# EasyEDA Pro project ProProject_Suzuran_Dev_Board_2023-10-31.epro

# Schematic Schematic1

## Sheets
1 P1: Create Date: 2023-10-07; Company: 嘉立创EDA; Page Size: A4; Version: V1.0
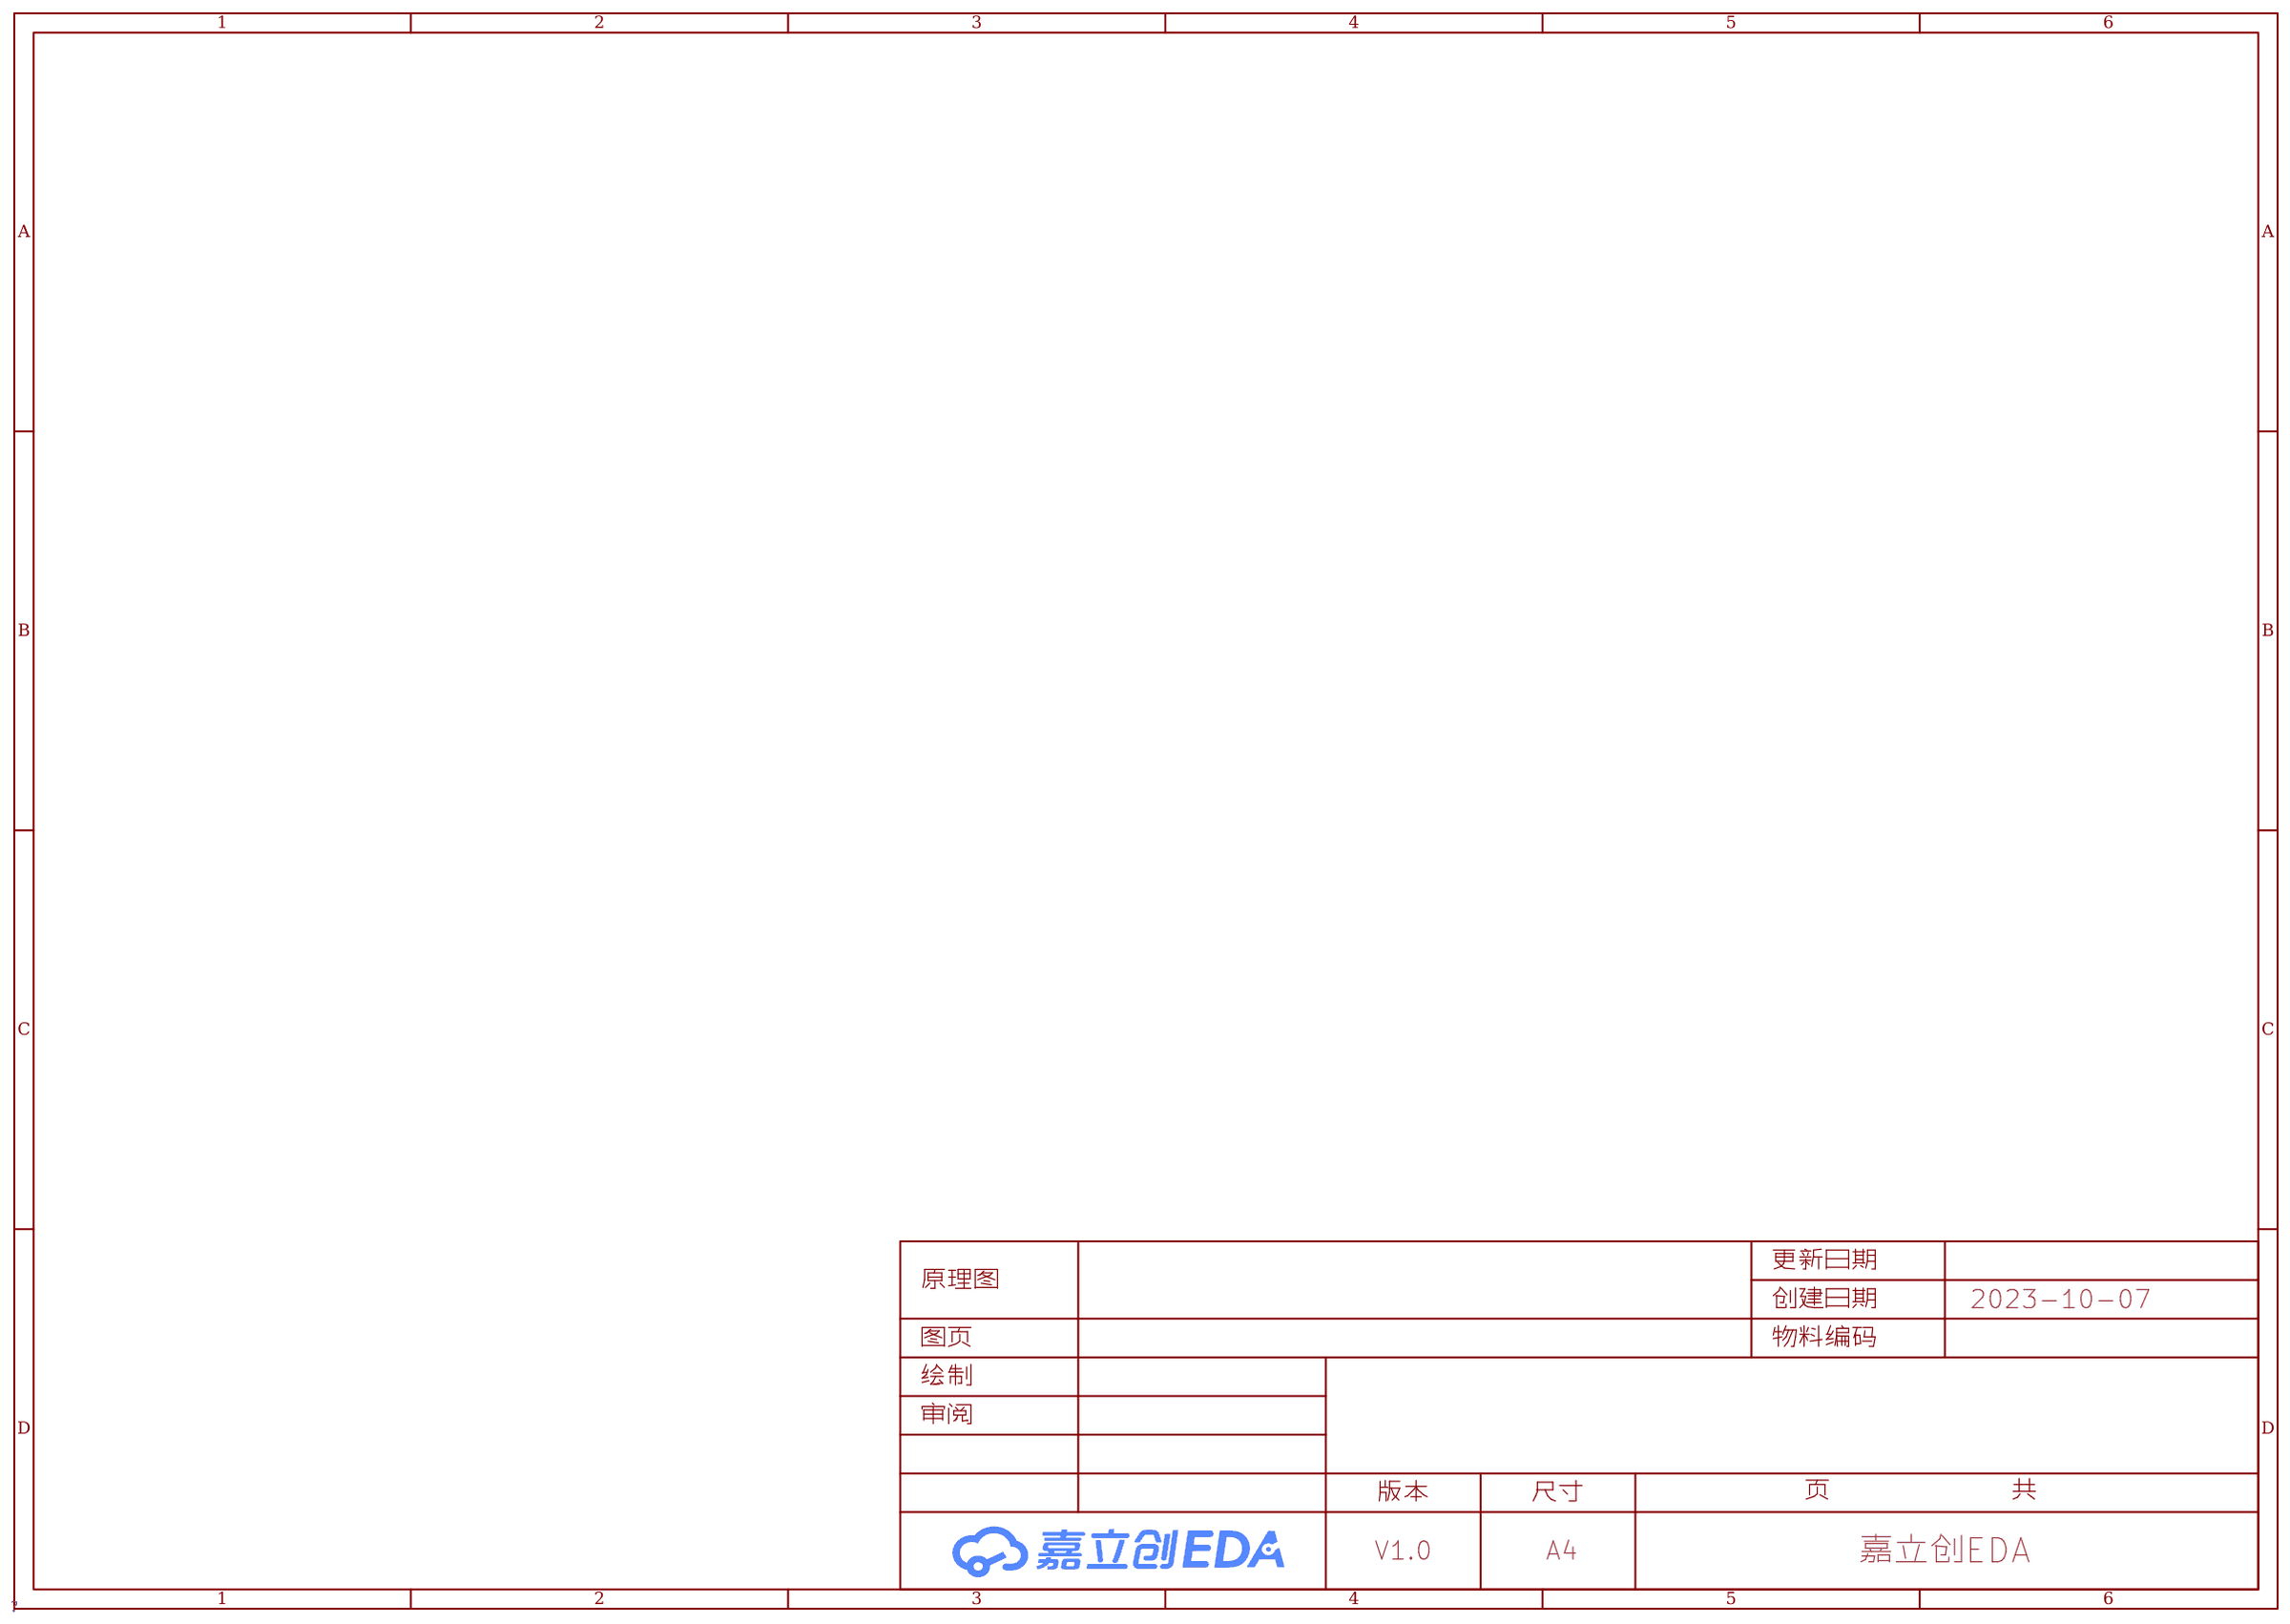
[diagram p0: P1]
2 Sheet.SchDoc
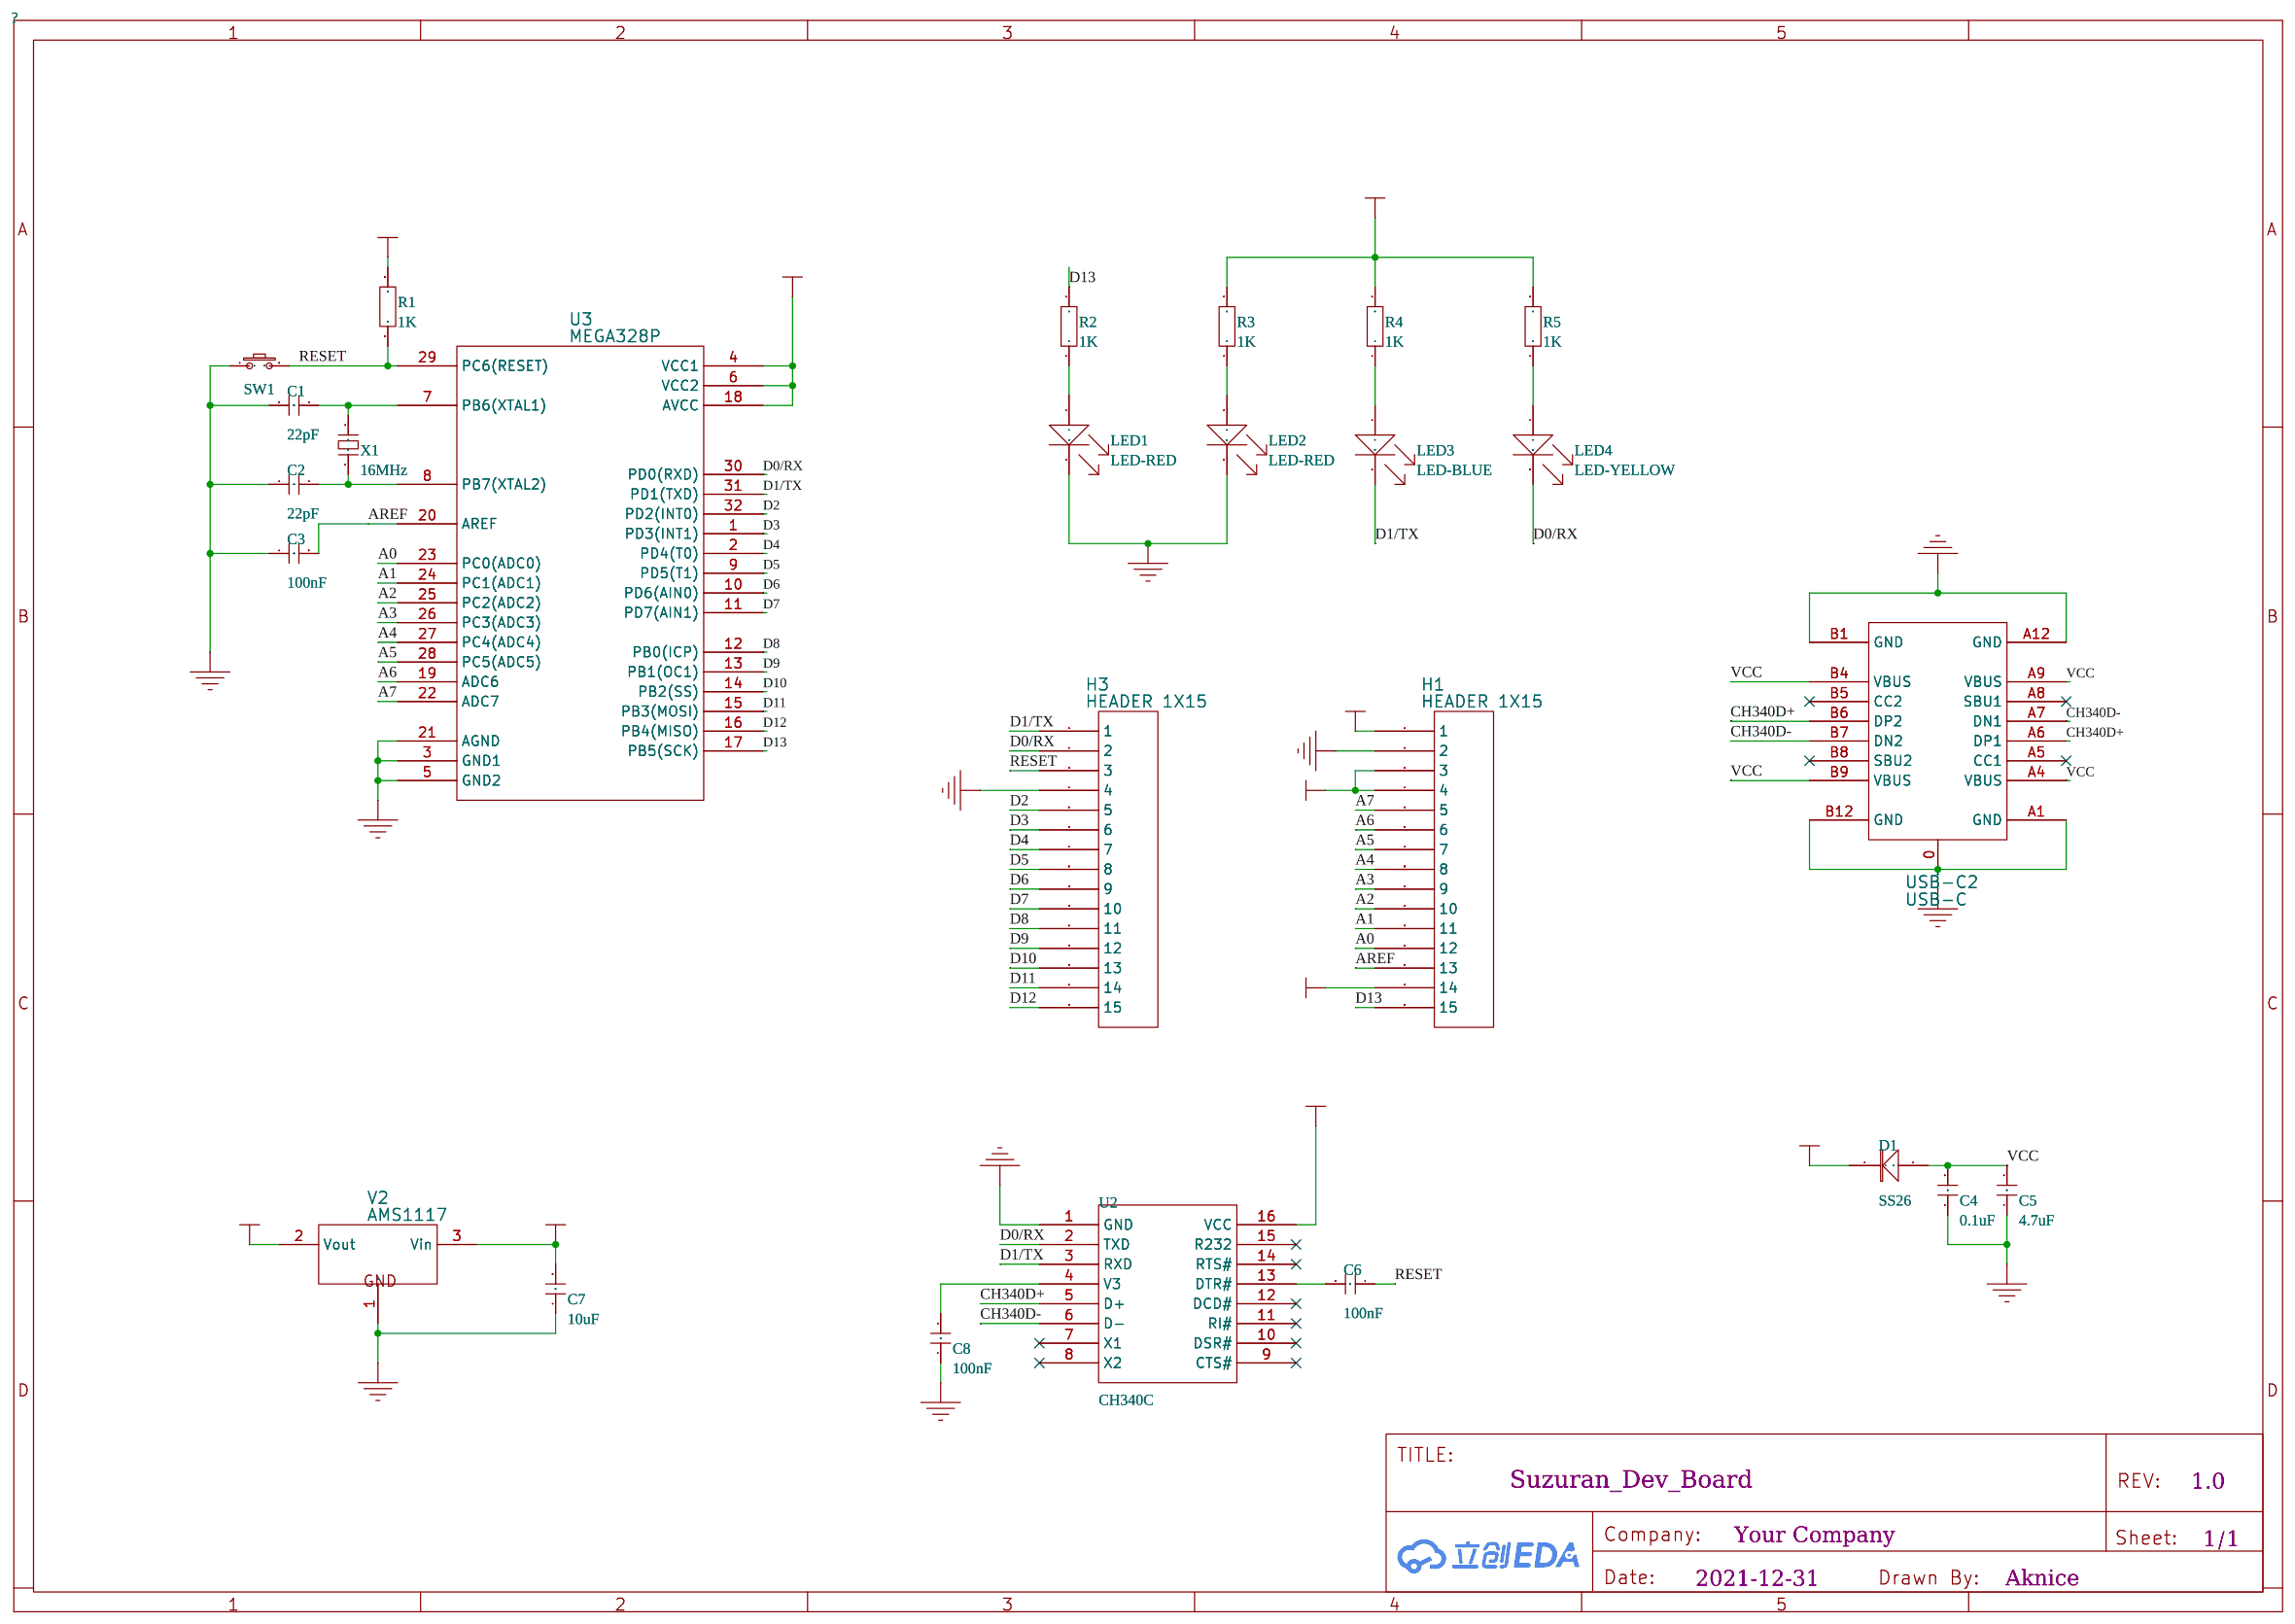
[diagram p1: Sheet.SchDoc]

## Parts
C1  22pF  [C 0603_L]
C2  22pF  [C 0603_L]
C3  100nF  [C 0603_L]
C4  0.1uF  [C 0603_L]
C5  4.7uF  [C 0603_L]
C6  100nF  [C 0603_L]
C7  10uF  [C 1206_L]
C8  100nF  [C 0603_L]
D1  SS26  [SOD-123]
H1  HEADER 1X15  [HDR2.54-LI-15P]
H3  HEADER 1X15  [HDR2.54-LI-15P]
LED1  LED-RED  [LED 0805]
LED2  LED-RED  [LED 0805]
LED3  LED-BLUE  [LED 0805B]
LED4  LED-YELLOW  [LED 0805Y]
R1  1K  [R 0603_L]
R2  1K  [R 0603_L]
R3  1K  [R 0603_L]
R4  1K  [R 0603_L]
R5  1K  [R 0603_L]
SW1  3x6x5  [TSW SMD-3*6*2.5]
U2  CH340C  [SOP16_L]
U3  MEGA328P  [TQFP32-7*7]
USB-C2  USB-C  [TYPE-C-USB-5]
V2  AMS1117  [AMS1117]
X1  16MHz  [OSC 5032-2P]

## Library data of the parts
C1 C2 = 22pF: BOM名称: 无极性贴片电容
C3 C6 C8 = 100nF: BOM名称: 无极性贴片电容
C4 = 0.1uF: BOM名称: 无极性贴片电容
C5 = 4.7uF: BOM名称: 无极性贴片电容
C7 = 10uF: BOM名称: 无极性贴片电容
D1 = SS26: BOM名称: 整流二极管
H1 H3 = HEADER 1X15
LED1 LED2 = LED-RED
LED3 = LED-BLUE
LED4 = LED-YELLOW
R1-R5 = 1K: BOM名称: 贴片电阻
SW1 = 3x6x5: BOM名称: 3x6轻触开关
U2 = CH340C
U3 = MEGA328P
USB-C2 = USB-C
V2 = AMS1117: BOM名称: 稳压芯片
X1 = 16MHz: BOM名称: 2脚无源脚晶振

## Nets
GND: C1.1 C2.1 C3.1 C4.1 C5.1 C7.1 C8.1 H1.2 H3.4 LED1.2 LED2.2 SW1.1 U2.1(GND) U3.3(GND1) U3.5(GND2) U3.21(AGND) USB-C2.A1(GND) USB-C2.A12(GND) USB-C2.B1(GND) USB-C2.B12(GND) V2.1(GND)
VCC: C4.2 C5.2 D1.1(A) USB-C2.A4(VBUS) USB-C2.A9(VBUS) USB-C2.B4(VBUS) USB-C2.B9(VBUS)
VIN: C7.2 H1.1 V2.3(Vin)
+5: D1.2(K) H1.3 H1.4 H1.14 R1.2 R3.2 R4.2 R5.2 U2.16(VCC) U3.4(VCC1) U3.6(VCC2) U3.18(AVCC) V2.2(Vout)
A0: H1.12 U3.23(PC0(ADC0))
A1: H1.11 U3.24(PC1(ADC1))
A2: H1.10 U3.25(PC2(ADC2))
A3: H1.9 U3.26(PC3(ADC3))
A4: H1.8 U3.27(PC4(ADC4))
A5: H1.7 U3.28(PC5(ADC5))
A6: H1.6 U3.19(ADC6)
A7: H1.5 U3.22(ADC7)
AREF: C3.2 H1.13 U3.20(AREF)
CH340D+: U2.5(D+) USB-C2.A6(DP1) USB-C2.B6(DP2)
CH340D-: U2.6(D-) USB-C2.A7(DN1) USB-C2.B7(DN2)
D0/RX: H3.2 LED4.2 U2.2(TXD) U3.30(PD0(RXD))
D1/TX: H3.1 LED3.2 U2.3(RXD) U3.31(PD1(TXD))
D2: H3.5 U3.32(PD2(INT0))
D3: H3.6 U3.1(PD3(INT1))
D4: H3.7 U3.2(PD4(T0))
D5: H3.8 U3.9(PD5(T1))
D6: H3.9 U3.10(PD6(AIN0))
D7: H3.10 U3.11(PD7(AIN1))
D8: H3.11 U3.12(PB0(ICP))
D9: H3.12 U3.13(PB1(OC1))
D10: H3.13 U3.14(PB2(SS))
D11: H3.14 U3.15(PB3(MOSI))
D12: H3.15 U3.16(PB4(MISO))
D13: H1.15 R2.2 U3.17(PB5(SCK))
RESET: C6.1 H3.3 R1.1 SW1.2 U3.29(PC6(RESET))
$2N83: C8.2 U2.4(V3)
$2N99: LED1.1 R2.1
$2N104: LED2.1 R3.1
$2N105: LED3.1 R4.1
$2N106: LED4.1 R5.1
$2N165: C2.2 U3.8(PB7(XTAL2)) X1.1
$2N166: C1.2 U3.7(PB6(XTAL1)) X1.2
$2N207: C6.2 U2.13(DTR#)

Not connected (* = marked no-connect by the designer): U2 7(X1)* 8(X2)* 9(CTS#)* 10(DSR#)* 11(RI#)* 12(DCD#)* 14(RTS#)* 15(R232)*; USB-C2 0 A5(CC1)* A8(SBU1)* B5(CC2)* B8(SBU2)*

# Schematic Schematic1_1

## Sheets
1 P1: Create Date: 2023-10-07; Company: 嘉立创EDA; Page Size: A4; Version: V1.0
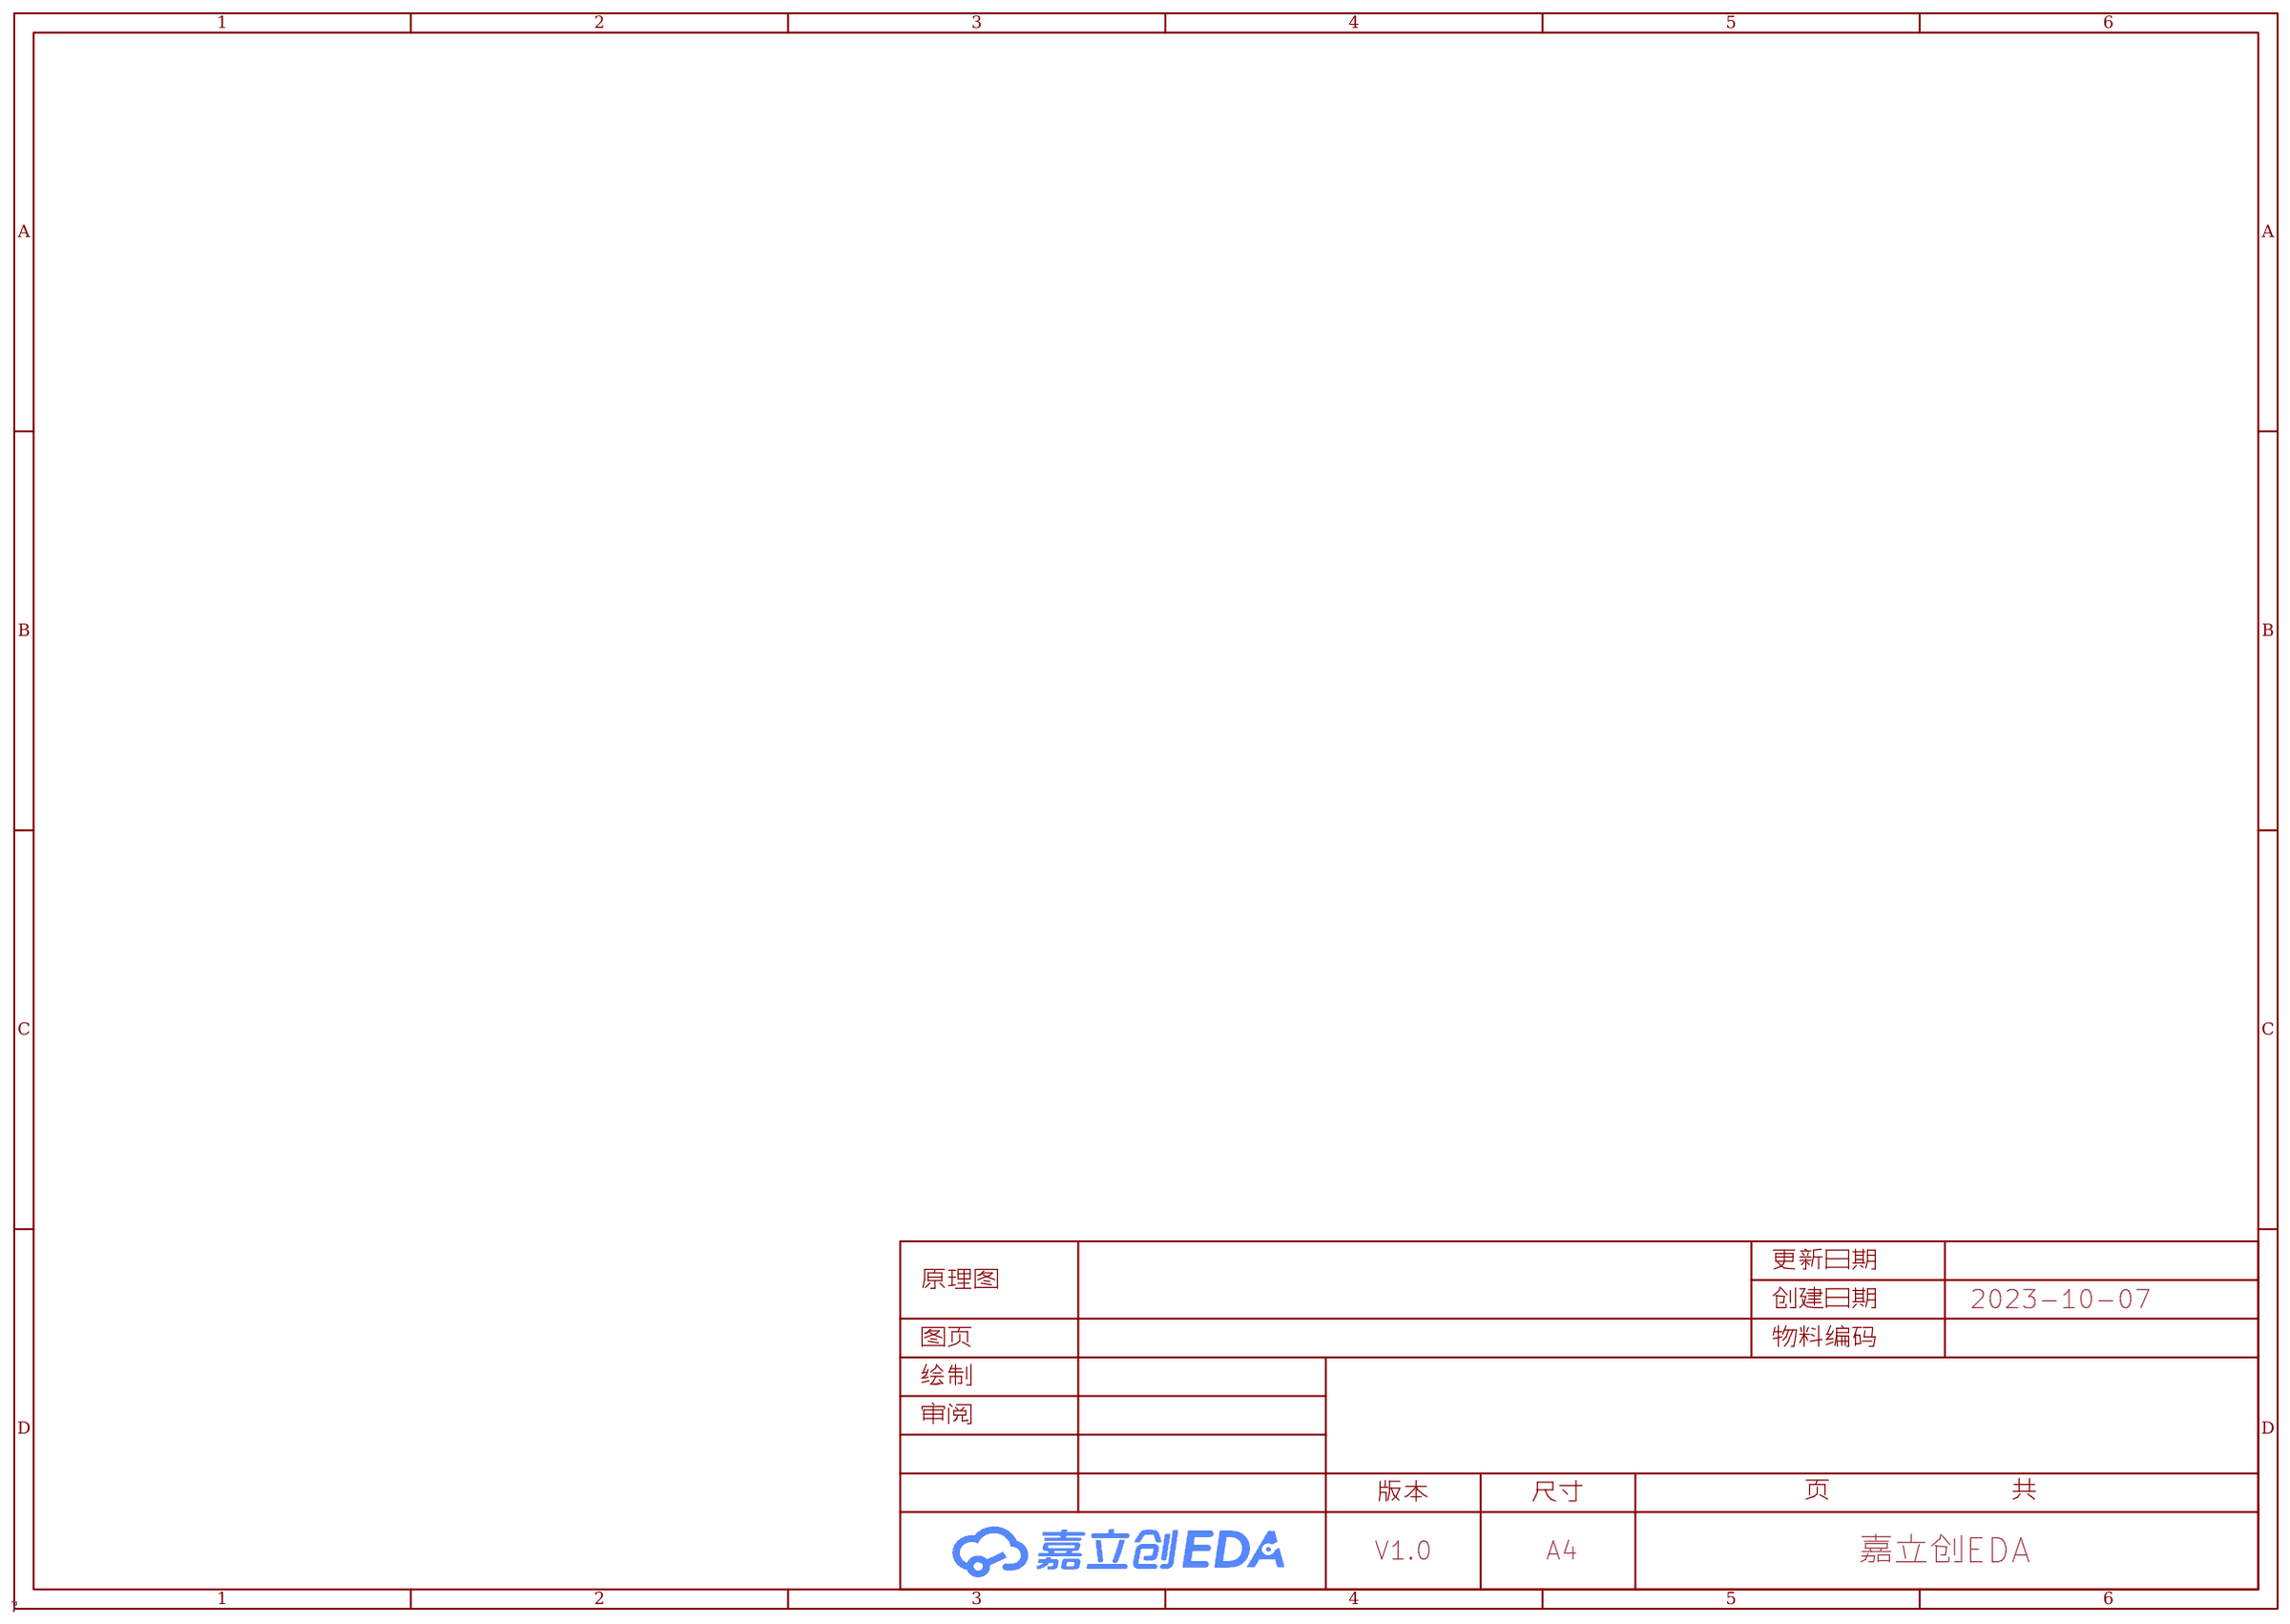
[diagram p2: P1]
2 Sheet.SchDoc
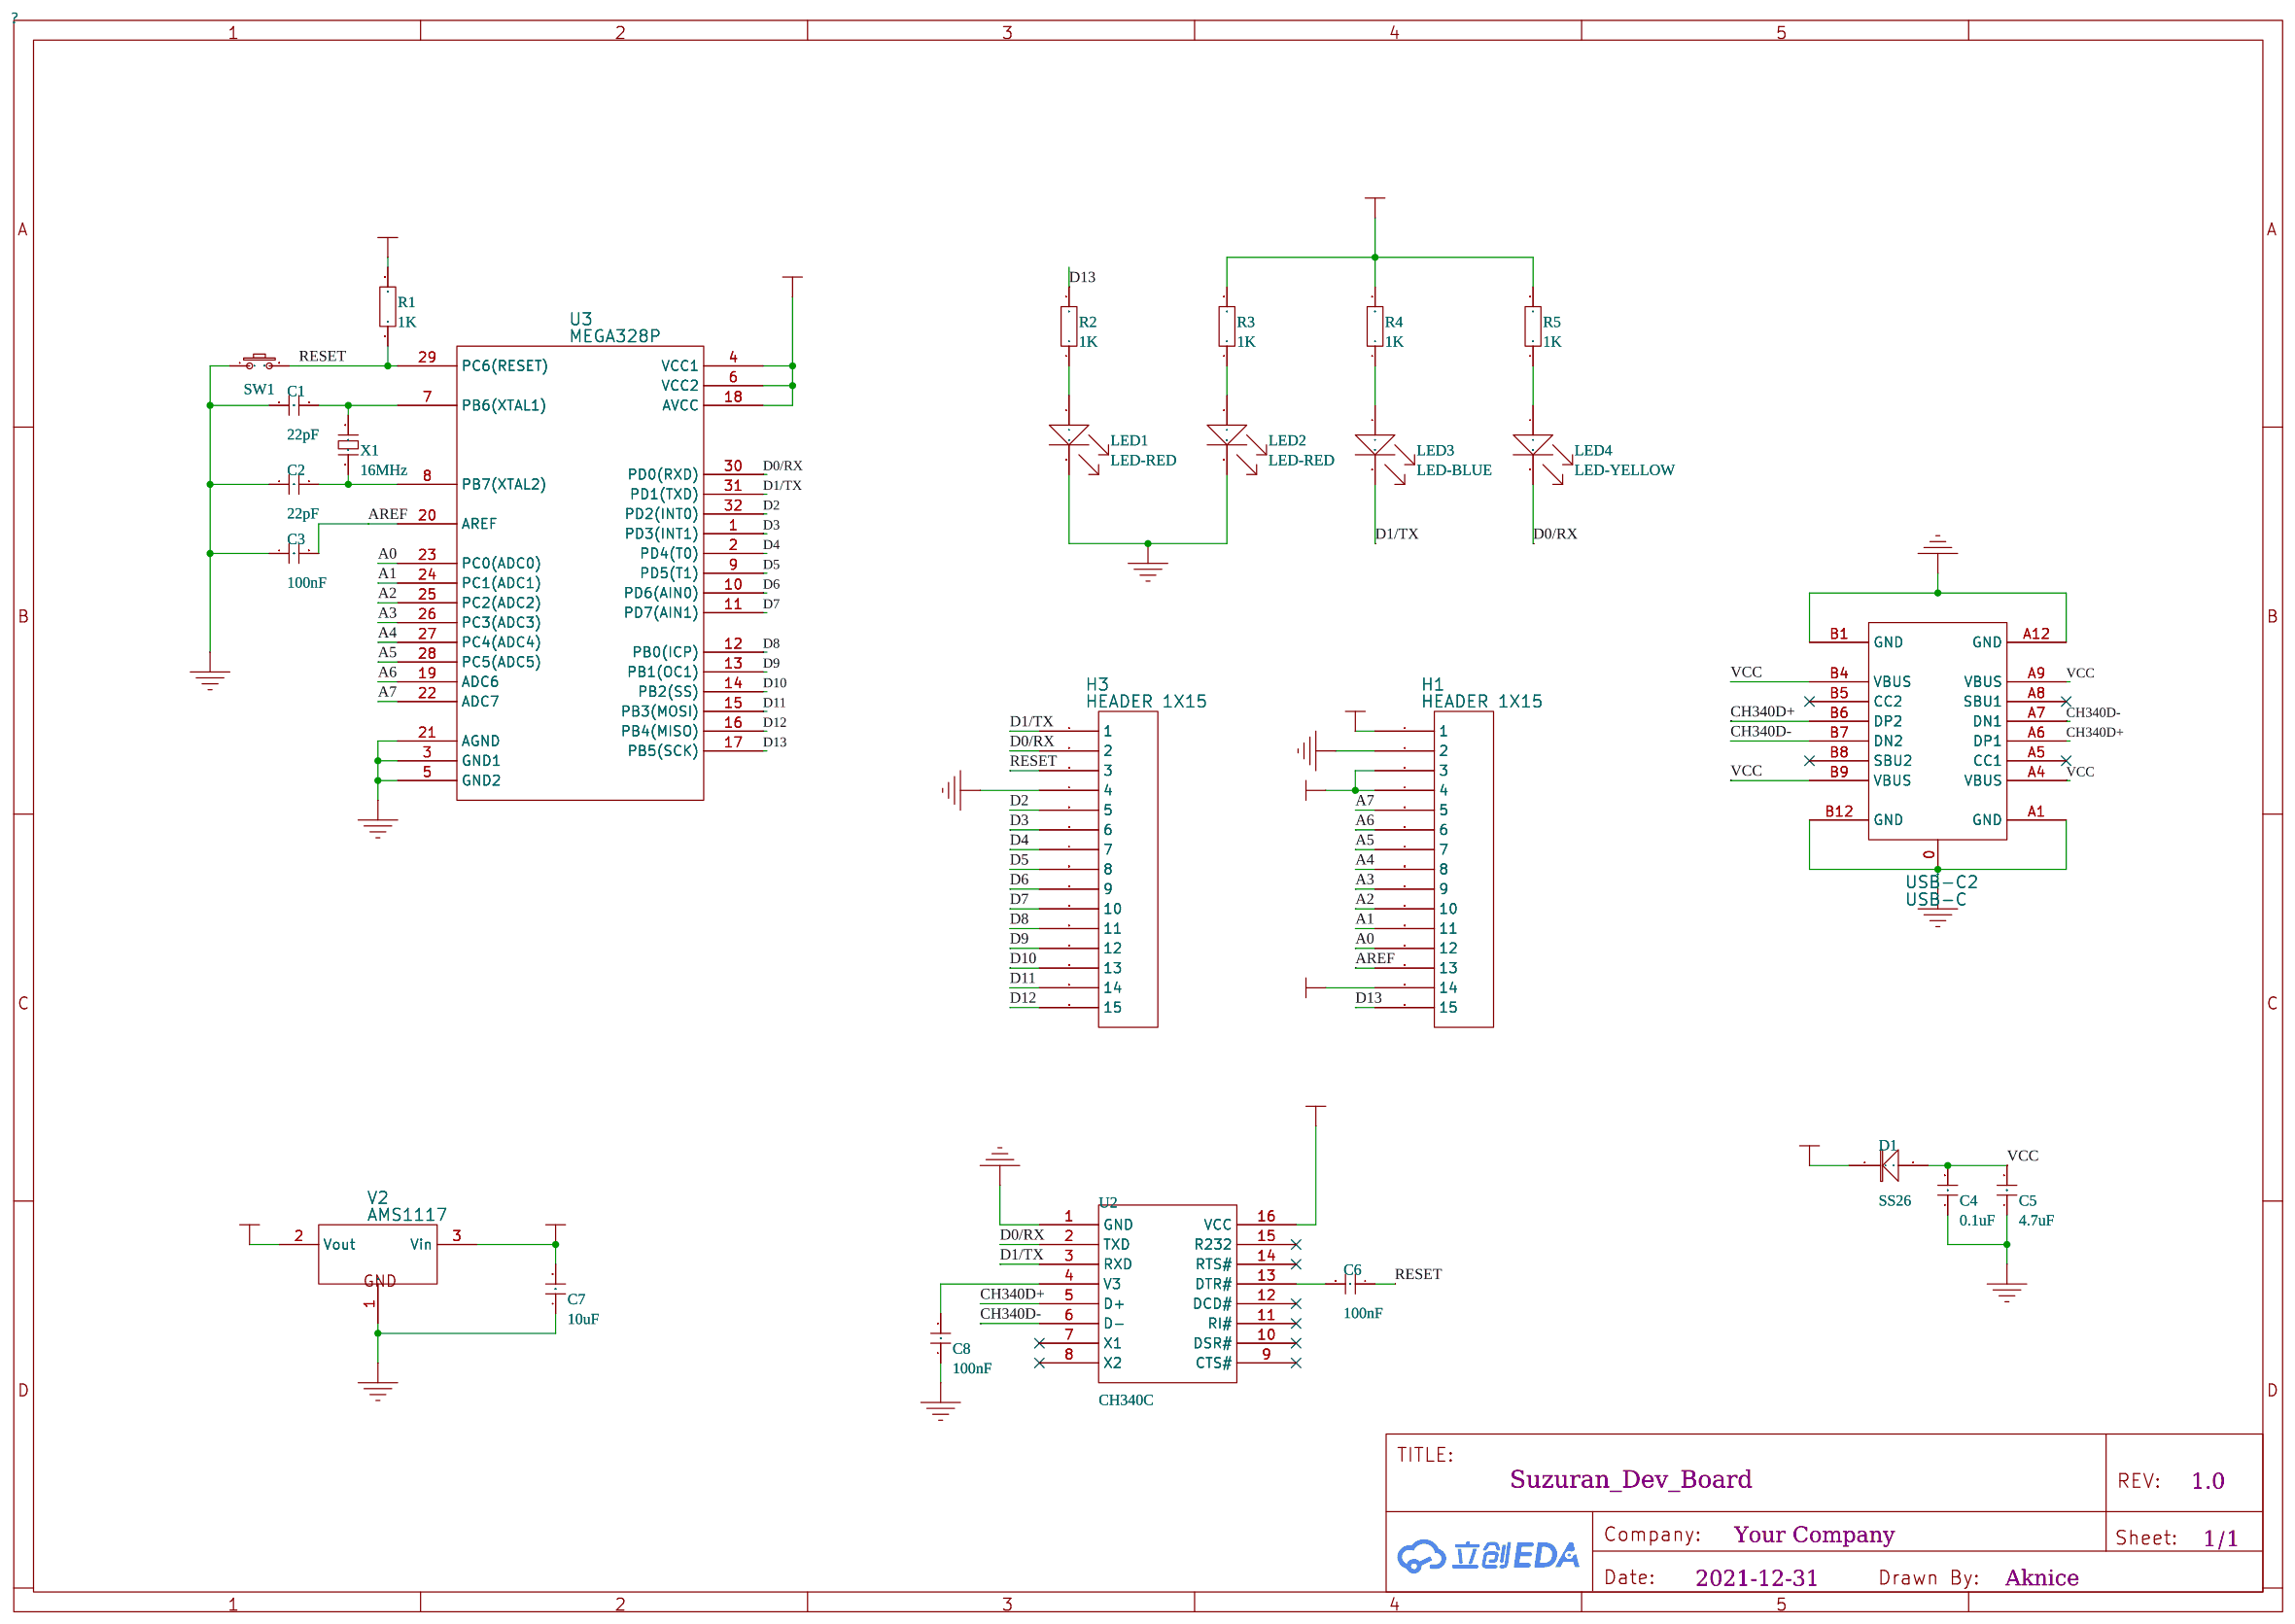
[diagram p3: Sheet.SchDoc]

## Parts
C1  22pF  [C 0603_L]
C2  22pF  [C 0603_L]
C3  100nF  [C 0603_L]
C4  0.1uF  [C 0603_L]
C5  4.7uF  [C 0603_L]
C6  100nF  [C 0603_L]
C7  10uF  [C 1206_L]
C8  100nF  [C 0603_L]
D1  SS26  [SOD-123]
H1  HEADER 1X15  [HDR2.54-LI-15P]
H3  HEADER 1X15  [HDR2.54-LI-15P]
LED1  LED-RED  [LED 0805]
LED2  LED-RED  [LED 0805]
LED3  LED-BLUE  [LED 0805B]
LED4  LED-YELLOW  [LED 0805Y]
R1  1K  [R 0603_L]
R2  1K  [R 0603_L]
R3  1K  [R 0603_L]
R4  1K  [R 0603_L]
R5  1K  [R 0603_L]
SW1  3x6x5  [TSW SMD-3*6*2.5]
U2  CH340C  [SOP16_L]
U3  MEGA328P  [TQFP32-7*7]
USB-C2  USB-C  [TYPE-C-USB-5]
V2  AMS1117  [AMS1117]
X1  16MHz  [OSC 5032-2P]

## Library data of the parts
C1 C2 = 22pF: BOM名称: 无极性贴片电容
C3 C6 C8 = 100nF: BOM名称: 无极性贴片电容
C4 = 0.1uF: BOM名称: 无极性贴片电容
C5 = 4.7uF: BOM名称: 无极性贴片电容
C7 = 10uF: BOM名称: 无极性贴片电容
D1 = SS26: BOM名称: 整流二极管
H1 H3 = HEADER 1X15
LED1 LED2 = LED-RED
LED3 = LED-BLUE
LED4 = LED-YELLOW
R1-R5 = 1K: BOM名称: 贴片电阻
SW1 = 3x6x5: BOM名称: 3x6轻触开关
U2 = CH340C
U3 = MEGA328P
USB-C2 = USB-C
V2 = AMS1117: BOM名称: 稳压芯片
X1 = 16MHz: BOM名称: 2脚无源脚晶振

## Nets
GND: C1.1 C2.1 C3.1 C4.1 C5.1 C7.1 C8.1 H1.2 H3.4 LED1.2 LED2.2 SW1.1 U2.1(GND) U3.3(GND1) U3.5(GND2) U3.21(AGND) USB-C2.A1(GND) USB-C2.A12(GND) USB-C2.B1(GND) USB-C2.B12(GND) V2.1(GND)
VCC: C4.2 C5.2 D1.1(A) USB-C2.A4(VBUS) USB-C2.A9(VBUS) USB-C2.B4(VBUS) USB-C2.B9(VBUS)
VIN: C7.2 H1.1 V2.3(Vin)
+5: D1.2(K) H1.3 H1.4 H1.14 R1.2 R3.2 R4.2 R5.2 U2.16(VCC) U3.4(VCC1) U3.6(VCC2) U3.18(AVCC) V2.2(Vout)
A0: H1.12 U3.23(PC0(ADC0))
A1: H1.11 U3.24(PC1(ADC1))
A2: H1.10 U3.25(PC2(ADC2))
A3: H1.9 U3.26(PC3(ADC3))
A4: H1.8 U3.27(PC4(ADC4))
A5: H1.7 U3.28(PC5(ADC5))
A6: H1.6 U3.19(ADC6)
A7: H1.5 U3.22(ADC7)
AREF: C3.2 H1.13 U3.20(AREF)
CH340D+: U2.5(D+) USB-C2.A6(DP1) USB-C2.B6(DP2)
CH340D-: U2.6(D-) USB-C2.A7(DN1) USB-C2.B7(DN2)
D0/RX: H3.2 LED4.2 U2.2(TXD) U3.30(PD0(RXD))
D1/TX: H3.1 LED3.2 U2.3(RXD) U3.31(PD1(TXD))
D2: H3.5 U3.32(PD2(INT0))
D3: H3.6 U3.1(PD3(INT1))
D4: H3.7 U3.2(PD4(T0))
D5: H3.8 U3.9(PD5(T1))
D6: H3.9 U3.10(PD6(AIN0))
D7: H3.10 U3.11(PD7(AIN1))
D8: H3.11 U3.12(PB0(ICP))
D9: H3.12 U3.13(PB1(OC1))
D10: H3.13 U3.14(PB2(SS))
D11: H3.14 U3.15(PB3(MOSI))
D12: H3.15 U3.16(PB4(MISO))
D13: H1.15 R2.2 U3.17(PB5(SCK))
RESET: C6.1 H3.3 R1.1 SW1.2 U3.29(PC6(RESET))
$2N83: C8.2 U2.4(V3)
$2N99: LED1.1 R2.1
$2N104: LED2.1 R3.1
$2N105: LED3.1 R4.1
$2N106: LED4.1 R5.1
$2N165: C2.2 U3.8(PB7(XTAL2)) X1.1
$2N166: C1.2 U3.7(PB6(XTAL1)) X1.2
$2N207: C6.2 U2.13(DTR#)

Not connected (* = marked no-connect by the designer): U2 7(X1)* 8(X2)* 9(CTS#)* 10(DSR#)* 11(RI#)* 12(DCD#)* 14(RTS#)* 15(R232)*; USB-C2 0 A5(CC1)* A8(SBU1)* B5(CC2)* B8(SBU2)*

# Schematic Schematic1_2

## Sheets
1 P1: Create Date: 2023-10-07; Company: 嘉立创EDA; Page Size: A4; Version: V1.0
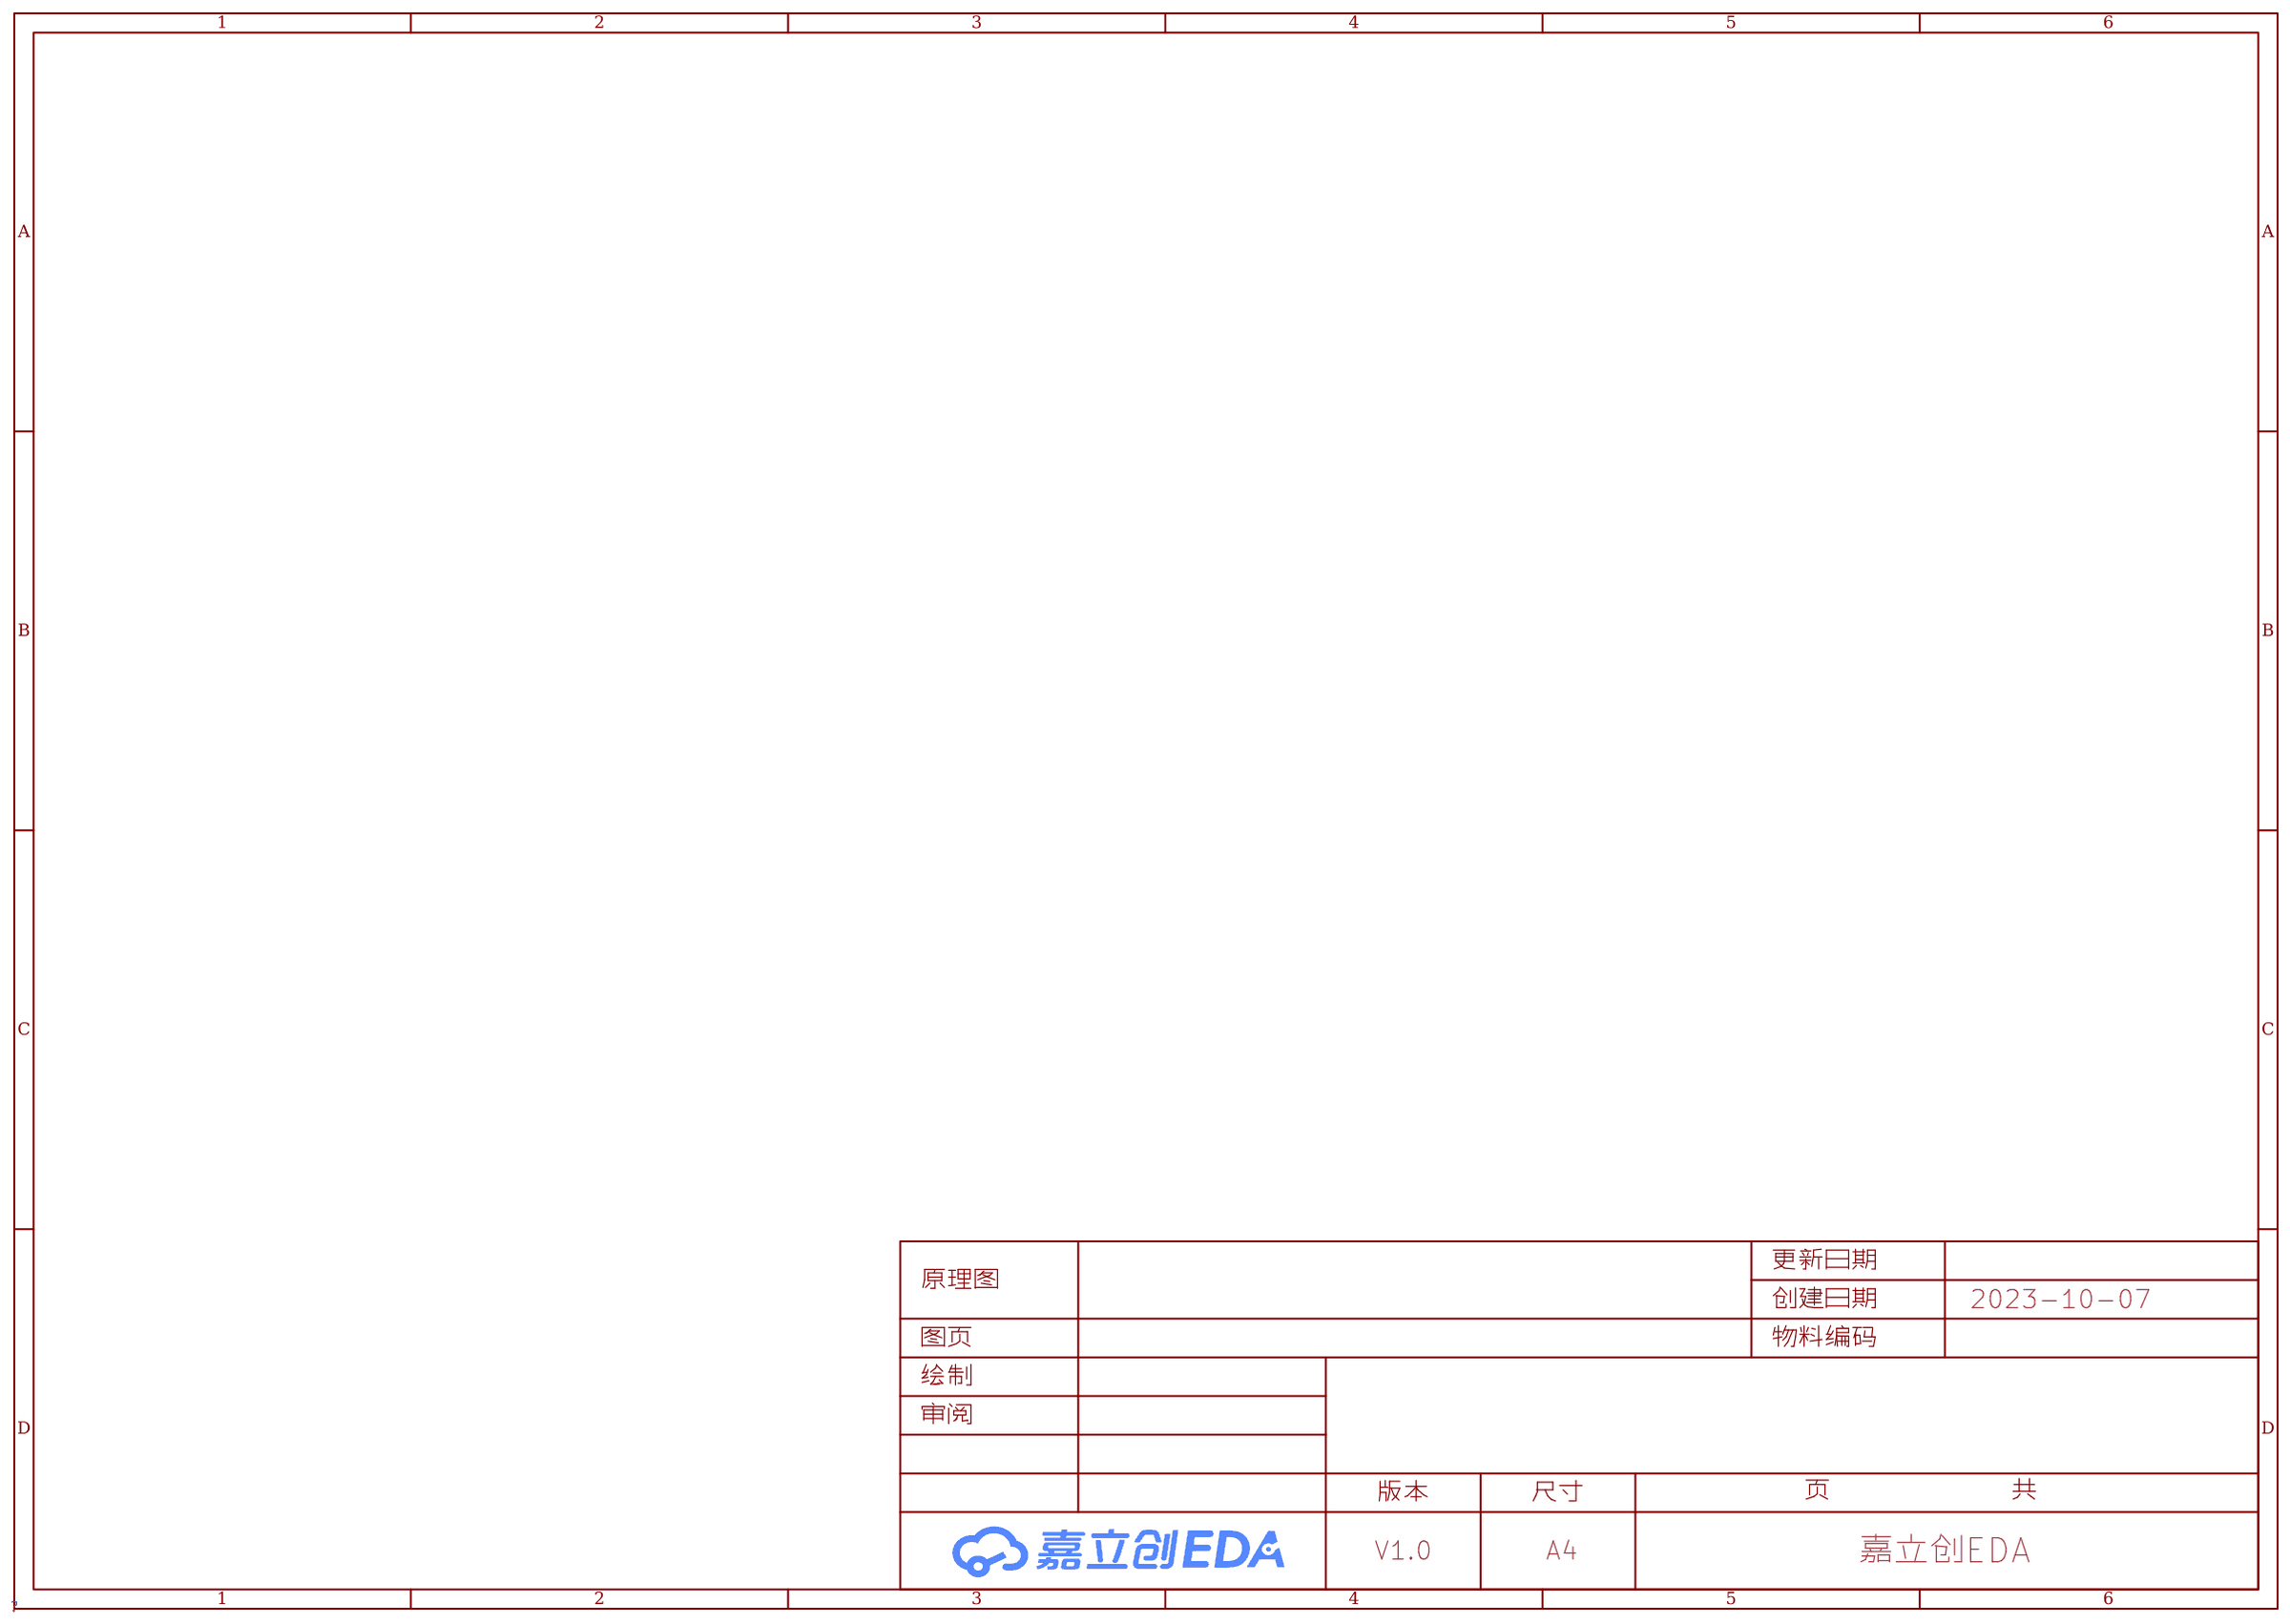
[diagram p4: P1]
2 Sheet.SchDoc
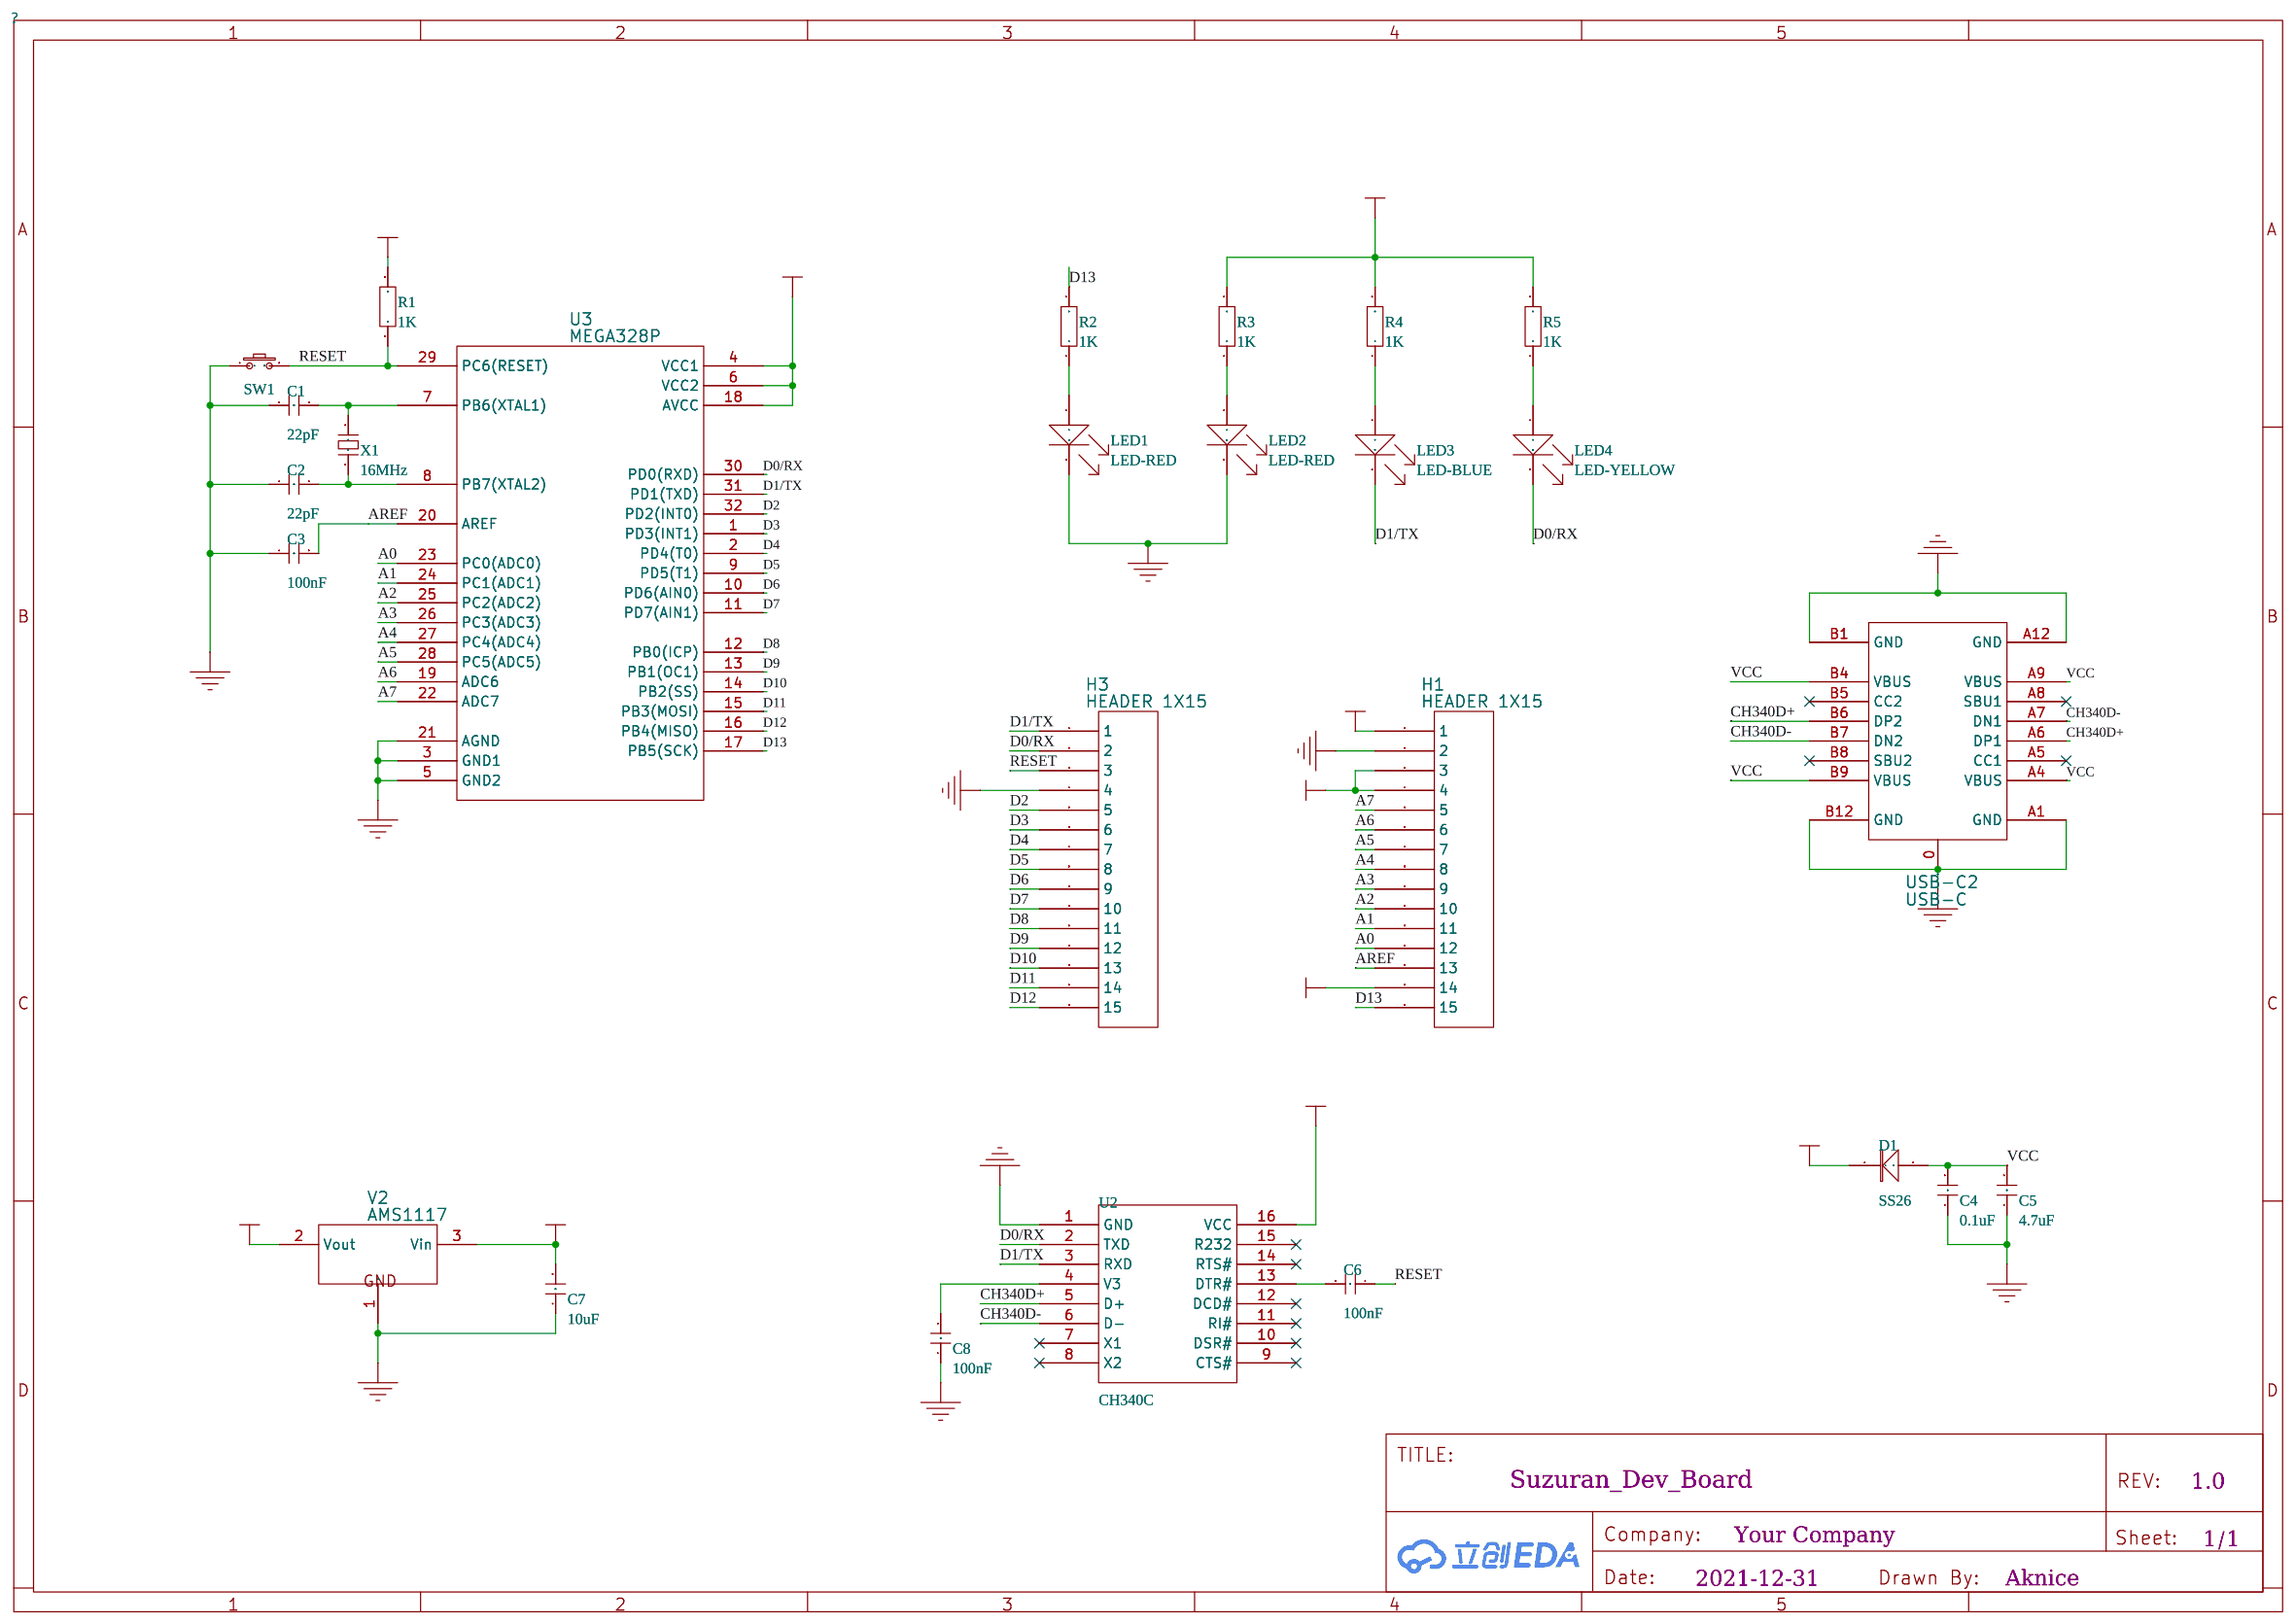
[diagram p5: Sheet.SchDoc]

## Parts
C1  22pF  [C 0603_L]
C2  22pF  [C 0603_L]
C3  100nF  [C 0603_L]
C4  0.1uF  [C 0603_L]
C5  4.7uF  [C 0603_L]
C6  100nF  [C 0603_L]
C7  10uF  [C 1206_L]
C8  100nF  [C 0603_L]
D1  SS26  [SOD-123]
H1  HEADER 1X15  [HDR2.54-LI-15P]
H3  HEADER 1X15  [HDR2.54-LI-15P]
LED1  LED-RED  [LED 0805]
LED2  LED-RED  [LED 0805]
LED3  LED-BLUE  [LED 0805B]
LED4  LED-YELLOW  [LED 0805Y]
R1  1K  [R 0603_L]
R2  1K  [R 0603_L]
R3  1K  [R 0603_L]
R4  1K  [R 0603_L]
R5  1K  [R 0603_L]
SW1  3x6x5  [TSW SMD-3*6*2.5]
U2  CH340C  [SOP16_L]
U3  MEGA328P  [TQFP32-7*7]
USB-C2  USB-C  [TYPE-C-USB-5]
V2  AMS1117  [AMS1117]
X1  16MHz  [OSC 5032-2P]

## Library data of the parts
C1 C2 = 22pF: BOM名称: 无极性贴片电容
C3 C6 C8 = 100nF: BOM名称: 无极性贴片电容
C4 = 0.1uF: BOM名称: 无极性贴片电容
C5 = 4.7uF: BOM名称: 无极性贴片电容
C7 = 10uF: BOM名称: 无极性贴片电容
D1 = SS26: BOM名称: 整流二极管
H1 H3 = HEADER 1X15
LED1 LED2 = LED-RED
LED3 = LED-BLUE
LED4 = LED-YELLOW
R1-R5 = 1K: BOM名称: 贴片电阻
SW1 = 3x6x5: BOM名称: 3x6轻触开关
U2 = CH340C
U3 = MEGA328P
USB-C2 = USB-C
V2 = AMS1117: BOM名称: 稳压芯片
X1 = 16MHz: BOM名称: 2脚无源脚晶振

## Nets
GND: C1.1 C2.1 C3.1 C4.1 C5.1 C7.1 C8.1 H1.2 H3.4 LED1.2 LED2.2 SW1.1 U2.1(GND) U3.3(GND1) U3.5(GND2) U3.21(AGND) USB-C2.A1(GND) USB-C2.A12(GND) USB-C2.B1(GND) USB-C2.B12(GND) V2.1(GND)
VCC: C4.2 C5.2 D1.1(A) USB-C2.A4(VBUS) USB-C2.A9(VBUS) USB-C2.B4(VBUS) USB-C2.B9(VBUS)
VIN: C7.2 H1.1 V2.3(Vin)
+5: D1.2(K) H1.3 H1.4 H1.14 R1.2 R3.2 R4.2 R5.2 U2.16(VCC) U3.4(VCC1) U3.6(VCC2) U3.18(AVCC) V2.2(Vout)
A0: H1.12 U3.23(PC0(ADC0))
A1: H1.11 U3.24(PC1(ADC1))
A2: H1.10 U3.25(PC2(ADC2))
A3: H1.9 U3.26(PC3(ADC3))
A4: H1.8 U3.27(PC4(ADC4))
A5: H1.7 U3.28(PC5(ADC5))
A6: H1.6 U3.19(ADC6)
A7: H1.5 U3.22(ADC7)
AREF: C3.2 H1.13 U3.20(AREF)
CH340D+: U2.5(D+) USB-C2.A6(DP1) USB-C2.B6(DP2)
CH340D-: U2.6(D-) USB-C2.A7(DN1) USB-C2.B7(DN2)
D0/RX: H3.2 LED4.2 U2.2(TXD) U3.30(PD0(RXD))
D1/TX: H3.1 LED3.2 U2.3(RXD) U3.31(PD1(TXD))
D2: H3.5 U3.32(PD2(INT0))
D3: H3.6 U3.1(PD3(INT1))
D4: H3.7 U3.2(PD4(T0))
D5: H3.8 U3.9(PD5(T1))
D6: H3.9 U3.10(PD6(AIN0))
D7: H3.10 U3.11(PD7(AIN1))
D8: H3.11 U3.12(PB0(ICP))
D9: H3.12 U3.13(PB1(OC1))
D10: H3.13 U3.14(PB2(SS))
D11: H3.14 U3.15(PB3(MOSI))
D12: H3.15 U3.16(PB4(MISO))
D13: H1.15 R2.2 U3.17(PB5(SCK))
RESET: C6.1 H3.3 R1.1 SW1.2 U3.29(PC6(RESET))
$2N83: C8.2 U2.4(V3)
$2N99: LED1.1 R2.1
$2N104: LED2.1 R3.1
$2N105: LED3.1 R4.1
$2N106: LED4.1 R5.1
$2N165: C2.2 U3.8(PB7(XTAL2)) X1.1
$2N166: C1.2 U3.7(PB6(XTAL1)) X1.2
$2N207: C6.2 U2.13(DTR#)

Not connected (* = marked no-connect by the designer): U2 7(X1)* 8(X2)* 9(CTS#)* 10(DSR#)* 11(RI#)* 12(DCD#)* 14(RTS#)* 15(R232)*; USB-C2 0 A5(CC1)* A8(SBU1)* B5(CC2)* B8(SBU2)*

# Board PCB4
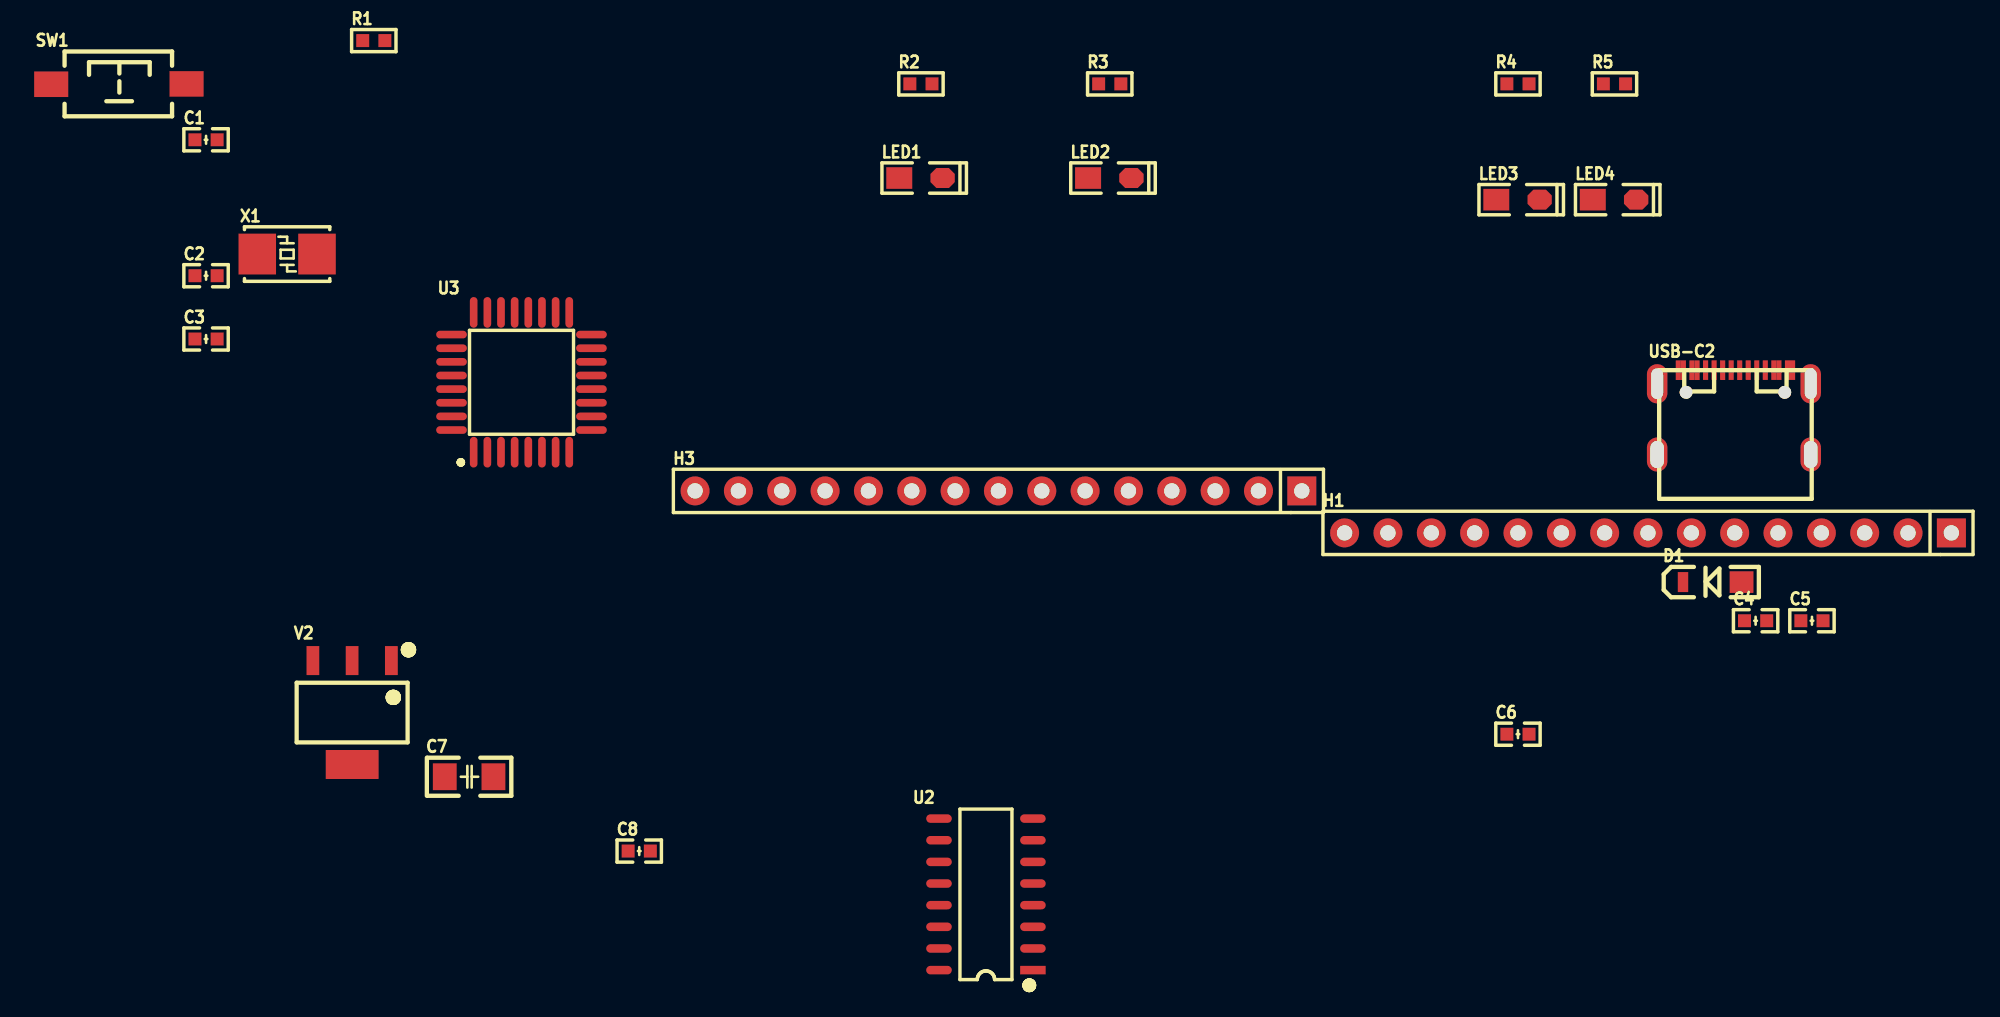
[diagram p6: board, top side]
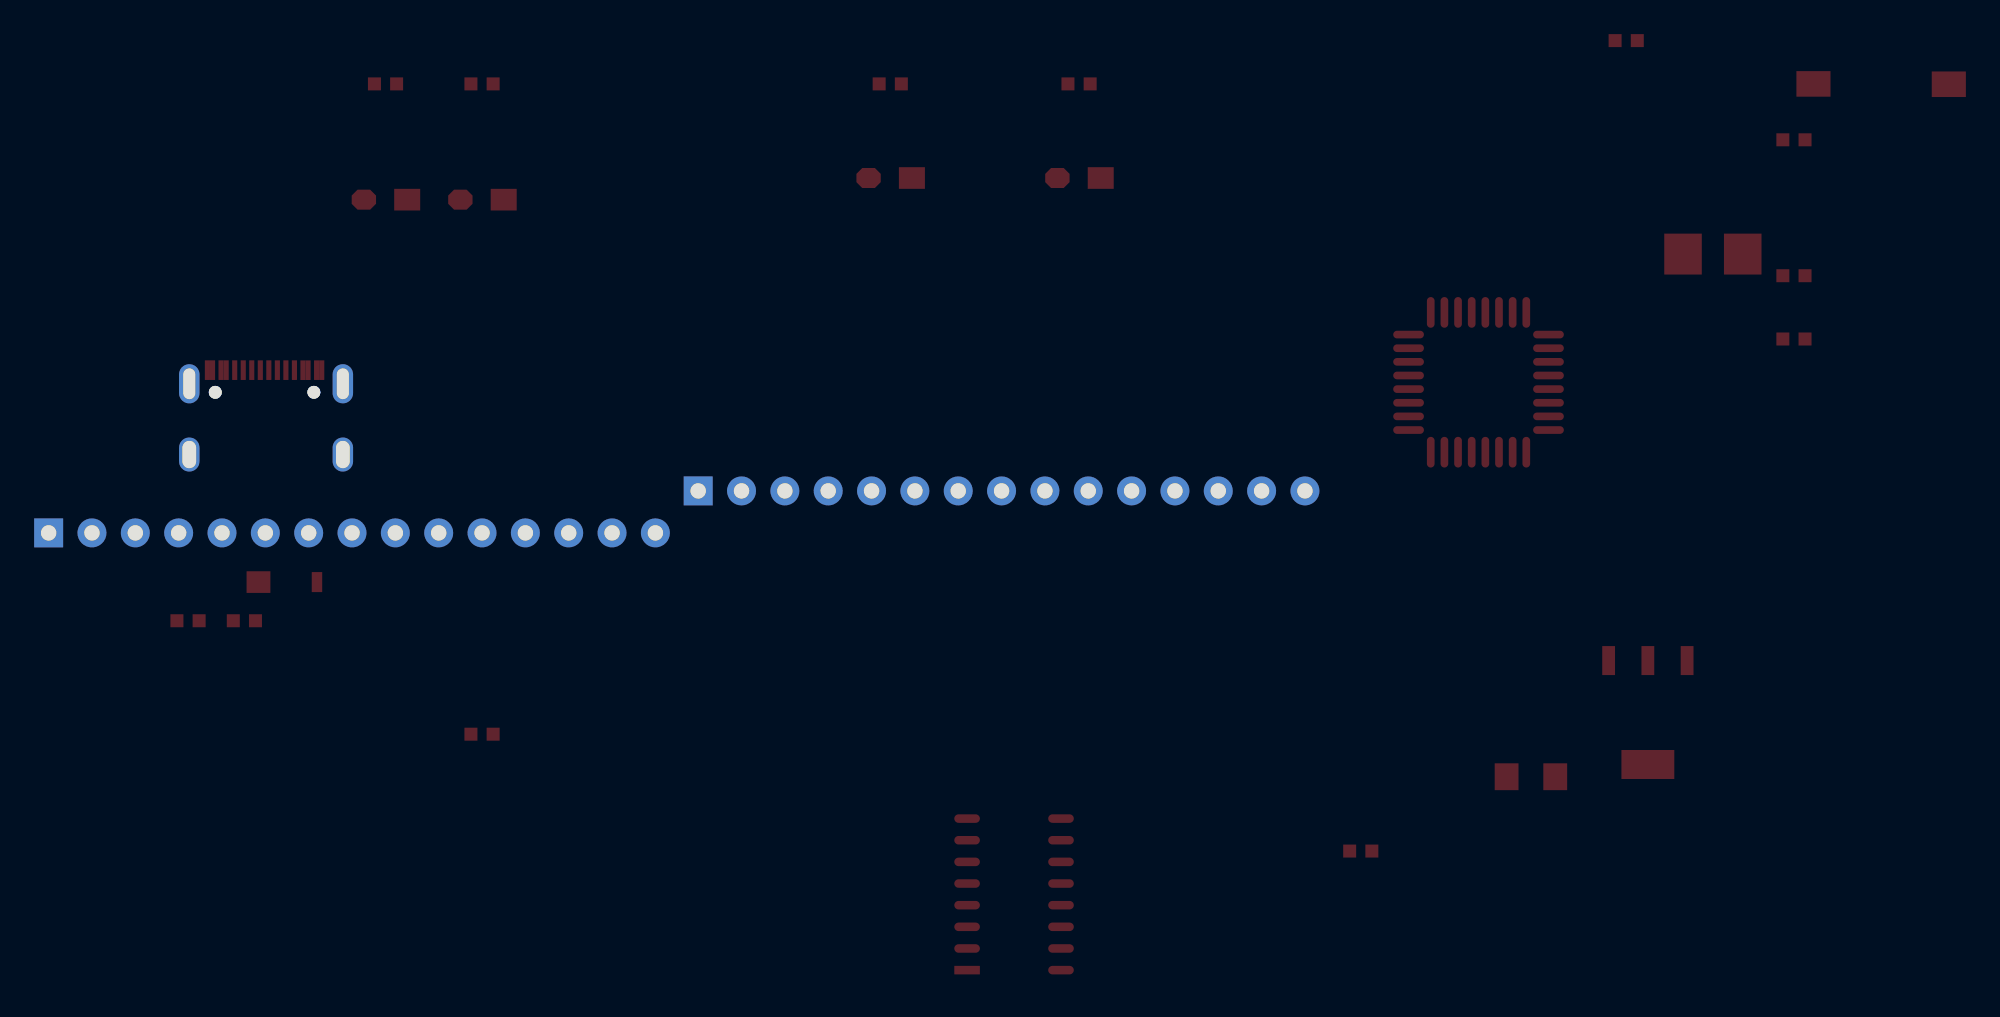
[diagram p7: board, bottom side, seen from below]

No outline. copper layers: Top Layer, Bottom Layer. Coordinates in mm from the lowest, leftmost part position.
Stack: Top Layer 0.035mm / Dielectric1 1.51mm FR4 er 4.5 / Bottom Layer 0.035mm

## Design rules (mm)
template: JLCPCB Capability(Two Layers Board)
spacing copperThickness1oz (default): track to track 0.102, other pairs 0.152 to 0.3
spacing copperThickness2oz: track to track 0.203, other pairs 0.152 to 0.3
track width copperThickness1oz (default): min 0.127, default 0.254, max 2.54
track width copperThickness2oz: min 0.203, default 0.254, max 2.54
differential pair differentialPair (default): width min 0.127, default 0.254, max 2.54; gap min 0.152, default 0.152
via viaSize (default): diameter min 0.5, default 0.61, max 10; hole min 0.3, default 0.305, max 6.3

## Placement (name value [footprint] x y rotation side)
C1  22pF  [C 0603_L]  5.08 44.26 0 top
C2  22pF  [C 0603_L]  5.08 36.29 0 top
C3  100nF  [C 0603_L]  5.08 32.58 0 top
C4  0.1uF  [C 0603_L]  95.89 16.05 0 top
C5  4.7uF  [C 0603_L]  99.2 16.05 0 top
C6  100nF  [C 0603_L]  81.97 9.4 0 top
C7  10uF  [C 1206_L]  20.52 6.9 0 top
C8  100nF  [C 0603_L]  30.47 2.54 0 top
D1  SS26  [SOD-123]  93.35 18.32 0 top
H1  HEADER 1X15  [HDR2.54-LI-15P]  89.59 21.2 0 top
H3  HEADER 1X15  [HDR2.54-LI-15P]  51.52 23.67 0 top
LED1  LED-RED  [LED 0805]  46.98 42.02 0 top
LED2  LED-RED  [LED 0805]  58.04 42.02 0 top
LED3  LED-BLUE  [LED 0805B]  81.97 40.75 0 top
LED4  LED-YELLOW  [LED 0805Y]  87.62 40.75 0 top
R1  1K  [R 0603_L#2]  14.91 50.08 0 top
R2  1K  [R 0603_L]  46.98 47.54 0 top
R3  1K  [R 0603_L]  58.04 47.54 0 top
R4  1K  [R 0603_L]  81.97 47.54 0 top
R5  1K  [R 0603_L]  87.62 47.54 0 top
SW1  3x6x5  [TSW SMD-3*6*2.5]  0 47.54 0 top
U2  CH340C  [SOP16_L]  50.79 0 0 top
U3  MEGA328P  [TQFP32-7*7]  23.57 30.04 0 top
USB-C2  USB-C  [TYPE-C-USB-5]  94.62 28.28 0 top
V2  -  [AMS1117]  13.64 10.67 0 top
X1  16MHz  [OSC 5032-2P]  9.83 37.56 0 top

## Footprints (pads in the part's own frame, mm; a bottom-side part is the same pattern mirrored in y, then rotated)
AMS1117
  rect 0.75x1.7 smd: 1(2.3,3.048) 2(0,3.048) 3(-2.3,3.048)
  rect 3.1x1.7 smd: 4(0,-3.048)
C 0603_L
  rect 0.762x0.762 smd: 1(0.65,0) 2(-0.65,0)
C 1206_L
  rect 1.397x1.575 smd: 1(1.4,0) 2(-1.45,0)
HDR2.54-LI-15P
  rect 1.7x1.7 hole 0.9: 1(17.78,0)
  round 1.7 hole 0.9: 2(15.24,0) 3(12.7,0) 4(10.16,0) 5(7.62,0) 6(5.08,0) 7(2.54,0) 8(0,0) 9(-2.54,0) 10(-5.08,0) 11(-7.62,0) 12(-10.16,0) 13(-12.7,0) 14(-15.24,0) 15(-17.78,0)
LED 0805
  rect 1.524x1.27 smd: 1(-1.27,0)
  custom 1.427x1.173 smd: 2(1.27,0)
LED 0805B
  rect 1.524x1.27 smd: 1(-1.27,0)
  custom 1.427x1.173 smd: 2(1.27,0)
LED 0805Y
  rect 1.524x1.27 smd: 1(-1.27,0)
  custom 1.427x1.173 smd: 2(1.27,0)
OSC 5032-2P
  rect 2.2x2.4 smd: 1(1.75,0) 2(-1.75,0)
R 0603_L
  rect 0.762x0.762 smd: 1(-0.65,0) 2(0.65,0)
R 0603_L#2
  rect 0.762x0.762 smd: 1(0.65,0) 2(-0.65,0)
SOD-123
  rect 1.397x1.27 smd: 1(1.714,0)
  custom 0.613x1.173 smd: 2(-1.714,0)
SOP16_L
  rect 1.5x0.5 smd: 1(2.752,-4.445)
  oval 1.5x0.5 smd: 2(2.752,-3.175) 3(2.752,-1.905) 4(2.752,-0.635) 5(2.752,0.635) 6(2.752,1.905) 7(2.752,3.175) 8(2.752,4.445) 9(-2.752,4.445) 10(-2.752,3.175) 11(-2.752,1.905) 12(-2.752,0.635) 13(-2.752,-0.635) 14(-2.752,-1.905) 15(-2.752,-3.175) 16(-2.752,-4.445)
TQFP32-7*7
  oval 0.45x1.8 smd: 1(-2.803,-4.1) 2(-2.002,-4.1) 3(-1.202,-4.1) 4(-0.403,-4.1) 5(0.398,-4.1) 6(1.198,-4.1) 7(1.998,-4.1) 8(2.797,-4.1) 17(2.797,4.1) 18(1.998,4.1) 19(1.198,4.1) 20(0.398,4.1) 21(-0.403,4.1) 22(-1.202,4.1) 23(-2.002,4.1) 24(-2.803,4.1)
  oval 1.8x0.45 smd: 9(4.098,-2.8) 10(4.098,-2) 11(4.098,-1.2) 12(4.098,-0.4) 13(4.098,0.4) 14(4.098,1.2) 15(4.098,2) 16(4.098,2.8) 25(-4.103,2.8) 26(-4.103,2) 27(-4.103,1.2) 28(-4.103,0.4) 29(-4.103,-0.4) 30(-4.103,-1.2) 31(-4.103,-2) 32(-4.103,-2.8)
TSW SMD-3*6*2.5
  rect 2x1.5 smd: 1(-3.996,-0.02) 2(3.937,0)
TYPE-C-USB-5
  oval 1.2x2 hole 0.8x1.6: 0(-4.5,-2.475) 2(4.5,-2.475)
  round 0.75 hole 0.75: 1(2.978,1.175) 5(-2.803,1.175)
  oval 1.2x2.3 hole 0.7x1.8: 3(4.5,1.675) 4(-4.5,1.675)
  rect 0.3x1.15 smd: A1(-3.263,2.474) A4(-2.462,2.471) A5(-1.163,2.475) A6(-0.163,2.475) A7(0.338,2.474) A8(1.337,2.475) A9(2.638,2.475) A12(3.438,2.475) B1(3.138,2.475) B4(2.337,2.475) B5(1.837,2.475) B6(0.838,2.475) B7(-0.662,2.474) B8(-1.663,2.475) B9(-2.163,2.471) B12(-2.962,2.474)

## Nets
As in the schematic.

Pads without a net: U2 7 8 9 10 11 12 14 15; USB-C2 0 1 2 3 4 5 A5 A8 B5 B8; V2 4

# Board Dev_V1
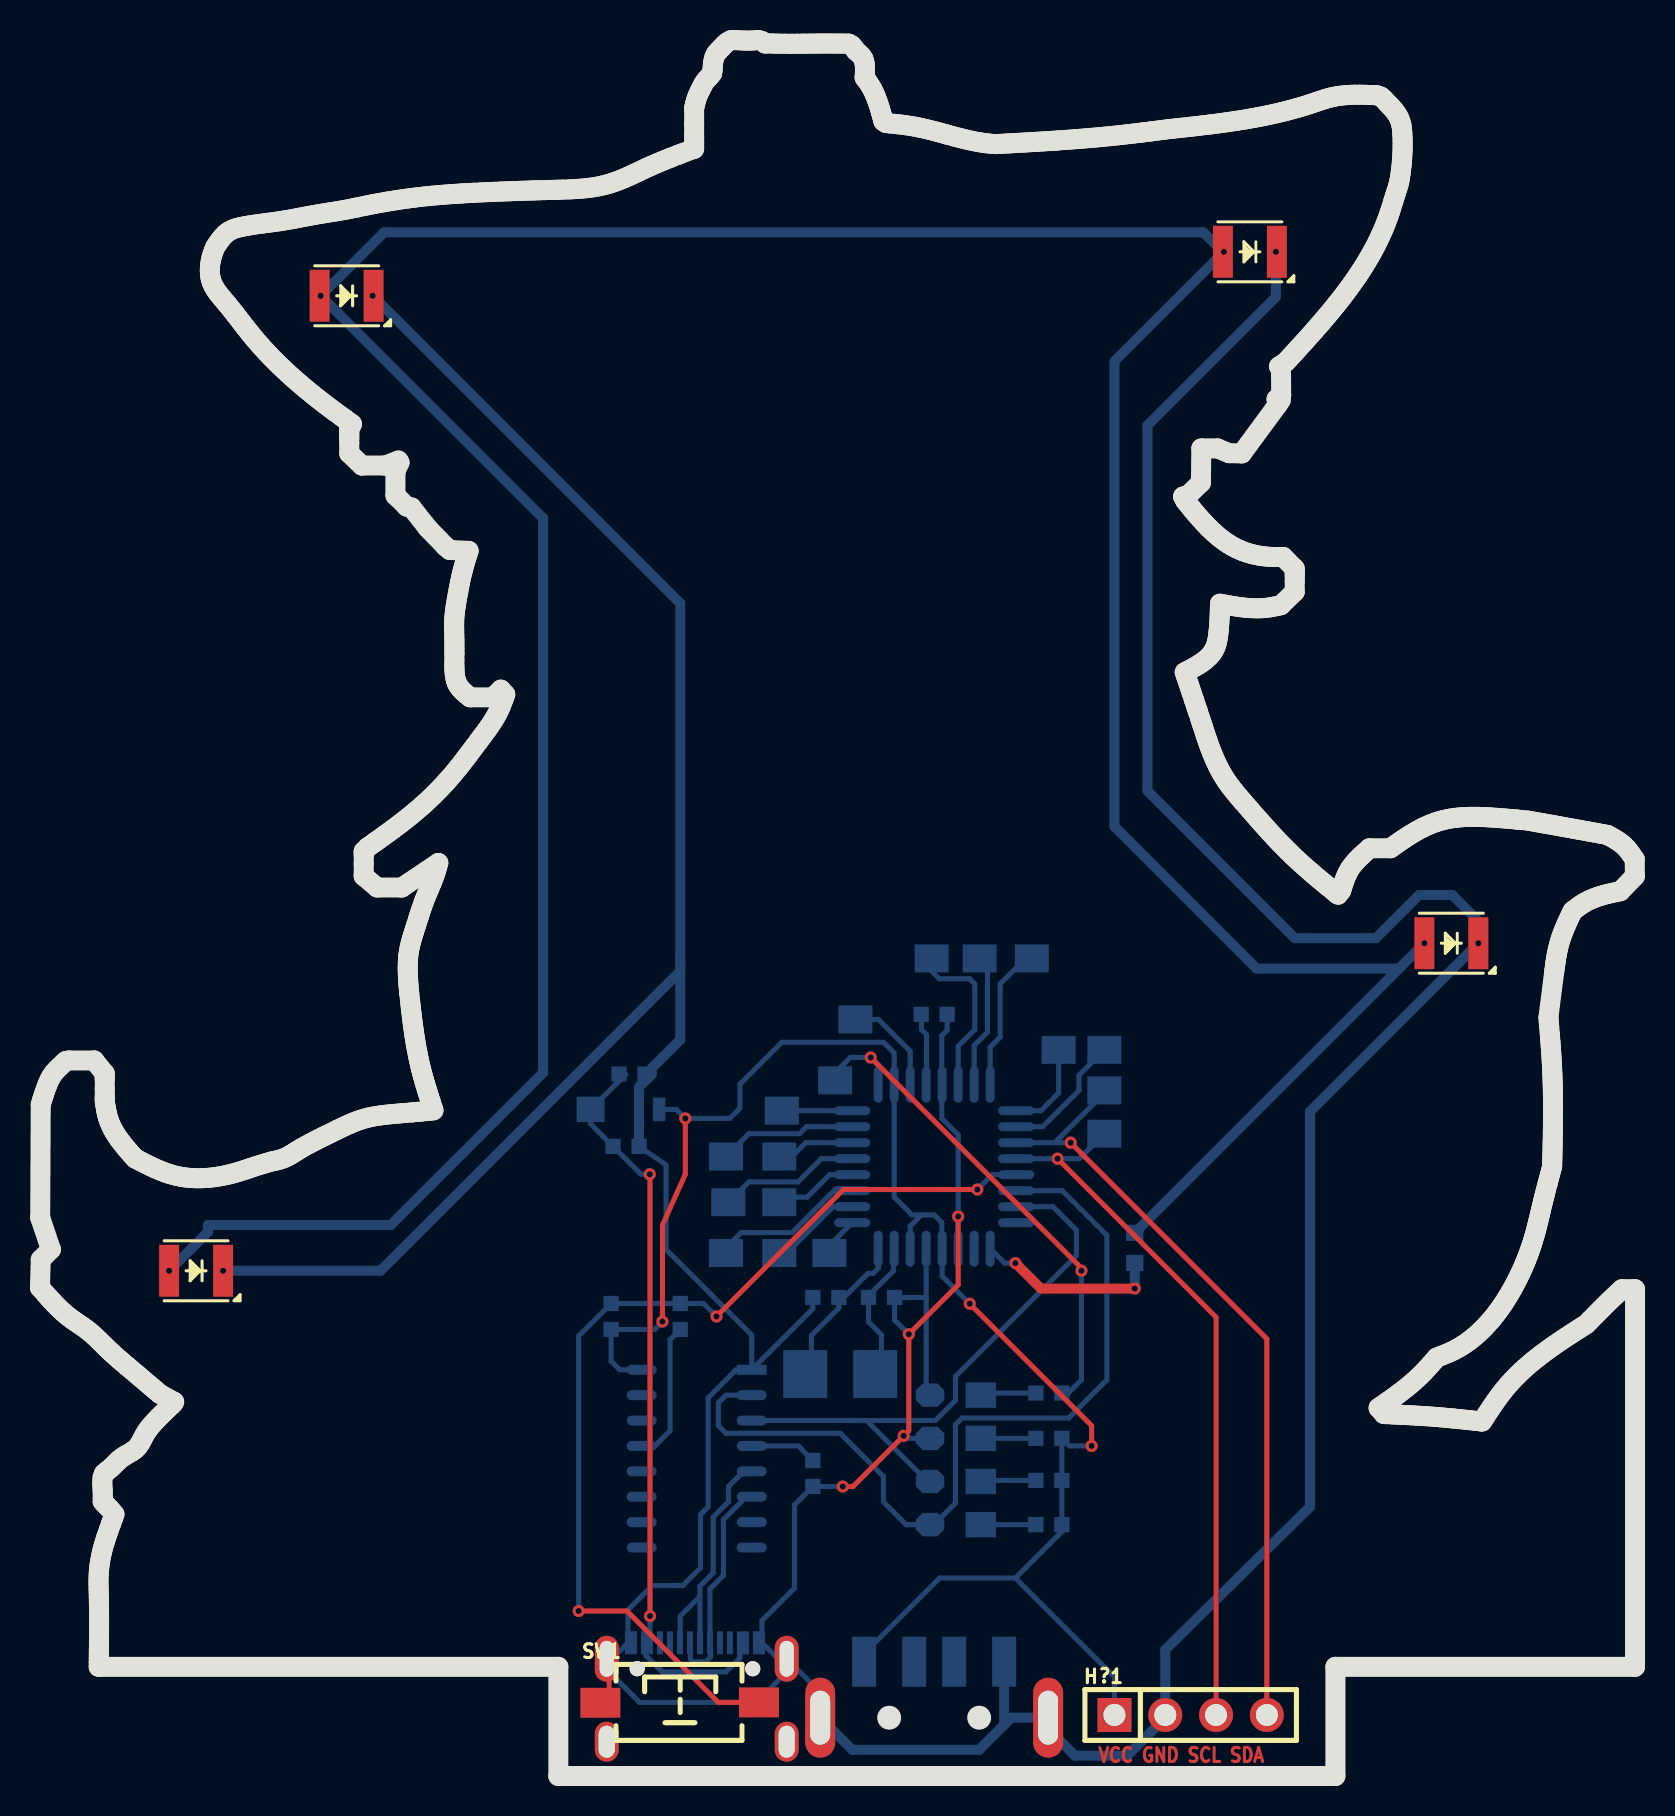
[diagram p8: board, top side]
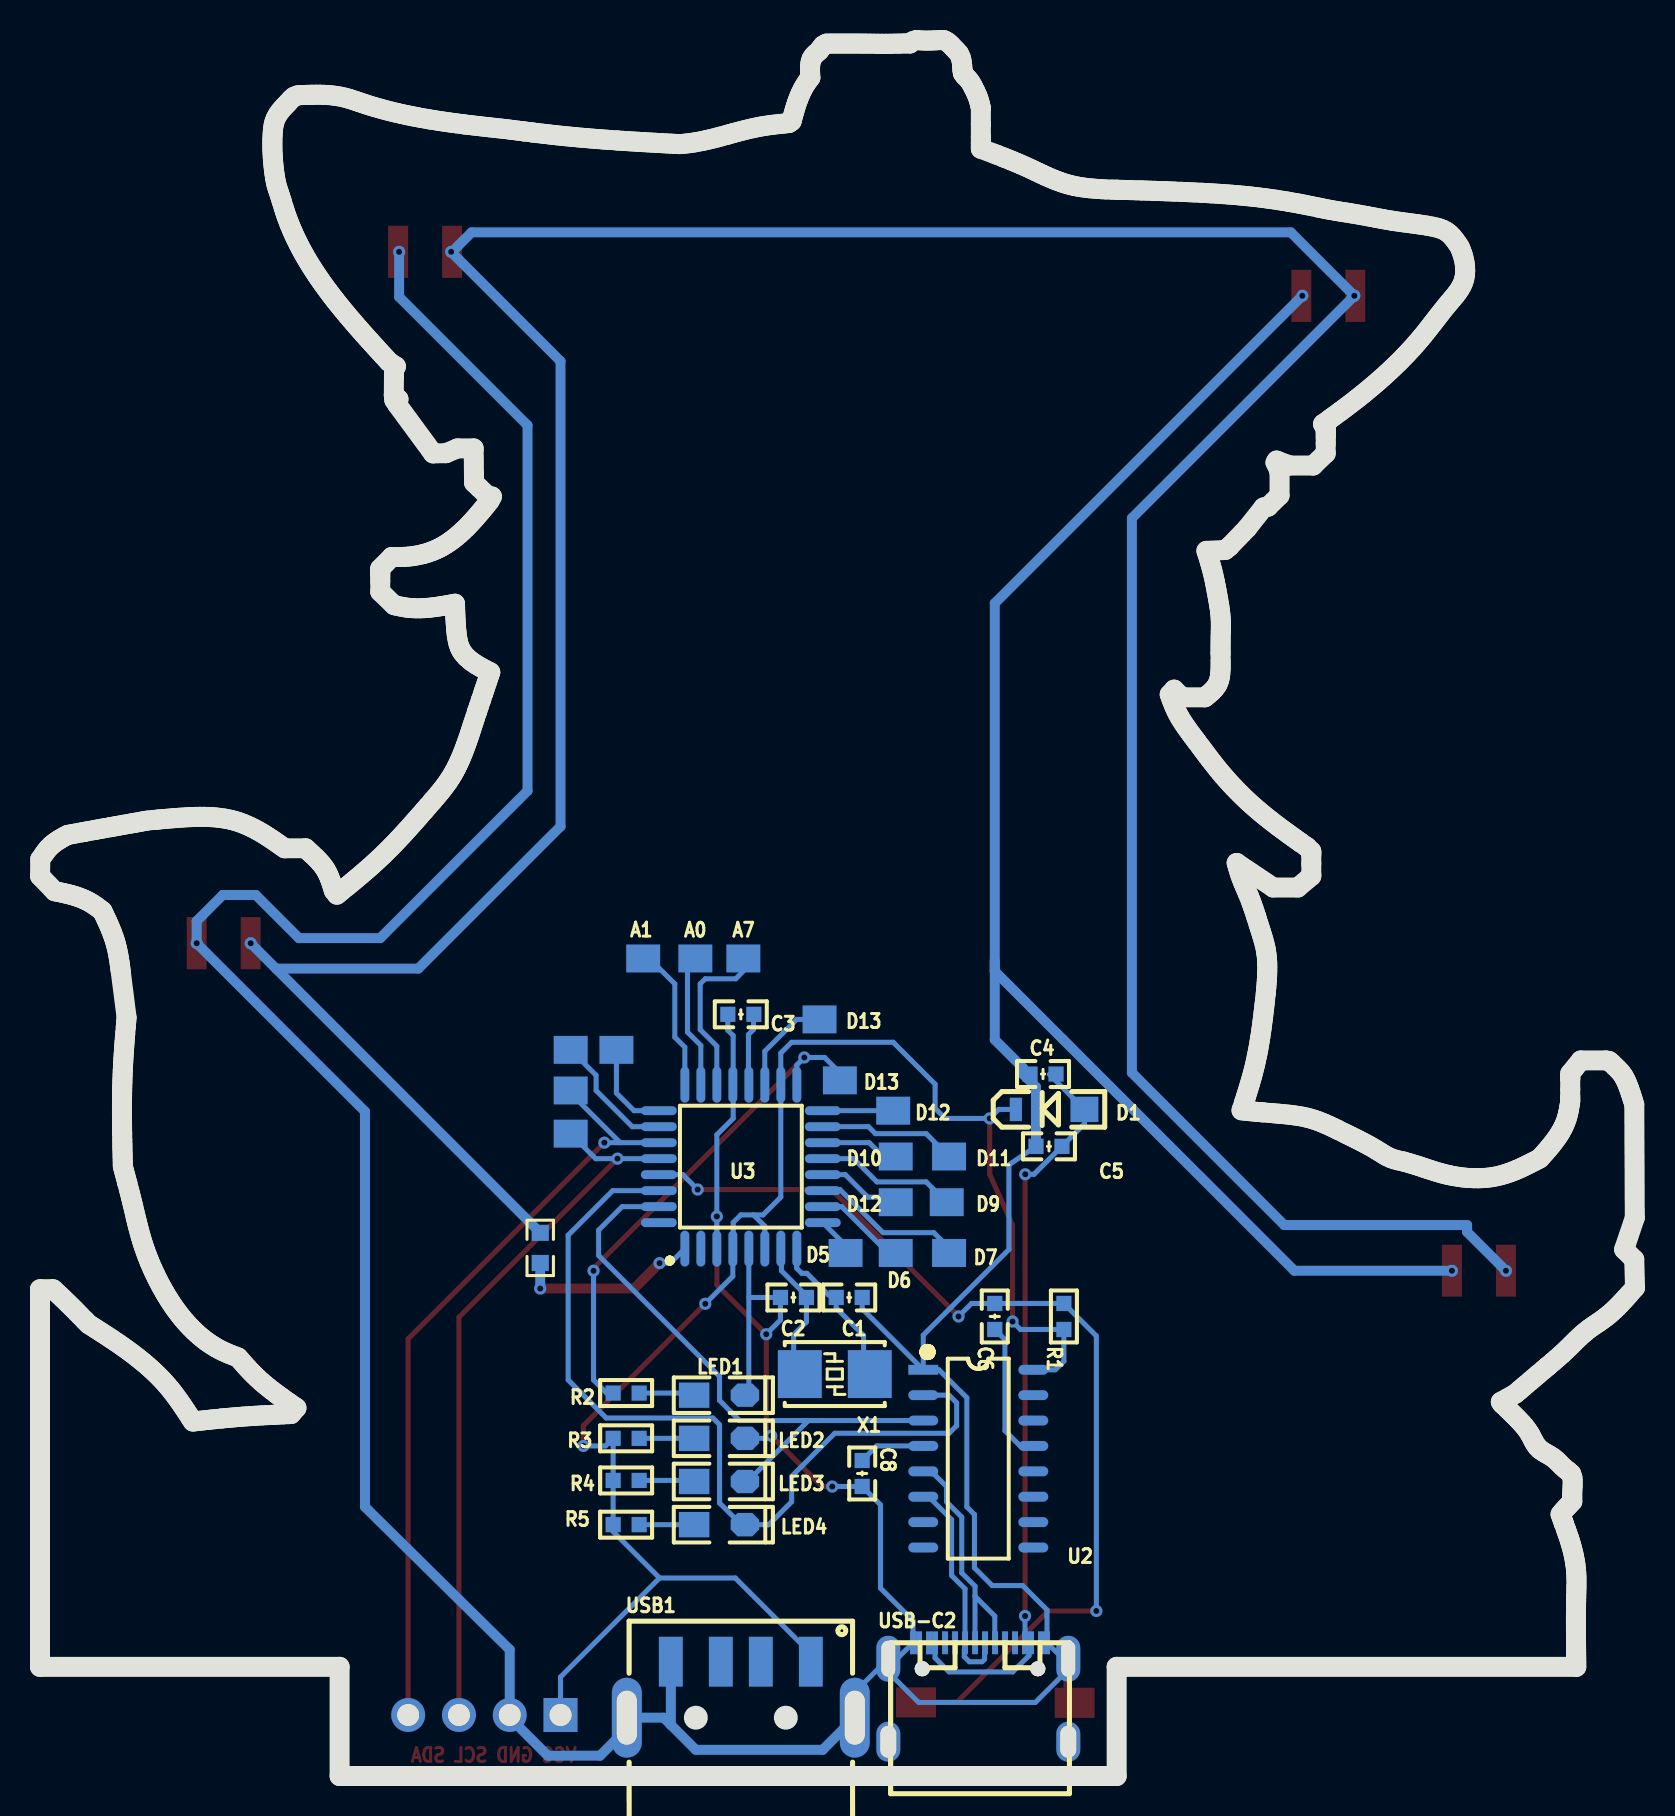
[diagram p9: board, bottom side, seen from below]

Outline 79.77 x 86.84 mm; copper layers: Top Layer, Bottom Layer. Coordinates in mm from the lower left corner of the outline.
Stack: Top Layer 0.012mm / Dielectric1 0.025mm FR4 er 4.5 / Bottom Layer 0.012mm

## Design rules (mm)
spacing Default (default): track to track 0.152, other pairs 0 to 0.152
track width Default (default): min 0.254, default 0.254, max 25.4
differential pair differentialPair (default): width min 0.127, default 0.254, max 2.54; gap min 0.152, default 0.152
via Default (default): diameter min 0.61, default 0.61, max 100.025; hole min 0.305, default 0.305, max 59.995

## Placement (name value [footprint] x y rotation side)
C1  22pF  [C 0603_L]  39.3 23.94 180 bottom
C2  22pF  [C 0603_L]  42.09 23.94 0 bottom
C3  100nF  [C 0603_L]  44.72 38.1 0 bottom
C4  0.1uF  [C 0603_L]  29.61 35.11 0 bottom
C5  4.7uF  [C 0603_L]  29.31 31.5 0 bottom
C6  100nF  [C 0603_L]  32.02 22.99 90 bottom
C8  100nF  [C 0603_L]  38.65 15.13 270 bottom
D1  SS26  [SOD-123]  29.25 33.35 180 bottom
H？1  -  [HDR-TH_4P-P2.54-V-F]  57.55 3.05 0 top
LED1  LED-RED  [LED 0805]  45.78 19.05 180 bottom
LED2  LED-RED  [LED 0805]  45.78 16.89 180 bottom
LED3  LED-BLUE  [LED 0805B]  45.78 14.73 180 bottom
LED4  LED-YELLOW  [LED 0805Y]  45.78 12.57 180 bottom
NOREF  -  [Pad_e124]  36.97 30.99 0 top
NOREF#2  -  [Pad_e188]  53.23 36.32 0 top
NOREF#3  -  [Pad_e65]  39.77 34.8 0 top
NOREF#4  -  [Pad_e84]  39.48 26.16 0 top
NOREF#5  -  [Pad_e137]  37.1 33.28 0 top
NOREF#6  -  [Pad_e110]  44.59 40.89 0 top
NOREF#7  -  [Pad_e179]  50.94 36.32 0 top
NOREF#8  -  [Pad_e96]  36.97 26.16 0 top
NOREF#9  -  [Pad_e200]  53.23 32.13 0 top
NOREF#10  -  [Pad_e115]  46.99 40.89 0 top
NOREF#11  -  [Pad_e93]  40.78 37.85 0 top
NOREF#12  -  [Pad_e133]  34.31 30.99 0 top
NOREF#13  -  [Pad_e117]  34.42 28.7 0 top
NOREF#14  -  [Pad_e100]  34.31 26.16 0 top
NOREF#15  -  [Pad_e108]  36.97 28.7 0 top
NOREF#16  -  [Pad_e120]  49.6 40.89 0 top
NOREF#17  -  [Pad_e198]  53.23 34.29 0 top
R1  1K  [R 0603_L#2]  28.56 22.99 90 bottom
R2  1K  [R 0603_L]  50.45 19.16 0 bottom
R3  1K  [R 0603_L]  50.45 16.89 0 bottom
R4  1K  [R 0603_L]  50.45 14.79 0 bottom
R5  1K  [R 0603_L]  50.45 12.57 0 bottom
R6  0R  [R0603]  54.75 26.42 270 bottom
SW1  3x6x5  [TSW SMD-3*6*2.5]  32.02 3.68 0 top
U2  CH340C  [SOP16_L]  32.84 15.88 0 bottom
U3  -  [LED-SMD_L3.5-W2.8-LS3.6-RD]  15.34 74.04 180 top
U3#2  -  [LED-SMD_L3.5-W2.8-LS3.6-RD]  70.58 41.66 180 top
U3#3  -  [LED-SMD_L3.5-W2.8-LS3.6-RD]  60.51 76.24 180 top
U3#4  -  [LED-SMD_L3.5-W2.8-LS3.6-RD]  7.81 25.27 180 top
U3#5  -  [TQFP32-7*7]  44.72 30.48 180 bottom
USB1  U217-041N-4BV81  [USB-A-SMD_U217-041N-4BV81]  44.72 4.32 180 bottom
USB-C2  USB-C  [TYPE-C-USB-5]  32.84 4.19 180 bottom
X1  16MHz  [OSC 5032-2P]  40.02 20.11 180 bottom

## Footprints (pads in the part's own frame, mm; a bottom-side part is the same pattern mirrored in y, then rotated)
C 0603_L
  rect 0.762x0.762 smd: 1(0.65,0) 2(-0.65,0)
HDR-TH_4P-P2.54-V-F
  rect 1.7x1.7 hole 1.1: 1(-3.81,0)
  round 1.7 hole 1.1: 2(-1.27,0) 3(1.27,0) 4(3.81,0)
LED 0805
  rect 1.524x1.27 smd: 1(-1.27,0)
  custom 1.427x1.173 smd: 2(1.27,0)
LED 0805B
  rect 1.524x1.27 smd: 1(-1.27,0)
  custom 1.427x1.173 smd: 2(1.27,0)
LED 0805Y
  rect 1.524x1.27 smd: 1(-1.27,0)
  custom 1.427x1.173 smd: 2(1.27,0)
LED-SMD_L3.5-W2.8-LS3.6-RD
  rect 1x2.6 smd: 1(-1.35,0) 2(1.35,0)
OSC 5032-2P
  rect 2.2x2.4 smd: 1(1.75,0) 2(-1.75,0)
Pad_e65
  rect 1.7x1.4 smd far side: 39(0,0)
Pad_e84
  rect 1.7x1.4 smd far side: 1(0,0)
Pad_e93
  rect 1.7x1.4 smd far side: 1(0,0)
Pad_e96
  rect 1.7x1.4 smd far side: 2(0,0)
Pad_e100
  rect 1.7x1.4 smd far side: 33(0,0)
Pad_e108
  rect 1.7x1.4 smd far side: 34(0,0)
Pad_e110
  rect 1.7x1.4 smd far side: 2(0,0)
Pad_e115
  rect 1.7x1.4 smd far side: 40(0,0)
Pad_e117
  rect 1.7x1.4 smd far side: 35(0,0)
Pad_e120
  rect 1.7x1.4 smd far side: 41(0,0)
Pad_e124
  rect 1.7x1.4 smd far side: 36(0,0)
Pad_e133
  rect 1.7x1.4 smd far side: 37(0,0)
Pad_e137
  rect 1.7x1.4 smd far side: 38(0,0)
Pad_e179
  rect 1.7x1.4 smd far side: 42(0,0)
Pad_e188
  rect 1.7x1.4 smd far side: 43(0,0)
Pad_e198
  rect 1.7x1.4 smd far side: 44(0,0)
Pad_e200
  rect 1.7x1.4 smd far side: 45(0,0)
R0603
  rect 0.806x0.864 smd: 1(-0.753,0) 2(0.753,0)
R 0603_L
  rect 0.762x0.762 smd: 1(-0.65,0) 2(0.65,0)
R 0603_L#2
  rect 0.762x0.762 smd: 1(0.65,0) 2(-0.65,0)
SOD-123
  rect 1.397x1.27 smd: 1(1.714,0)
  custom 0.613x1.173 smd: 2(-1.714,0)
SOP16_L
  rect 1.5x0.5 smd: 1(2.752,-4.445)
  oval 1.5x0.5 smd: 2(2.752,-3.175) 3(2.752,-1.905) 4(2.752,-0.635) 5(2.752,0.635) 6(2.752,1.905) 7(2.752,3.175) 8(2.752,4.445) 9(-2.752,4.445) 10(-2.752,3.175) 11(-2.752,1.905) 12(-2.752,0.635) 13(-2.752,-0.635) 14(-2.752,-1.905) 15(-2.752,-3.175) 16(-2.752,-4.445)
TQFP32-7*7
  oval 0.45x1.8 smd: 1(-2.803,-4.1) 2(-2.002,-4.1) 3(-1.202,-4.1) 4(-0.403,-4.1) 5(0.398,-4.1) 6(1.198,-4.1) 7(1.998,-4.1) 8(2.797,-4.1) 17(2.797,4.1) 18(1.998,4.1) 19(1.198,4.1) 20(0.398,4.1) 21(-0.403,4.1) 22(-1.202,4.1) 23(-2.002,4.1) 24(-2.803,4.1)
  oval 1.8x0.45 smd: 9(4.098,-2.8) 10(4.098,-2) 11(4.098,-1.2) 12(4.098,-0.4) 13(4.098,0.4) 14(4.098,1.2) 15(4.098,2) 16(4.098,2.8) 25(-4.103,2.8) 26(-4.103,2) 27(-4.103,1.2) 28(-4.103,0.4) 29(-4.103,-0.4) 30(-4.103,-1.2) 31(-4.103,-2) 32(-4.103,-2.8)
TSW SMD-3*6*2.5
  rect 2x1.5 smd: 1(-3.996,-0.02) 2(3.937,0)
TYPE-C-USB-5
  oval 1.2x2 hole 0.8x1.6: 0(-4.5,-2.475) 2(4.5,-2.475)
  round 0.75 hole 0.75: 1(2.978,1.175) 5(-2.803,1.175)
  oval 1.2x2.3 hole 0.7x1.8: 3(4.5,1.675) 4(-4.5,1.675)
  rect 0.3x1.15 smd: A1(-3.263,2.474) A4(-2.462,2.471) A5(-1.163,2.475) A6(-0.163,2.475) A7(0.338,2.474) A8(1.337,2.475) A9(2.638,2.475) A12(3.438,2.475) B1(3.138,2.475) B4(2.337,2.475) B5(1.837,2.475) B6(0.838,2.475) B7(-0.662,2.474) B8(-1.663,2.475) B9(-2.163,2.471) B12(-2.962,2.474)
USB-A-SMD_U217-041N-4BV81
  rect 1.2x2.5 smd: 1(3.5,1.4) 2(1,1.4) 3(-1,1.4) 4(-3.5,1.4)
  oval 1.5x4 hole 1x2.7: 5(-5.7,-1.4) 6(5.7,-1.4)

## Nets
GND: C1.1 C2.1 C3.1 C4.1 C5.1 C8.1 H？1.2 LED1.2 LED2.2 SW1.1 U2.1 U3.1 U3#2.1 U3#3.1 U3#4.1 U3#5.3 U3#5.5 U3#5.21 USB1.4 USB1.5 USB1.6 USB-C2.3 USB-C2.4 USB-C2.A1 USB-C2.A12 USB-C2.B1 USB-C2.B12
VCC: C4.2 C5.2 D1.1 USB-C2.A4 USB-C2.A9 USB-C2.B4 USB-C2.B9
+5: D1.2 H？1.1 R1.2 R3.2 R4.2 R5.2 U2.16 U3#5.4 U3#5.6 U3#5.18 USB1.1
A0: NOREF#10.40 U3#5.23
A1: NOREF#16.41 U3#5.24
A2: NOREF#7.42 U3#5.25
A3: NOREF#2.43 U3#5.26
A4: H？1.4 NOREF#17.44 U3#5.27
A5: H？1.3 NOREF#9.45 U3#5.28
A6: NOREF#11.1 U3#5.19
A7: NOREF#6.2 U3#5.22
AREF: C3.2 U3#5.20
CH340D+: U2.5 USB-C2.A6 USB-C2.B6
CH340D-: U2.6 USB-C2.A7 USB-C2.B7
D0/RX: LED4.2 U2.2 U3#5.30
D1/TX: LED3.2 U2.3 U3#5.31
D2: U3#5.32
D3: R6.1 R6.2 U3.2 U3#2.2 U3#3.2 U3#4.2 U3#5.1
D4: U3#5.2
D5: NOREF#4.1 U3#5.9
D6: NOREF#8.2 U3#5.10
D7: NOREF#14.33 U3#5.11
D8: NOREF#15.34 U3#5.12
D9: NOREF#13.35 U3#5.13
D10: NOREF.36 U3#5.14
D11: NOREF#12.37 U3#5.15
D12: NOREF#5.38 U3#5.16
D13: NOREF#3.39 R2.2 U3#5.17
RESET: C6.1 R1.1 SW1.2 U3#5.29
$2N83: C8.2 U2.4
$2N99: LED1.1 R2.1
$2N104: LED2.1 R3.1
$2N105: LED3.1 R4.1
$2N106: LED4.1 R5.1
$2N165: C1.2 U3#5.8 X1.1
$2N166: C2.2 U3#5.7 X1.2
$2N207: C6.2 U2.13

Pads without a net: U2 7 8 9 10 11 12 14 15; USB1 2 3; USB-C2 0 1 2 5 A5 A8 B5 B8

## Via types
v1: diameter 0.61, hole 0.305, Top Layer to Bottom Layer, 27 vias

## Routing (per net, layer and track width the routed paths; a pad name or vN(x,y) marks a point on that pad's centre or on a via; arc(x,y) is an arc through that point)
GND:
  vias: v1(9.16,25.27) v1(16.64,74.04) v1(40.15,14.48) v1(43.2,17.02) v1(43.45,22.1) v1(45.92,27.99) v1(61.81,76.24) v1(71.93,41.66)
VCC: length 37.2
  Top Layer w0.254: v1(30.51,8) 30.51,30.09
  Bottom Layer w0.254: 29.29,35.1 27.54,33.35 D1.1 27.54,32.62 30.06,30.1 v1(30.5,30.1) ; 30.31,6.54 30.31,6.03 31.12,5.21 34.31,5.21 35.01,5.91 USB-C2.B9 ; USB-C2.B4 v1(30.51,8)
+5:
  vias: v1(31.13,22.73) v1(32.27,32.89) v1(46.5,23.62) v1(52.59,16.51)
A4:
  vias: v1(51.54,31.68)
A5:
  vias: v1(50.89,30.88)
D3:
  vias: v1(6.46,25.27) v1(14.04,74.04) v1(48.78,25.65) v1(54.75,24.38) v1(59.21,76.24) v1(69.23,41.66)
D13:
  vias: v1(41.54,35.94) v1(52.09,25.27)
RESET: length 50.4
  Top Layer w0.254: v1(26.94,8.26) 29.35,8.26 33.92,3.68 SW1.2 ; v1(33.83,22.99) 40.18,29.34 v1(46.88,29.34)
  Bottom Layer w0.254: v1(26.94,8.26) 26.94,22.01 R1.1 C6.1 33.18,23.64 v1(33.83,22.99) ; v1(46.88,29.34) 47.62,30.08 48.82,30.08
A7: length 8.1
  Bottom Layer w0.254: 44.47,40.51 44.47,40.39 44.97,39.88 46.5,39.88 46.75,39.62 46.75,37.34 45.92,36.51 45.92,34.58
AREF: length 3.4
  Bottom Layer w0.254: C3.2 44.08,38.09 44.08,37.34 44.34,37.08 44.34,34.8
CH340D+: length 12.2
  Bottom Layer w0.254: USB-C2.B6 32.02,6.68 32.02,8 33.01,8.99 33.01,9.04 ; USB-C2.A6 33.01,9.5 33.67,10.16 33.67,12.95 34.43,13.72 34.43,14.48 35.07,15.11 35.19,15.11
CH340D-: length 10
  Bottom Layer w0.254: 32.53,6.22 32.53,5.84 32.65,5.72 33.29,5.72 33.54,5.97 33.54,6.35 ; USB-C2.B7 33.51,9.36 34.18,10.03 34.18,12.83 35.32,13.97
D0/RX: length 43.1
  Bottom Layer w0.254: 35.34,19.05 34.31,19.05 33.92,18.67 33.92,17.53 34.31,17.15 40.02,17.15 42.18,14.99 42.18,13.72 43.32,12.57 ; 43.32,12.57 43.5,12.57 ; 43.32,12.57 LED4.2 44.7,12.57 45.78,13.66 45.78,17.57 46.12,17.91 51.45,17.91 53.36,19.81 53.36,27.05 51.13,29.28 48.82,29.28
D1/TX: length 29.6
  Bottom Layer w0.254: 35.6,17.78 41.34,17.78 44.07,15.05 ; 40.7,17.78 44.78,17.78 45.78,18.79 45.78,19.99 51.83,26.04 51.83,27.31 50.66,28.48 48.82,28.48
$2N83: length 3.4
  Bottom Layer w0.254: U2.4 37.92,16.51 C8.2
$2N99: length 2.8
  Bottom Layer w0.254: 47.05,19.05 47.16,19.16 R2.1
$2N104: length 2.8
  Bottom Layer w0.254: R3.1 47.05,16.89
$2N105: length 3.2
  Bottom Layer w0.254: 46.62,14.73 46.68,14.79 49.81,14.79
$2N106: length 2.8
  Bottom Layer w0.254: R5.1 47.05,12.57
$2N165: length 7.8
  Bottom Layer w0.254: 38.58,20 38.58,22.04 39.95,23.41 C1.2 ; 39.95,24.06 40.34,24.06 41.42,25.15 41.67,25.15 41.93,25.4 41.93,26.16
$2N166: length 6.8
  Bottom Layer w0.254: C2.2 41.44,22.71 42.08,22.07 42.08,20 ; 41.59,23.94 41.59,24.17 42.69,25.27 42.69,26.04
$2N207: length 6.8
  Bottom Layer w0.254: 30.28,16.51 30.75,16.51 31.51,17.27 31.51,21.83 C6.2

## Text on the board
Bottom Silkscreen Layer: D11 | D9 | D7 | D12 | D6 | D13 | D10 | A7 | A0 | A1 | D5
Top Layer: VCC GND SCL SDA
Top Solder Mask Layer: VCC GND SCL SDA

# Board pcb_1
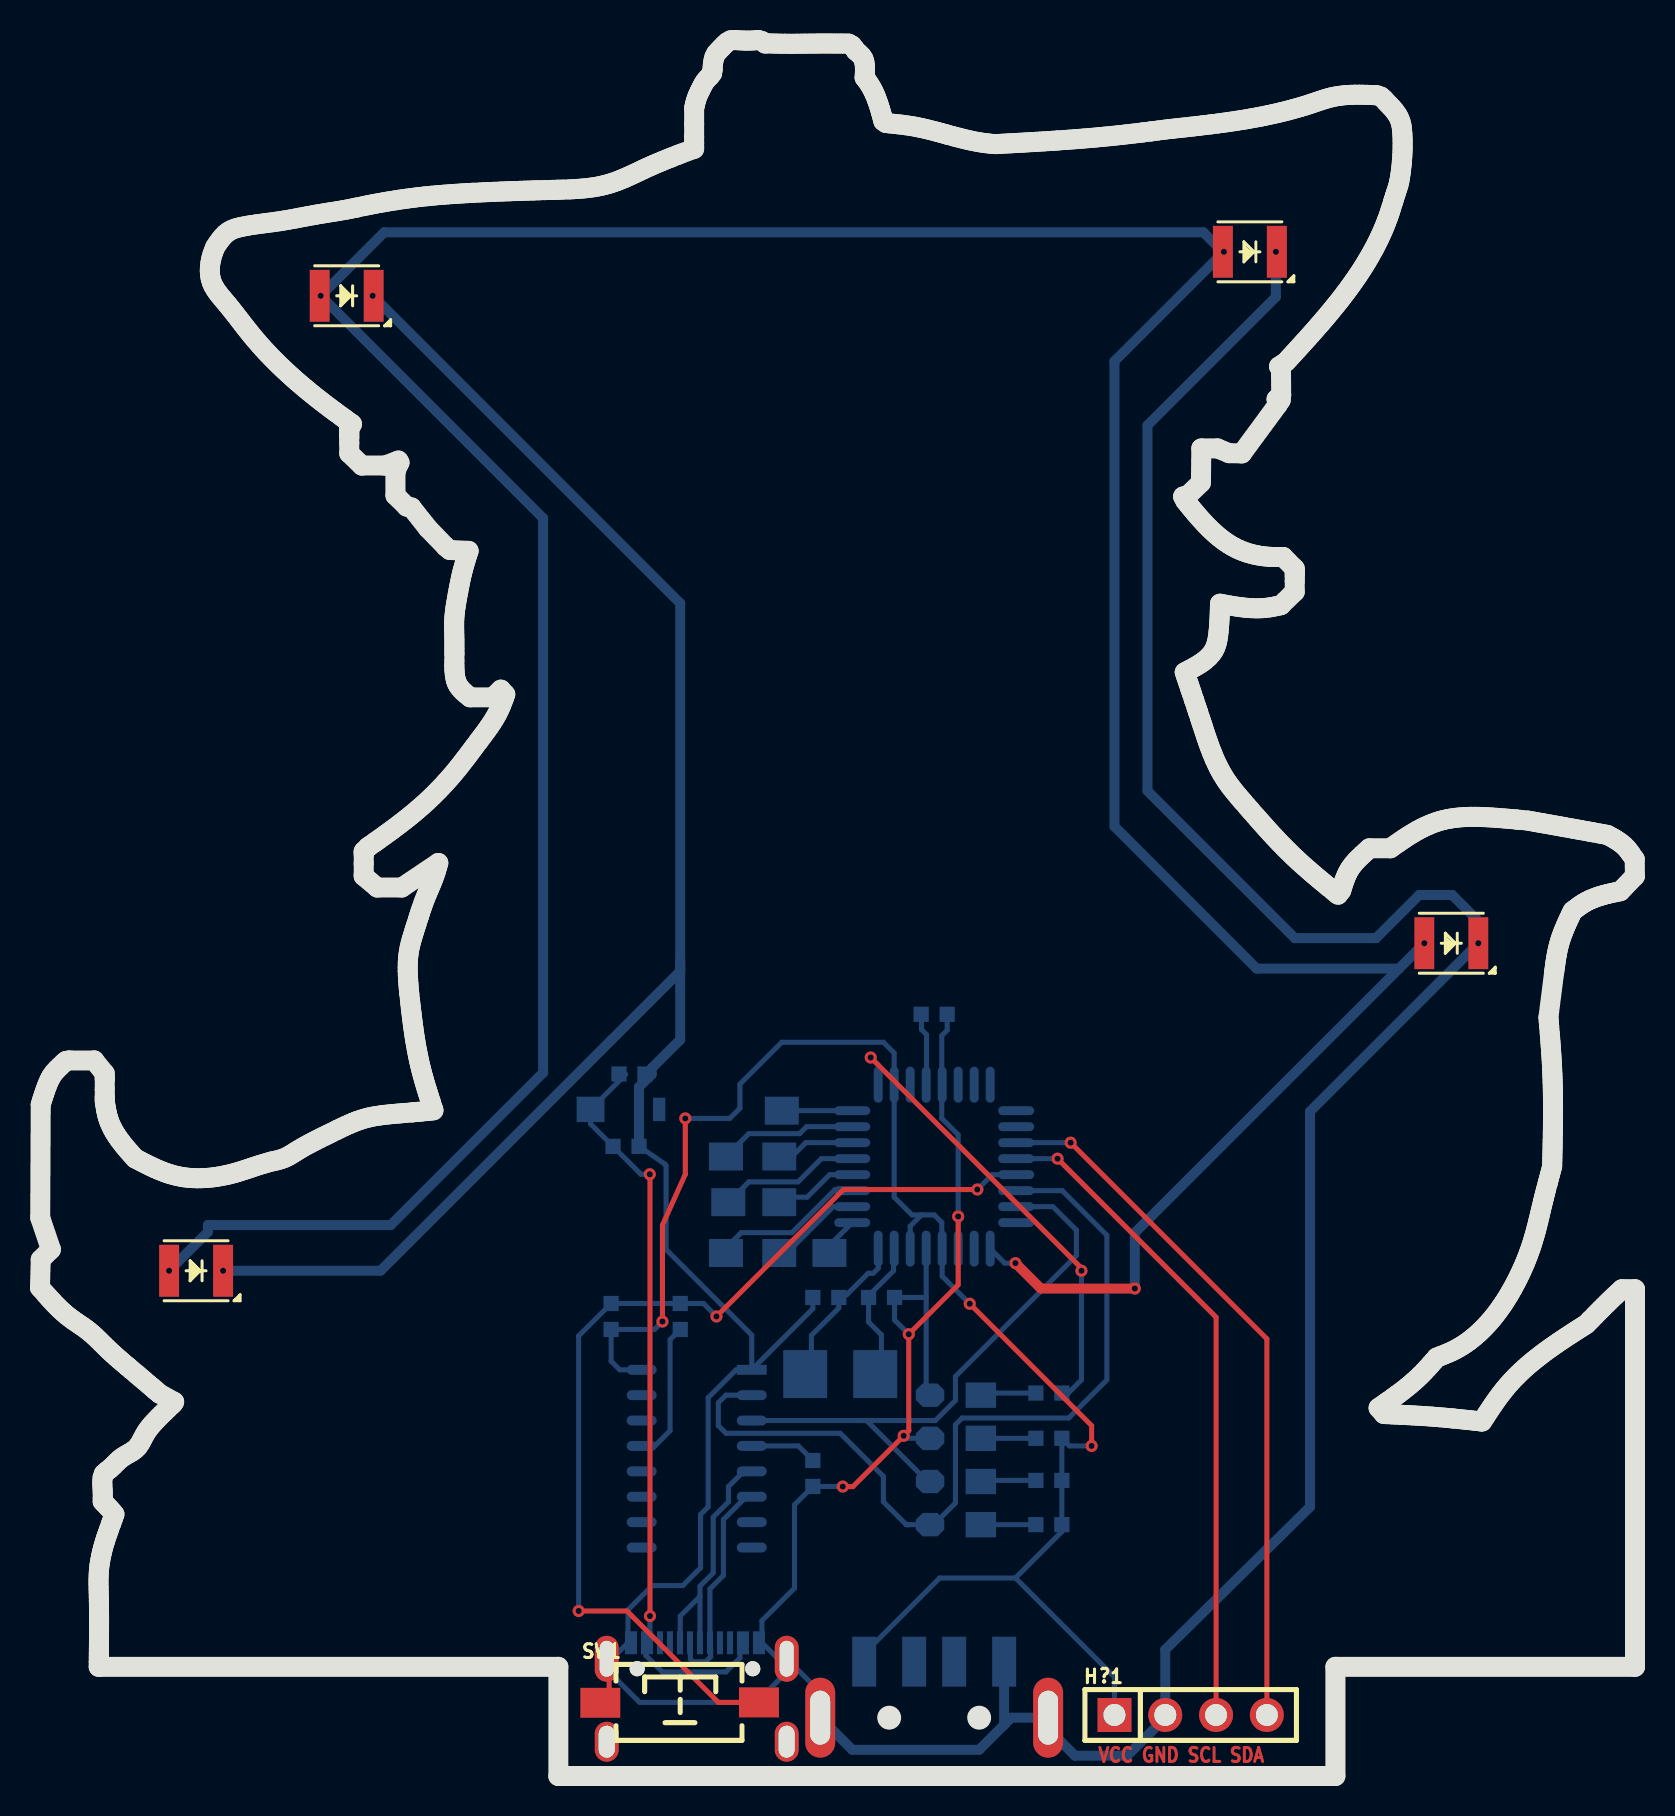
[diagram p10: board, top side]
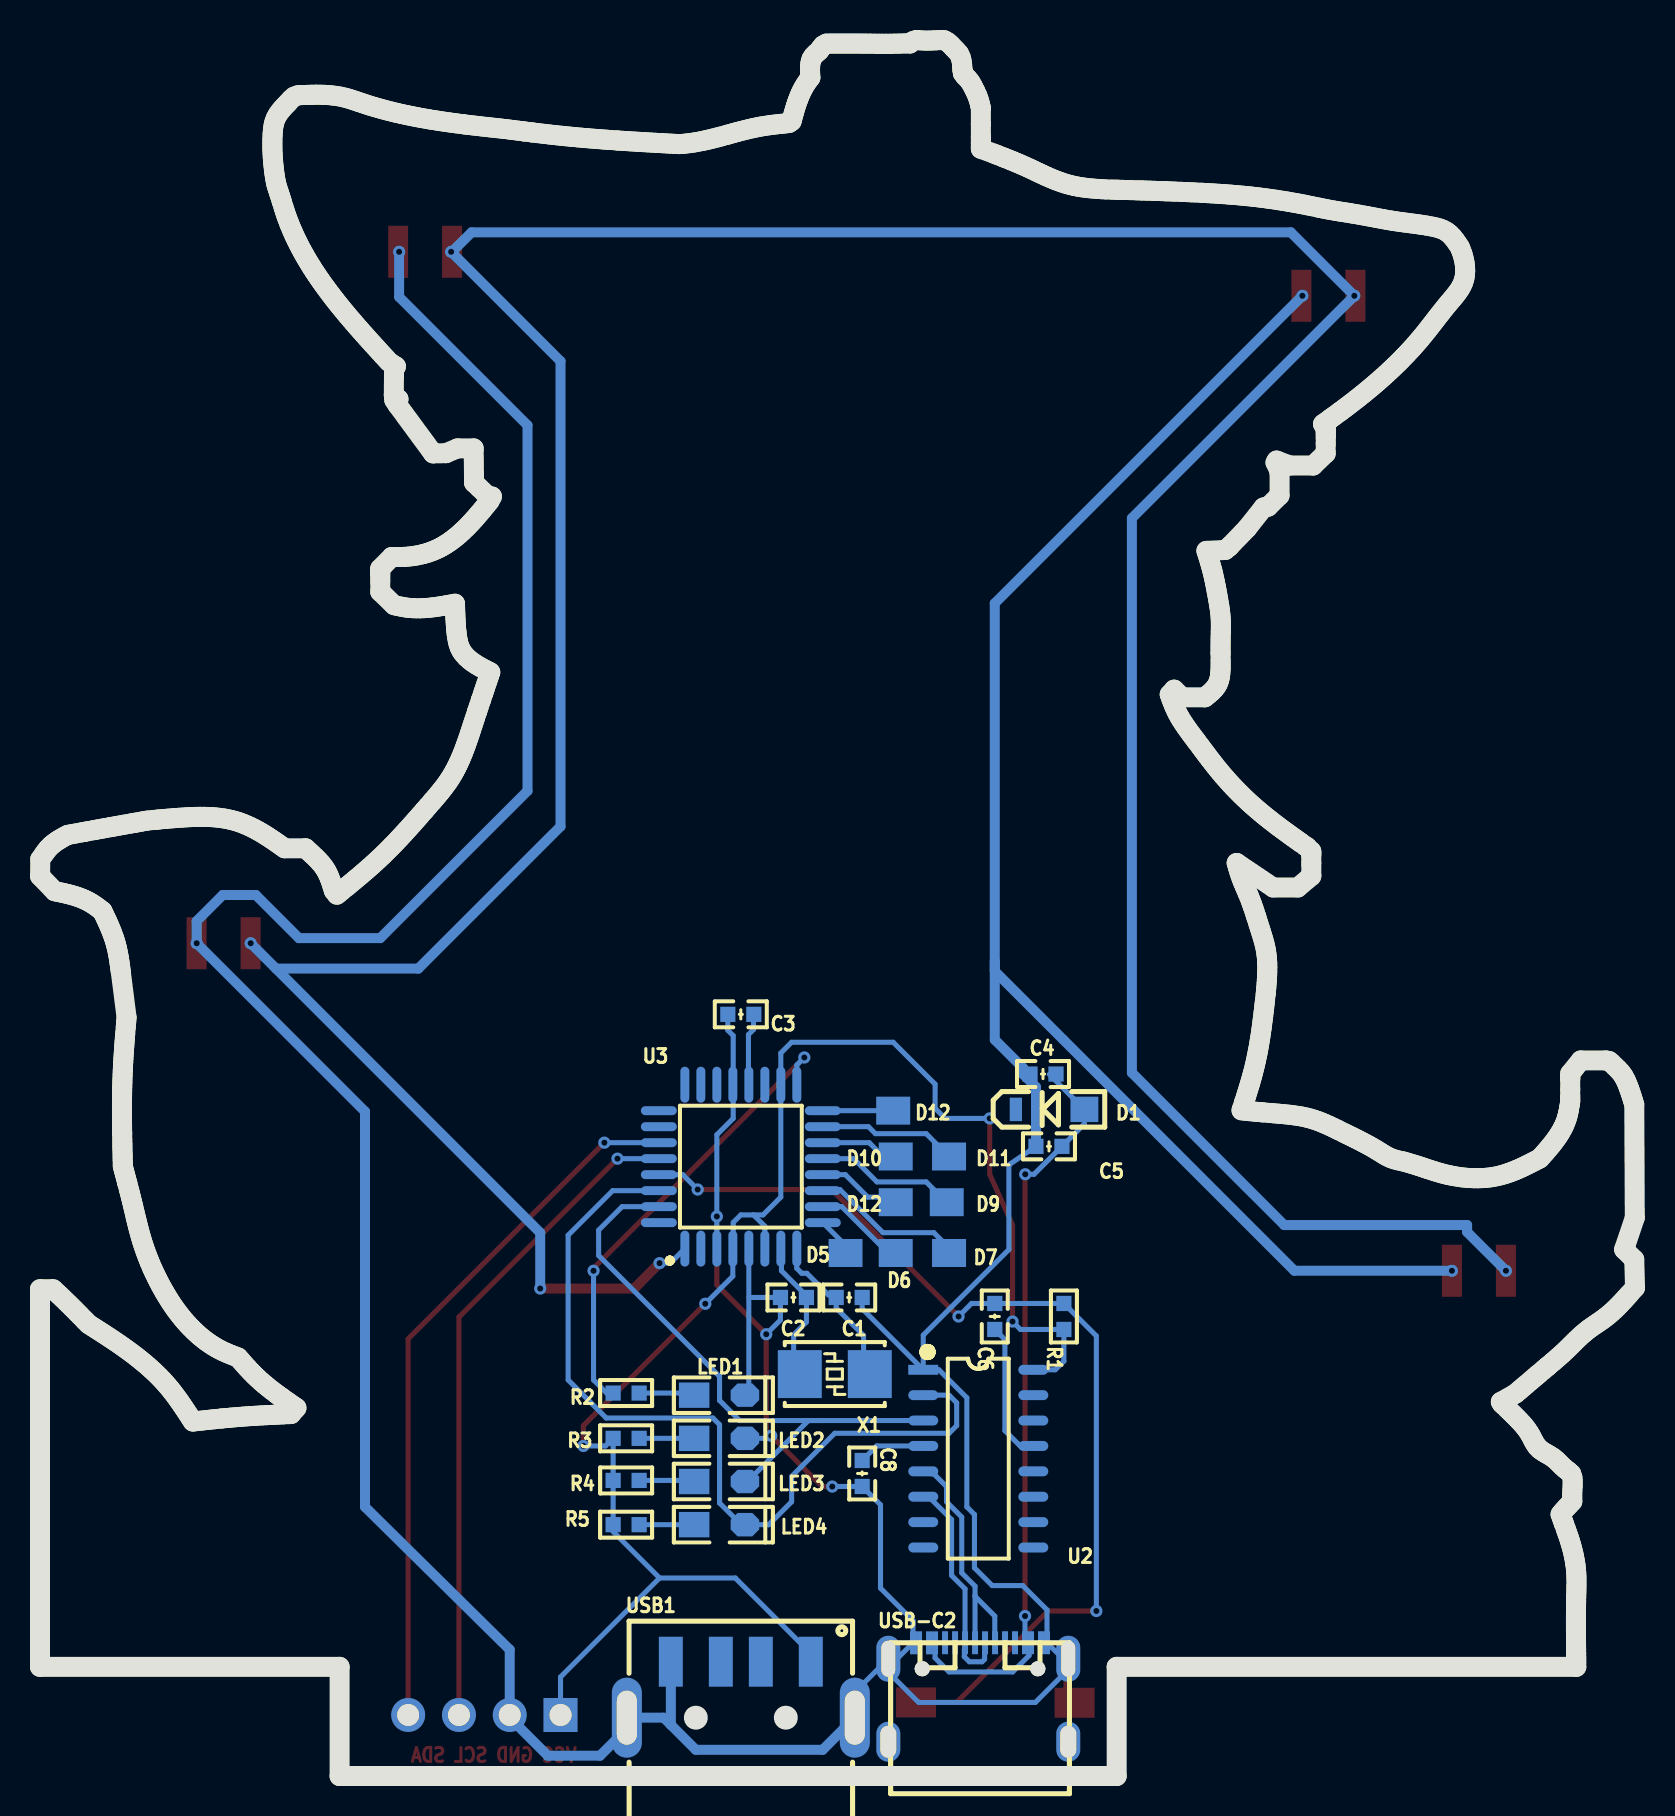
[diagram p11: board, bottom side, seen from below]

Outline 79.77 x 86.84 mm; copper layers: Top Layer, Bottom Layer. Coordinates in mm from the lower left corner of the outline.
Stack: Top Layer 0.012mm / Dielectric1 0.025mm FR4 er 4.5 / Bottom Layer 0.012mm

## Design rules (mm)
spacing Default (default): track to track 0.152, other pairs 0 to 0.152
track width Default (default): min 0.254, default 0.254, max 25.4
differential pair differentialPair (default): width min 0.127, default 0.254, max 2.54; gap min 0.152, default 0.152
via Default (default): diameter min 0.61, default 0.61, max 100.025; hole min 0.305, default 0.305, max 59.995

## Placement (name value [footprint] x y rotation side)
C1  22pF  [C 0603_L]  39.3 23.94 180 bottom
C2  22pF  [C 0603_L]  42.09 23.94 0 bottom
C3  100nF  [C 0603_L]  44.72 38.1 0 bottom
C4  0.1uF  [C 0603_L]  29.61 35.11 0 bottom
C5  4.7uF  [C 0603_L]  29.31 31.5 0 bottom
C6  100nF  [C 0603_L]  32.02 22.99 90 bottom
C8  100nF  [C 0603_L]  38.65 15.13 270 bottom
D1  SS26  [SOD-123]  29.25 33.35 180 bottom
H？1  -  [HDR-TH_4P-P2.54-V-F]  57.55 3.05 0 top
LED1  LED-RED  [LED 0805]  45.78 19.05 180 bottom
LED2  LED-RED  [LED 0805]  45.78 16.89 180 bottom
LED3  LED-BLUE  [LED 0805B]  45.78 14.73 180 bottom
LED4  LED-YELLOW  [LED 0805Y]  45.78 12.57 180 bottom
NOREF  -  [Pad_e84]  39.48 26.16 0 top
NOREF#2  -  [Pad_e96]  36.97 26.16 0 top
NOREF#3  -  [Pad_e124]  36.97 30.99 0 top
NOREF#4  -  [Pad_e137]  37.1 33.28 0 top
NOREF#5  -  [Pad_e100]  34.31 26.16 0 top
NOREF#6  -  [Pad_e117]  34.42 28.7 0 top
NOREF#7  -  [Pad_e108]  36.97 28.7 0 top
NOREF#8  -  [Pad_e133]  34.31 30.99 0 top
R1  1K  [R 0603_L#2]  28.56 22.99 90 bottom
R2  1K  [R 0603_L]  50.45 19.16 0 bottom
R3  1K  [R 0603_L]  50.45 16.89 0 bottom
R4  1K  [R 0603_L]  50.45 14.79 0 bottom
R5  1K  [R 0603_L]  50.45 12.57 0 bottom
SW1  3x6x5  [TSW SMD-3*6*2.5]  32.02 3.68 0 top
U2  CH340C  [SOP16_L]  32.84 15.88 0 bottom
U3  -  [LED-SMD_L3.5-W2.8-LS3.6-RD]  15.34 74.04 180 top
U3#2  -  [LED-SMD_L3.5-W2.8-LS3.6-RD]  70.58 41.66 180 top
U3#3  -  [LED-SMD_L3.5-W2.8-LS3.6-RD]  60.51 76.24 180 top
U3#4  -  [LED-SMD_L3.5-W2.8-LS3.6-RD]  7.81 25.27 180 top
U3#5  -  [TQFP32-7*7]  44.72 30.48 180 bottom
USB1  U217-041N-4BV81  [USB-A-SMD_U217-041N-4BV81]  44.72 4.32 180 bottom
USB-C2  USB-C  [TYPE-C-USB-5]  32.84 4.19 180 bottom
X1  16MHz  [OSC 5032-2P]  40.02 20.11 180 bottom

## Footprints (pads in the part's own frame, mm; a bottom-side part is the same pattern mirrored in y, then rotated)
C 0603_L
  rect 0.762x0.762 smd: 1(0.65,0) 2(-0.65,0)
HDR-TH_4P-P2.54-V-F
  rect 1.7x1.7 hole 1.1: 1(-3.81,0)
  round 1.7 hole 1.1: 2(-1.27,0) 3(1.27,0) 4(3.81,0)
LED 0805
  rect 1.524x1.27 smd: 1(-1.27,0)
  custom 1.427x1.173 smd: 2(1.27,0)
LED 0805B
  rect 1.524x1.27 smd: 1(-1.27,0)
  custom 1.427x1.173 smd: 2(1.27,0)
LED 0805Y
  rect 1.524x1.27 smd: 1(-1.27,0)
  custom 1.427x1.173 smd: 2(1.27,0)
LED-SMD_L3.5-W2.8-LS3.6-RD
  rect 1x2.6 smd: 1(-1.35,0) 2(1.35,0)
OSC 5032-2P
  rect 2.2x2.4 smd: 1(1.75,0) 2(-1.75,0)
Pad_e84
  rect 1.7x1.4 smd far side: 1(0,0)
Pad_e96
  rect 1.7x1.4 smd far side: 2(0,0)
Pad_e100
  rect 1.7x1.4 smd far side: 33(0,0)
Pad_e108
  rect 1.7x1.4 smd far side: 34(0,0)
Pad_e117
  rect 1.7x1.4 smd far side: 35(0,0)
Pad_e124
  rect 1.7x1.4 smd far side: 36(0,0)
Pad_e133
  rect 1.7x1.4 smd far side: 37(0,0)
Pad_e137
  rect 1.7x1.4 smd far side: 38(0,0)
R 0603_L
  rect 0.762x0.762 smd: 1(-0.65,0) 2(0.65,0)
R 0603_L#2
  rect 0.762x0.762 smd: 1(0.65,0) 2(-0.65,0)
SOD-123
  rect 1.397x1.27 smd: 1(1.714,0)
  custom 0.613x1.173 smd: 2(-1.714,0)
SOP16_L
  rect 1.5x0.5 smd: 1(2.752,-4.445)
  oval 1.5x0.5 smd: 2(2.752,-3.175) 3(2.752,-1.905) 4(2.752,-0.635) 5(2.752,0.635) 6(2.752,1.905) 7(2.752,3.175) 8(2.752,4.445) 9(-2.752,4.445) 10(-2.752,3.175) 11(-2.752,1.905) 12(-2.752,0.635) 13(-2.752,-0.635) 14(-2.752,-1.905) 15(-2.752,-3.175) 16(-2.752,-4.445)
TQFP32-7*7
  oval 0.45x1.8 smd: 1(-2.803,-4.1) 2(-2.002,-4.1) 3(-1.202,-4.1) 4(-0.403,-4.1) 5(0.398,-4.1) 6(1.198,-4.1) 7(1.998,-4.1) 8(2.797,-4.1) 17(2.797,4.1) 18(1.998,4.1) 19(1.198,4.1) 20(0.398,4.1) 21(-0.403,4.1) 22(-1.202,4.1) 23(-2.002,4.1) 24(-2.803,4.1)
  oval 1.8x0.45 smd: 9(4.098,-2.8) 10(4.098,-2) 11(4.098,-1.2) 12(4.098,-0.4) 13(4.098,0.4) 14(4.098,1.2) 15(4.098,2) 16(4.098,2.8) 25(-4.103,2.8) 26(-4.103,2) 27(-4.103,1.2) 28(-4.103,0.4) 29(-4.103,-0.4) 30(-4.103,-1.2) 31(-4.103,-2) 32(-4.103,-2.8)
TSW SMD-3*6*2.5
  rect 2x1.5 smd: 1(-3.996,-0.02) 2(3.937,0)
TYPE-C-USB-5
  oval 1.2x2 hole 0.8x1.6: 0(-4.5,-2.475) 2(4.5,-2.475)
  round 0.75 hole 0.75: 1(2.978,1.175) 5(-2.803,1.175)
  oval 1.2x2.3 hole 0.7x1.8: 3(4.5,1.675) 4(-4.5,1.675)
  rect 0.3x1.15 smd: A1(-3.263,2.474) A4(-2.462,2.471) A5(-1.163,2.475) A6(-0.163,2.475) A7(0.338,2.474) A8(1.337,2.475) A9(2.638,2.475) A12(3.438,2.475) B1(3.138,2.475) B4(2.337,2.475) B5(1.837,2.475) B6(0.838,2.475) B7(-0.662,2.474) B8(-1.663,2.475) B9(-2.163,2.471) B12(-2.962,2.474)
USB-A-SMD_U217-041N-4BV81
  rect 1.2x2.5 smd: 1(3.5,1.4) 2(1,1.4) 3(-1,1.4) 4(-3.5,1.4)
  oval 1.5x4 hole 1x2.7: 5(-5.7,-1.4) 6(5.7,-1.4)

## Nets
GND: C1.1 C2.1 C3.1 C4.1 C5.1 C8.1 H？1.2 LED1.2 LED2.2 SW1.1 U2.1 U3.1 U3#2.1 U3#3.1 U3#4.1 U3#5.3 U3#5.5 U3#5.21 USB1.4 USB1.5 USB1.6 USB-C2.3 USB-C2.4 USB-C2.A1 USB-C2.A12 USB-C2.B1 USB-C2.B12
VCC: C4.2 C5.2 D1.1 USB-C2.A4 USB-C2.A9 USB-C2.B4 USB-C2.B9
+5: D1.2 H？1.1 R1.2 R3.2 R4.2 R5.2 U2.16 U3#5.4 U3#5.6 U3#5.18 USB1.1
A0: U3#5.23
A1: U3#5.24
A2: U3#5.25
A3: U3#5.26
A4: H？1.4 U3#5.27
A5: H？1.3 U3#5.28
A6: U3#5.19
A7: U3#5.22
AREF: C3.2 U3#5.20
CH340D+: U2.5 USB-C2.A6 USB-C2.B6
CH340D-: U2.6 USB-C2.A7 USB-C2.B7
D0/RX: LED4.2 U2.2 U3#5.30
D1/TX: LED3.2 U2.3 U3#5.31
D2: U3#5.32
D3: U3.2 U3#2.2 U3#3.2 U3#4.2 U3#5.1
D4: U3#5.2
D5: NOREF.1 U3#5.9
D6: NOREF#2.2 U3#5.10
D7: NOREF#5.33 U3#5.11
D8: NOREF#7.34 U3#5.12
D9: NOREF#6.35 U3#5.13
D10: NOREF#3.36 U3#5.14
D11: NOREF#8.37 U3#5.15
D12: NOREF#4.38 U3#5.16
D13: R2.2 U3#5.17
RESET: C6.1 R1.1 SW1.2 U3#5.29
$2N83: C8.2 U2.4
$2N99: LED1.1 R2.1
$2N104: LED2.1 R3.1
$2N105: LED3.1 R4.1
$2N106: LED4.1 R5.1
$2N165: C1.2 U3#5.8 X1.1
$2N166: C2.2 U3#5.7 X1.2
$2N207: C6.2 U2.13

Pads without a net: U2 7 8 9 10 11 12 14 15; USB1 2 3; USB-C2 0 1 2 5 A5 A8 B5 B8

## Via types
v1: diameter 0.61, hole 0.305, Top Layer to Bottom Layer, 27 vias

## Routing (per net, layer and track width the routed paths; a pad name or vN(x,y) marks a point on that pad's centre or on a via; arc(x,y) is an arc through that point)
GND:
  vias: v1(9.16,25.27) v1(16.64,74.04) v1(40.15,14.48) v1(43.2,17.02) v1(43.45,22.1) v1(45.92,27.99) v1(61.81,76.24) v1(71.93,41.66)
VCC: length 37.2
  Top Layer w0.254: v1(30.51,8) 30.51,30.09
  Bottom Layer w0.254: 29.29,35.1 27.54,33.35 D1.1 27.54,32.62 30.06,30.1 v1(30.5,30.1) ; 30.31,6.54 30.31,6.03 31.12,5.21 34.31,5.21 35.01,5.91 USB-C2.B9 ; USB-C2.B4 v1(30.51,8)
+5:
  vias: v1(31.13,22.73) v1(32.27,32.89) v1(46.5,23.62) v1(52.59,16.51)
A4: length 35.4
  Top Layer w0.254: v1(51.54,31.68) 61.36,21.87 H？1.4
  Bottom Layer w0.254: 48.82,31.68 v1(51.54,31.68)
A5: length 33.2
  Top Layer w0.254: v1(50.89,30.88) 58.82,22.95 H？1.3
  Bottom Layer w0.254: 48.82,30.88 v1(50.89,30.88)
D3:
  vias: v1(6.46,25.27) v1(14.04,74.04) v1(48.78,25.65) v1(54.75,24.38) v1(59.21,76.24) v1(69.23,41.66)
D13: length 23.1
  Top Layer w0.254: v1(41.54,35.94) 52.09,25.4
  Bottom Layer w0.254: v1(41.54,35.94) 41.92,35.57 41.92,34.58 ; R2.2 51.43,19.16 52.09,19.81 v1(52.09,25.27)
RESET: length 50.4
  Top Layer w0.254: v1(26.94,8.26) 29.35,8.26 33.92,3.68 SW1.2 ; v1(33.83,22.99) 40.18,29.34 v1(46.88,29.34)
  Bottom Layer w0.254: v1(26.94,8.26) 26.94,22.01 R1.1 C6.1 33.18,23.64 v1(33.83,22.99) ; v1(46.88,29.34) 47.62,30.08 48.82,30.08
AREF: length 3.4
  Bottom Layer w0.254: C3.2 44.08,38.09 44.08,37.34 44.34,37.08 44.34,34.8
CH340D+: length 12.2
  Bottom Layer w0.254: USB-C2.B6 32.02,6.68 32.02,8 33.01,8.99 33.01,9.04 ; USB-C2.A6 33.01,9.5 33.67,10.16 33.67,12.95 34.43,13.72 34.43,14.48 35.07,15.11 35.19,15.11
CH340D-: length 10
  Bottom Layer w0.254: 32.53,6.22 32.53,5.84 32.65,5.72 33.29,5.72 33.54,5.97 33.54,6.35 ; USB-C2.B7 33.51,9.36 34.18,10.03 34.18,12.83 35.32,13.97
D0/RX: length 43.1
  Bottom Layer w0.254: 35.34,19.05 34.31,19.05 33.92,18.67 33.92,17.53 34.31,17.15 40.02,17.15 42.18,14.99 42.18,13.72 43.32,12.57 ; 43.32,12.57 43.5,12.57 ; 43.32,12.57 LED4.2 44.7,12.57 45.78,13.66 45.78,17.57 46.12,17.91 51.45,17.91 53.36,19.81 53.36,27.05 51.13,29.28 48.82,29.28
D1/TX: length 29.6
  Bottom Layer w0.254: 35.6,17.78 41.34,17.78 44.07,15.05 ; 40.7,17.78 44.78,17.78 45.78,18.79 45.78,19.99 51.83,26.04 51.83,27.31 50.66,28.48 48.82,28.48
$2N83: length 3.4
  Bottom Layer w0.254: U2.4 37.92,16.51 C8.2
$2N99: length 2.8
  Bottom Layer w0.254: 47.05,19.05 47.16,19.16 R2.1
$2N104: length 2.8
  Bottom Layer w0.254: R3.1 47.05,16.89
$2N105: length 3.2
  Bottom Layer w0.254: 46.62,14.73 46.68,14.79 49.81,14.79
$2N106: length 2.8
  Bottom Layer w0.254: R5.1 47.05,12.57
$2N165: length 7.8
  Bottom Layer w0.254: 38.58,20 38.58,22.04 39.95,23.41 C1.2 ; 39.95,24.06 40.34,24.06 41.42,25.15 41.67,25.15 41.93,25.4 41.93,26.16
$2N166: length 6.8
  Bottom Layer w0.254: C2.2 41.44,22.71 42.08,22.07 42.08,20 ; 41.59,23.94 41.59,24.17 42.69,25.27 42.69,26.04
$2N207: length 6.8
  Bottom Layer w0.254: 30.28,16.51 30.75,16.51 31.51,17.27 31.51,21.83 C6.2

## Text on the board
Bottom Silkscreen Layer: D11 | D9 | D7 | D12 | D6 | D10 | D5
Top Layer: VCC GND SCL SDA
Top Solder Mask Layer: VCC GND SCL SDA

# Board pcb
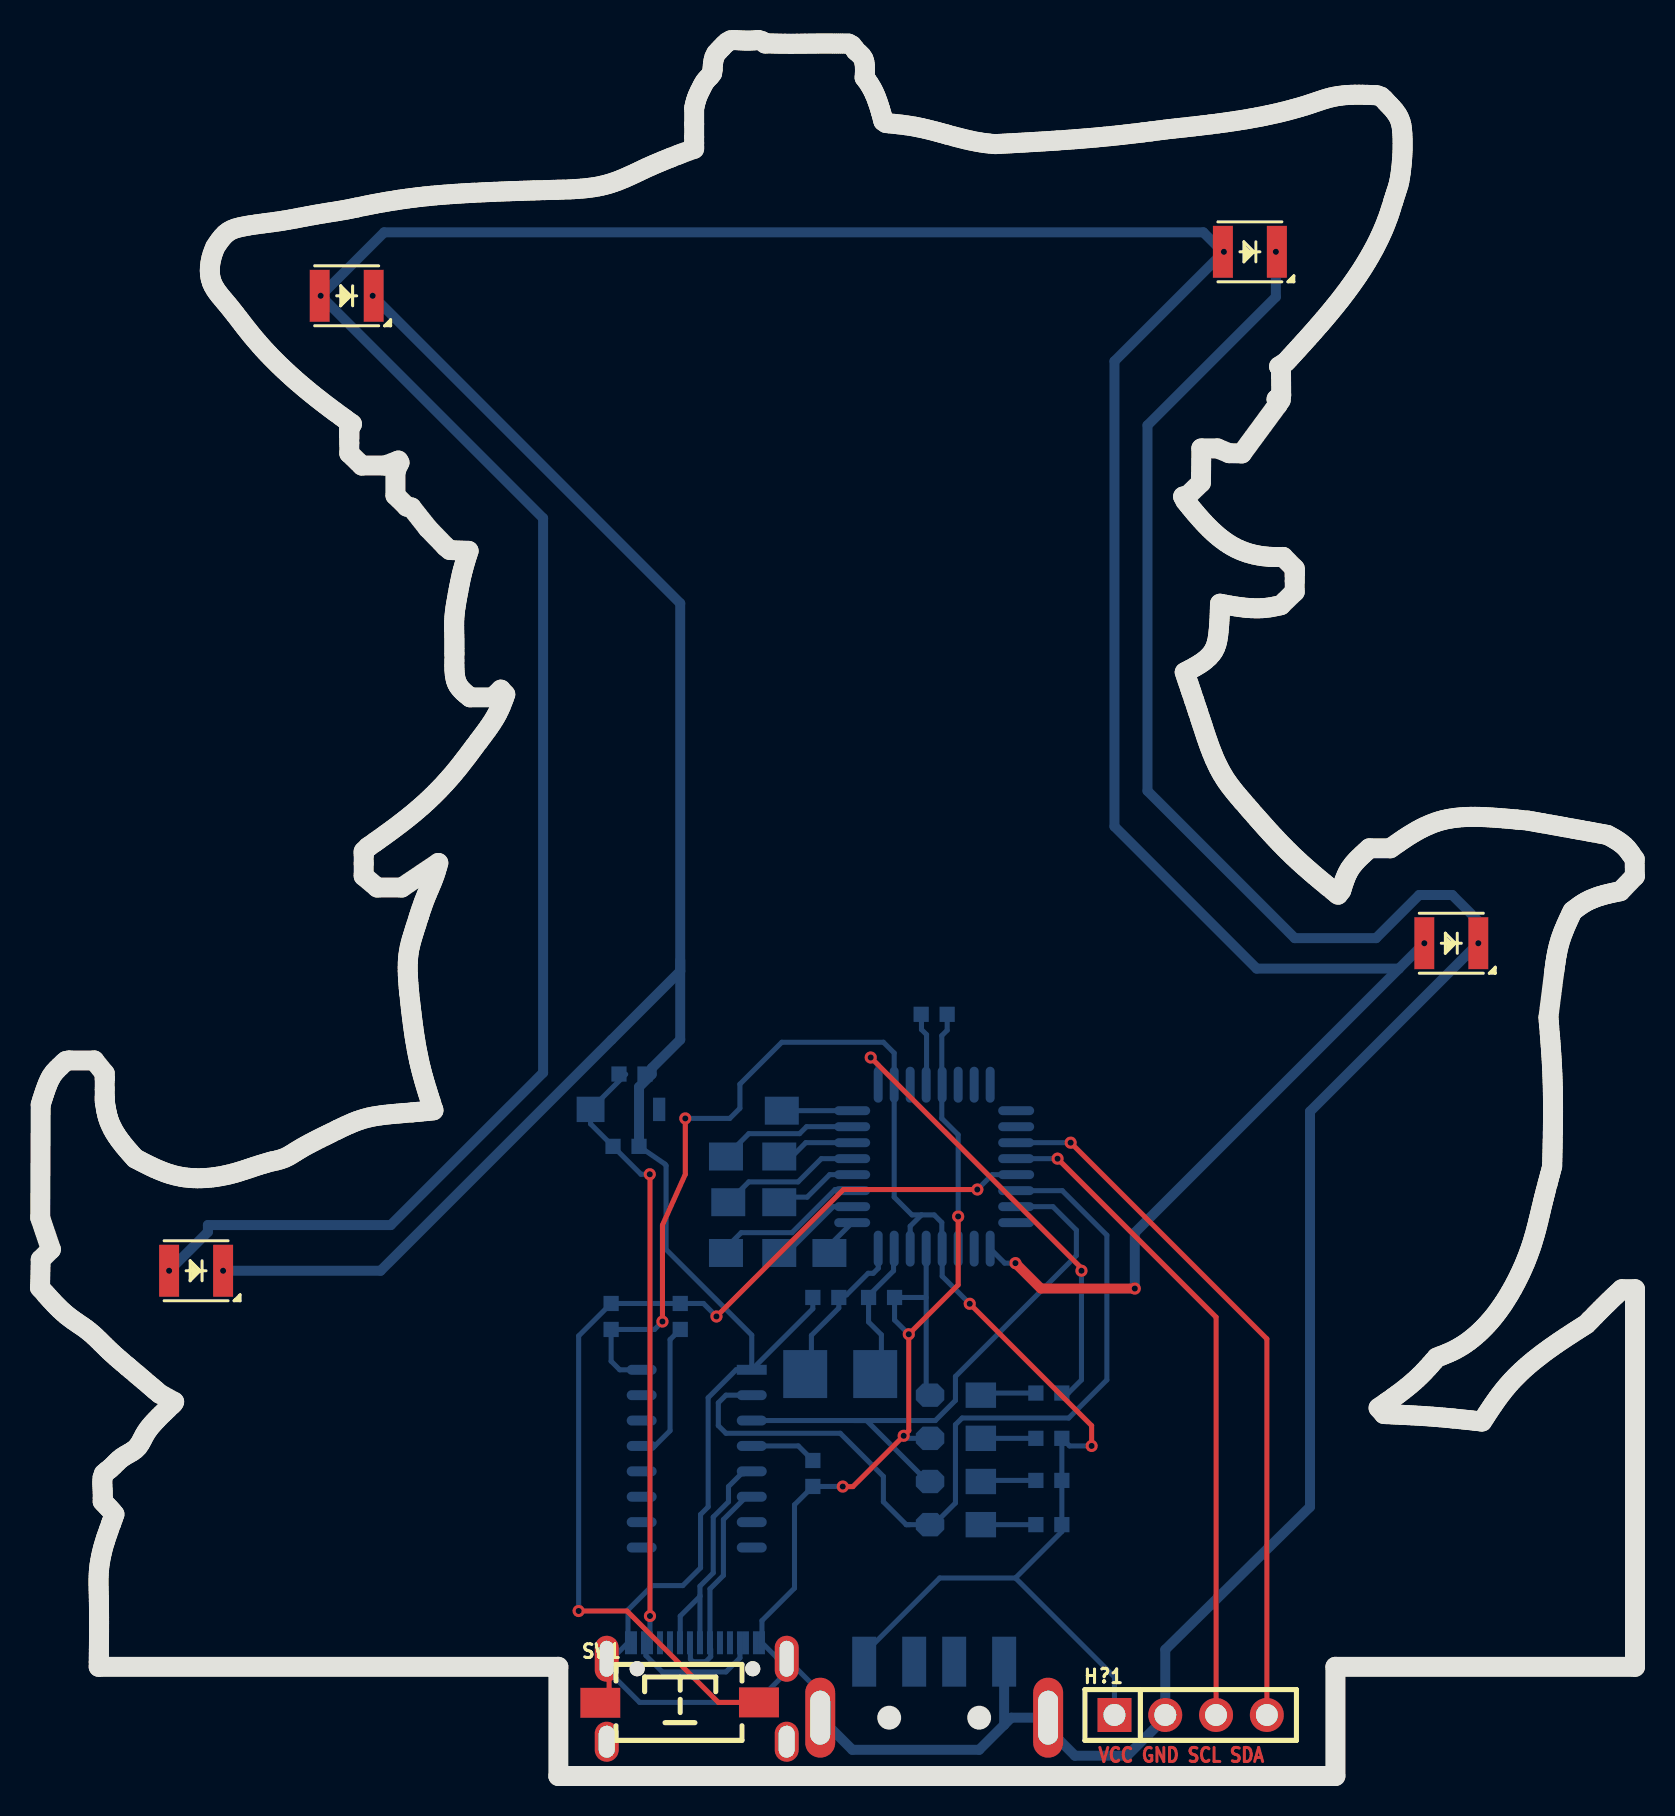
[diagram p12: board, top side]
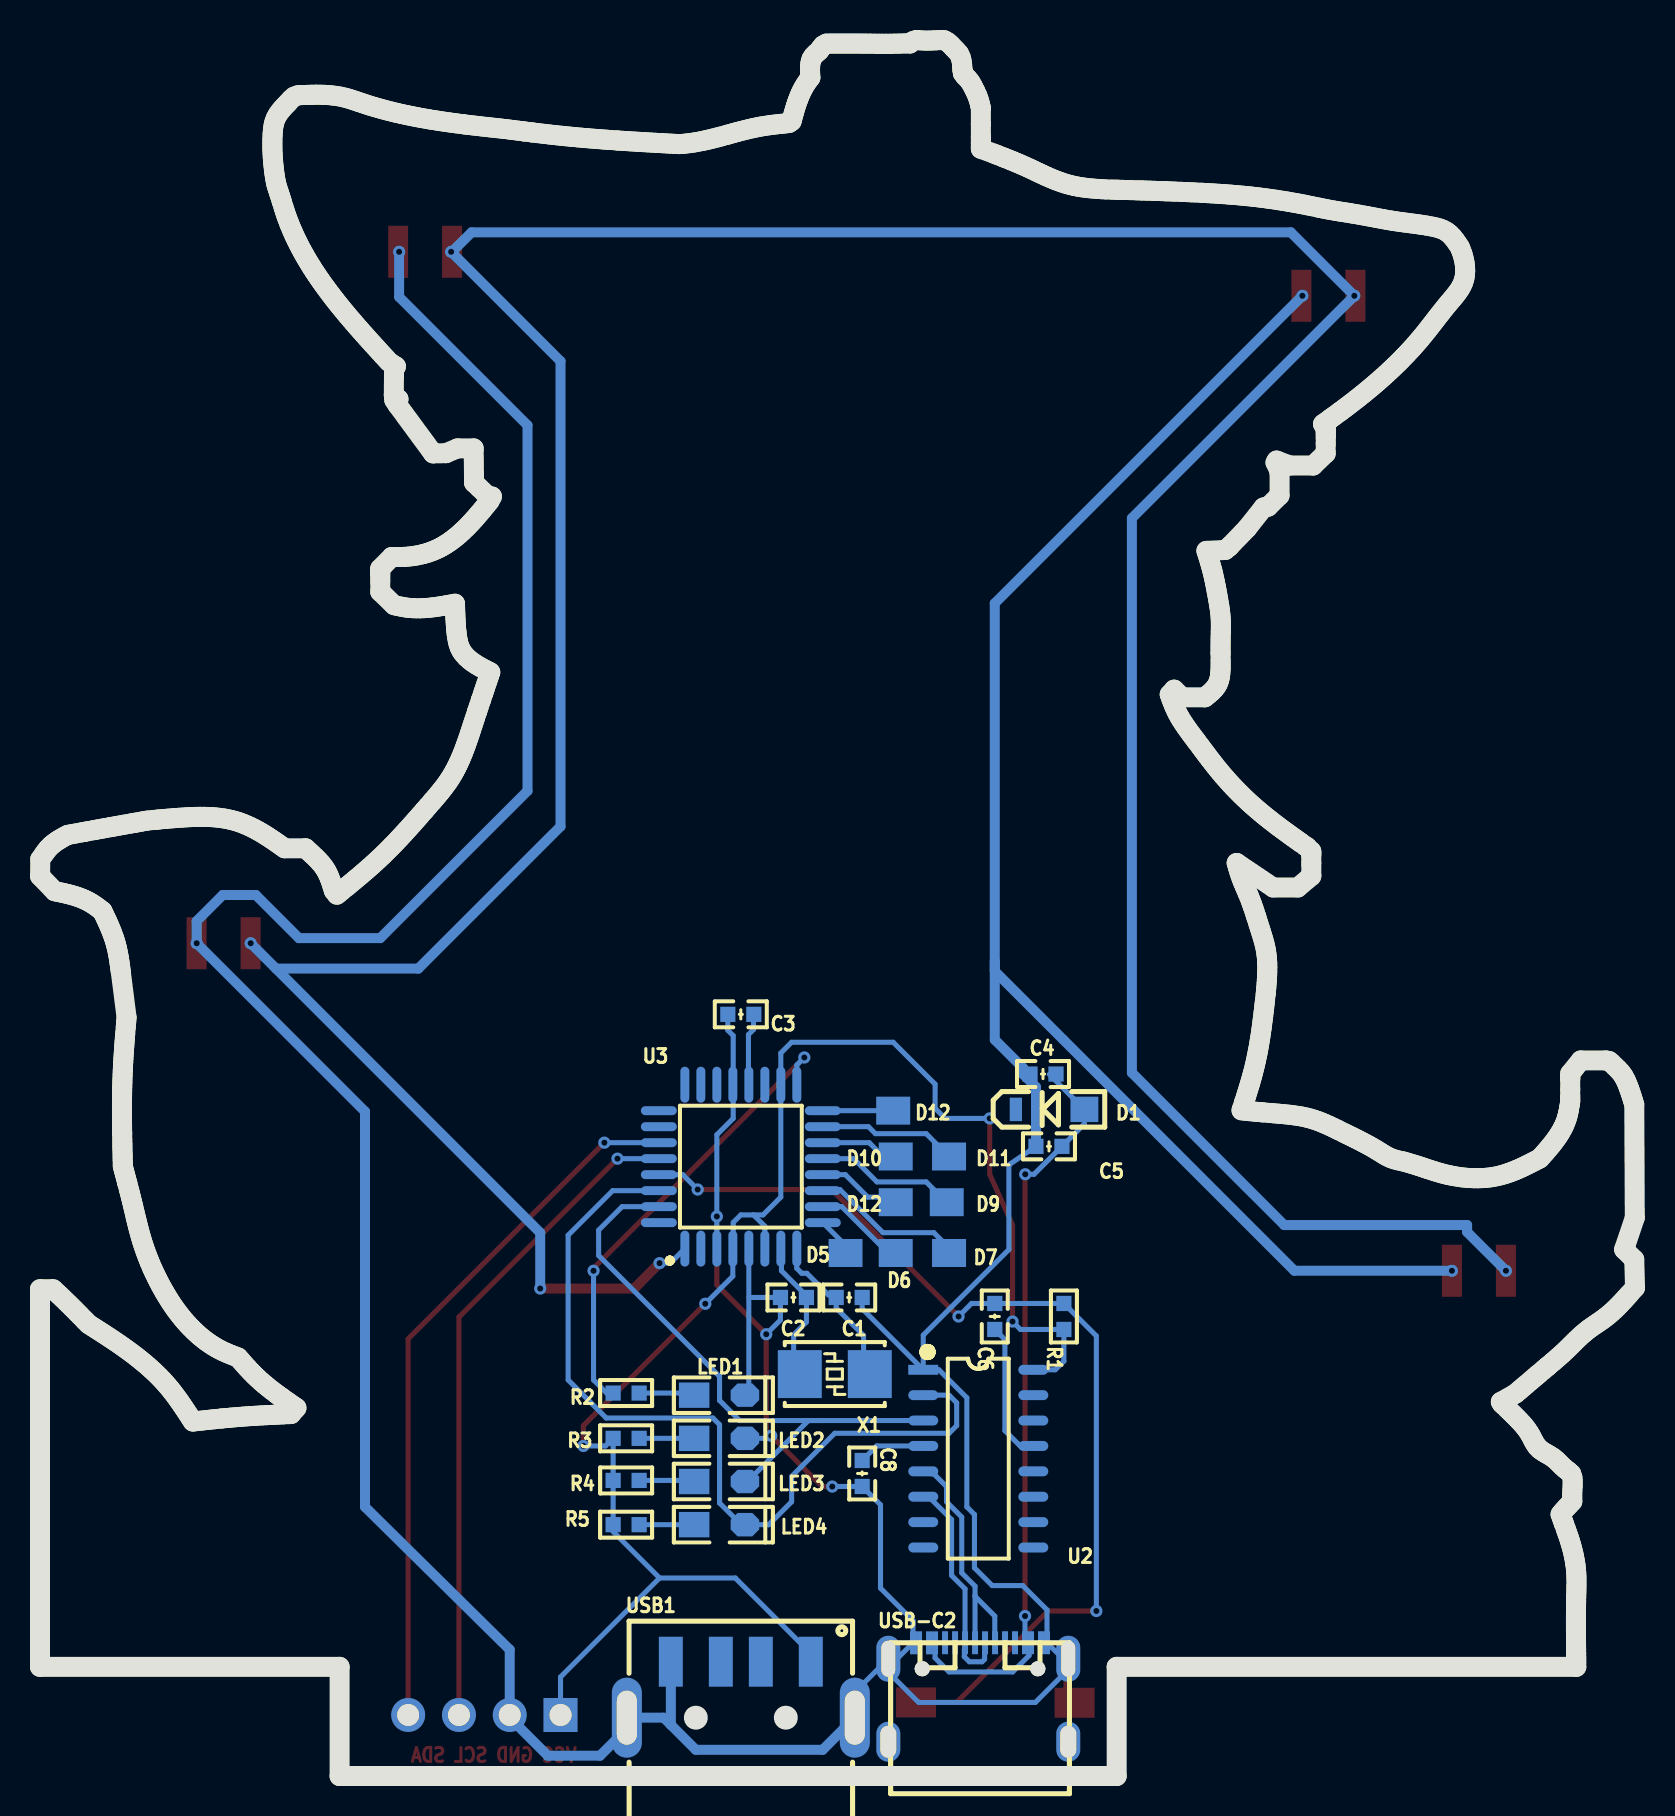
[diagram p13: board, bottom side, seen from below]

Outline 79.77 x 86.84 mm; copper layers: Top Layer, Bottom Layer. Coordinates in mm from the lower left corner of the outline.
Stack: Top Layer 0.012mm / Dielectric1 0.025mm FR4 er 4.5 / Bottom Layer 0.012mm

## Design rules (mm)
template: 用户自定义配置
spacing Default (default): track to track 0.152, other pairs 0 to 0.152
track width Default (default): min 0.254, default 0.254, max 25.4
differential pair differentialPair (default): width min 0.127, default 0.254, max 2.54; gap min 0.152, default 0.152
via Default (default): diameter min 0.61, default 0.61, max 100.025; hole min 0.305, default 0.305, max 59.995

## Placement (name value [footprint] x y rotation side)
C1  22pF  [C 0603_L]  39.3 23.94 180 bottom
C2  22pF  [C 0603_L]  42.09 23.94 0 bottom
C3  100nF  [C 0603_L]  44.72 38.1 0 bottom
C4  0.1uF  [C 0603_L]  29.61 35.11 0 bottom
C5  4.7uF  [C 0603_L]  29.31 31.5 0 bottom
C6  100nF  [C 0603_L]  32.02 22.99 90 bottom
C8  100nF  [C 0603_L]  38.65 15.13 270 bottom
D1  SS26  [SOD-123]  29.25 33.35 180 bottom
H？1  -  [HDR-TH_4P-P2.54-V-F]  57.55 3.05 0 top
LED1  LED-RED  [LED 0805]  45.78 19.05 180 bottom
LED2  LED-RED  [LED 0805]  45.78 16.89 180 bottom
LED3  LED-BLUE  [LED 0805B]  45.78 14.73 180 bottom
LED4  LED-YELLOW  [LED 0805Y]  45.78 12.57 180 bottom
NOREF  -  [Pad_e96]  36.97 26.16 0 top
NOREF#2  -  [Pad_e108]  36.97 28.7 0 top
NOREF#3  -  [Pad_e100]  34.31 26.16 0 top
NOREF#4  -  [Pad_e117]  34.42 28.7 0 top
NOREF#5  -  [Pad_e137]  37.1 33.28 0 top
NOREF#6  -  [Pad_e133]  34.31 30.99 0 top
NOREF#7  -  [Pad_e124]  36.97 30.99 0 top
NOREF#8  -  [Pad_e84]  39.48 26.16 0 top
R1  1K  [R 0603_L#2]  28.56 22.99 90 bottom
R2  1K  [R 0603_L]  50.45 19.16 0 bottom
R3  1K  [R 0603_L]  50.45 16.89 0 bottom
R4  1K  [R 0603_L]  50.45 14.79 0 bottom
R5  1K  [R 0603_L]  50.45 12.57 0 bottom
SW1  3x6x5  [TSW SMD-3*6*2.5]  32.02 3.68 0 top
U2  CH340C  [SOP16_L]  32.84 15.88 0 bottom
U3  -  [LED-SMD_L3.5-W2.8-LS3.6-RD]  15.34 74.04 180 top
U3#2  -  [LED-SMD_L3.5-W2.8-LS3.6-RD]  70.58 41.66 180 top
U3#3  -  [LED-SMD_L3.5-W2.8-LS3.6-RD]  60.51 76.24 180 top
U3#4  -  [LED-SMD_L3.5-W2.8-LS3.6-RD]  7.81 25.27 180 top
U3#5  -  [TQFP32-7*7]  44.72 30.48 180 bottom
USB1  U217-041N-4BV81  [USB-A-SMD_U217-041N-4BV81]  44.72 4.32 180 bottom
USB-C2  USB-C  [TYPE-C-USB-5]  32.84 4.19 180 bottom
X1  16MHz  [OSC 5032-2P]  40.02 20.11 180 bottom

## Footprints (pads in the part's own frame, mm; a bottom-side part is the same pattern mirrored in y, then rotated)
C 0603_L
  rect 0.762x0.762 smd: 1(0.65,0) 2(-0.65,0)
HDR-TH_4P-P2.54-V-F
  rect 1.7x1.7 hole 1.1: 1(-3.81,0)
  round 1.7 hole 1.1: 2(-1.27,0) 3(1.27,0) 4(3.81,0)
LED 0805
  rect 1.524x1.27 smd: 1(-1.27,0)
  custom 1.427x1.173 smd: 2(1.27,0)
LED 0805B
  rect 1.524x1.27 smd: 1(-1.27,0)
  custom 1.427x1.173 smd: 2(1.27,0)
LED 0805Y
  rect 1.524x1.27 smd: 1(-1.27,0)
  custom 1.427x1.173 smd: 2(1.27,0)
LED-SMD_L3.5-W2.8-LS3.6-RD
  rect 1x2.6 smd: 1(-1.35,0) 2(1.35,0)
OSC 5032-2P
  rect 2.2x2.4 smd: 1(1.75,0) 2(-1.75,0)
Pad_e84
  rect 1.7x1.4 smd far side: 1(0,0)
Pad_e96
  rect 1.7x1.4 smd far side: 2(0,0)
Pad_e100
  rect 1.7x1.4 smd far side: 33(0,0)
Pad_e108
  rect 1.7x1.4 smd far side: 34(0,0)
Pad_e117
  rect 1.7x1.4 smd far side: 35(0,0)
Pad_e124
  rect 1.7x1.4 smd far side: 36(0,0)
Pad_e133
  rect 1.7x1.4 smd far side: 37(0,0)
Pad_e137
  rect 1.7x1.4 smd far side: 38(0,0)
R 0603_L
  rect 0.762x0.762 smd: 1(-0.65,0) 2(0.65,0)
R 0603_L#2
  rect 0.762x0.762 smd: 1(0.65,0) 2(-0.65,0)
SOD-123
  rect 1.397x1.27 smd: 1(1.714,0)
  custom 0.613x1.173 smd: 2(-1.714,0)
SOP16_L
  rect 1.5x0.5 smd: 1(2.752,-4.445)
  oval 1.5x0.5 smd: 2(2.752,-3.175) 3(2.752,-1.905) 4(2.752,-0.635) 5(2.752,0.635) 6(2.752,1.905) 7(2.752,3.175) 8(2.752,4.445) 9(-2.752,4.445) 10(-2.752,3.175) 11(-2.752,1.905) 12(-2.752,0.635) 13(-2.752,-0.635) 14(-2.752,-1.905) 15(-2.752,-3.175) 16(-2.752,-4.445)
TQFP32-7*7
  oval 0.45x1.8 smd: 1(-2.803,-4.1) 2(-2.002,-4.1) 3(-1.202,-4.1) 4(-0.403,-4.1) 5(0.398,-4.1) 6(1.198,-4.1) 7(1.998,-4.1) 8(2.797,-4.1) 17(2.797,4.1) 18(1.998,4.1) 19(1.198,4.1) 20(0.398,4.1) 21(-0.403,4.1) 22(-1.202,4.1) 23(-2.002,4.1) 24(-2.803,4.1)
  oval 1.8x0.45 smd: 9(4.098,-2.8) 10(4.098,-2) 11(4.098,-1.2) 12(4.098,-0.4) 13(4.098,0.4) 14(4.098,1.2) 15(4.098,2) 16(4.098,2.8) 25(-4.103,2.8) 26(-4.103,2) 27(-4.103,1.2) 28(-4.103,0.4) 29(-4.103,-0.4) 30(-4.103,-1.2) 31(-4.103,-2) 32(-4.103,-2.8)
TSW SMD-3*6*2.5
  rect 2x1.5 smd: 1(-3.996,-0.02) 2(3.937,0)
TYPE-C-USB-5
  oval 1.2x2 hole 0.8x1.6: 0(-4.5,-2.475) 2(4.5,-2.475)
  round 0.75 hole 0.75: 1(2.978,1.175) 5(-2.803,1.175)
  oval 1.2x2.3 hole 0.7x1.8: 3(4.5,1.675) 4(-4.5,1.675)
  rect 0.3x1.15 smd: A1(-3.263,2.474) A4(-2.462,2.471) A5(-1.163,2.475) A6(-0.163,2.475) A7(0.338,2.474) A8(1.337,2.475) A9(2.638,2.475) A12(3.438,2.475) B1(3.138,2.475) B4(2.337,2.475) B5(1.837,2.475) B6(0.838,2.475) B7(-0.662,2.474) B8(-1.663,2.475) B9(-2.163,2.471) B12(-2.962,2.474)
USB-A-SMD_U217-041N-4BV81
  rect 1.2x2.5 smd: 1(3.5,1.4) 2(1,1.4) 3(-1,1.4) 4(-3.5,1.4)
  oval 1.5x4 hole 1x2.7: 5(-5.7,-1.4) 6(5.7,-1.4)

## Nets
GND: C1.1 C2.1 C3.1 C4.1 C5.1 C8.1 H？1.2 LED1.2 LED2.2 SW1.1 U2.1 U3.1 U3#2.1 U3#3.1 U3#4.1 U3#5.3 U3#5.5 U3#5.21 USB1.4 USB1.5 USB1.6 USB-C2.3 USB-C2.4 USB-C2.A1 USB-C2.A12 USB-C2.B1 USB-C2.B12
VCC: C4.2 C5.2 D1.1 USB-C2.A4 USB-C2.A9 USB-C2.B4 USB-C2.B9
+5: D1.2 H？1.1 R1.2 R3.2 R4.2 R5.2 U2.16 U3#5.4 U3#5.6 U3#5.18 USB1.1
A0: U3#5.23
A1: U3#5.24
A2: U3#5.25
A3: U3#5.26
A4: H？1.4 U3#5.27
A5: H？1.3 U3#5.28
A6: U3#5.19
A7: U3#5.22
AREF: C3.2 U3#5.20
CH340D+: U2.5 USB-C2.A6 USB-C2.B6
CH340D-: U2.6 USB-C2.A7 USB-C2.B7
D0/RX: LED4.2 U2.2 U3#5.30
D1/TX: LED3.2 U2.3 U3#5.31
D2: U3#5.32
D3: U3.2 U3#2.2 U3#3.2 U3#4.2 U3#5.1
D4: U3#5.2
D5: NOREF#8.1 U3#5.9
D6: NOREF.2 U3#5.10
D7: NOREF#3.33 U3#5.11
D8: NOREF#2.34 U3#5.12
D9: NOREF#4.35 U3#5.13
D10: NOREF#7.36 U3#5.14
D11: NOREF#6.37 U3#5.15
D12: NOREF#5.38 U3#5.16
D13: R2.2 U3#5.17
RESET: C6.1 R1.1 SW1.2 U3#5.29
$2N83: C8.2 U2.4
$2N99: LED1.1 R2.1
$2N104: LED2.1 R3.1
$2N105: LED3.1 R4.1
$2N106: LED4.1 R5.1
$2N165: C1.2 U3#5.8 X1.1
$2N166: C2.2 U3#5.7 X1.2
$2N207: C6.2 U2.13

Pads without a net: U2 7 8 9 10 11 12 14 15; USB1 2 3; USB-C2 0 1 2 5 A5 A8 B5 B8

## Via types
v1: diameter 0.61, hole 0.305, Top Layer to Bottom Layer, 27 vias

## Routing (per net, layer and track width the routed paths; a pad name or vN(x,y) marks a point on that pad's centre or on a via; arc(x,y) is an arc through that point)
GND:
  vias: v1(9.16,25.27) v1(16.64,74.04) v1(40.15,14.48) v1(43.2,17.02) v1(43.45,22.1) v1(45.92,27.99) v1(61.81,76.24) v1(71.93,41.66)
VCC: length 37.2
  Top Layer w0.254: v1(30.51,8) 30.51,30.09
  Bottom Layer w0.254: 29.29,35.1 27.54,33.35 D1.1 27.54,32.62 30.06,30.1 v1(30.5,30.1) ; 30.31,6.54 30.31,6.03 31.12,5.21 34.31,5.21 35.01,5.91 USB-C2.B9 ; USB-C2.B4 v1(30.51,8)
+5:
  vias: v1(31.13,22.73) v1(32.27,32.89) v1(46.5,23.62) v1(52.59,16.51)
A4: length 35.4
  Top Layer w0.254: v1(51.54,31.68) 61.36,21.87 H？1.4
  Bottom Layer w0.254: 48.82,31.68 v1(51.54,31.68)
A5: length 33.2
  Top Layer w0.254: v1(50.89,30.88) 58.82,22.95 H？1.3
  Bottom Layer w0.254: 48.82,30.88 v1(50.89,30.88)
D3:
  vias: v1(6.46,25.27) v1(14.04,74.04) v1(48.78,25.65) v1(54.75,24.38) v1(59.21,76.24) v1(69.23,41.66)
D13: length 23.1
  Top Layer w0.254: v1(41.54,35.94) 52.09,25.4
  Bottom Layer w0.254: v1(41.54,35.94) 41.92,35.57 41.92,34.58 ; R2.2 51.43,19.16 52.09,19.81 v1(52.09,25.27)
RESET: length 50.4
  Top Layer w0.254: v1(26.94,8.26) 29.35,8.26 33.92,3.68 SW1.2 ; v1(33.83,22.99) 40.18,29.34 v1(46.88,29.34)
  Bottom Layer w0.254: v1(26.94,8.26) 26.94,22.01 R1.1 C6.1 33.18,23.64 v1(33.83,22.99) ; v1(46.88,29.34) 47.62,30.08 48.82,30.08
AREF: length 3.4
  Bottom Layer w0.254: C3.2 44.08,38.09 44.08,37.34 44.34,37.08 44.34,34.8
CH340D+: length 12.2
  Bottom Layer w0.254: USB-C2.B6 32.02,6.68 32.02,8 33.01,8.99 33.01,9.04 ; USB-C2.A6 33.01,9.5 33.67,10.16 33.67,12.95 34.43,13.72 34.43,14.48 35.07,15.11 35.19,15.11
CH340D-: length 10
  Bottom Layer w0.254: 32.53,6.22 32.53,5.84 32.65,5.72 33.29,5.72 33.54,5.97 33.54,6.35 ; USB-C2.B7 33.51,9.36 34.18,10.03 34.18,12.83 35.32,13.97
D0/RX: length 43.1
  Bottom Layer w0.254: 35.34,19.05 34.31,19.05 33.92,18.67 33.92,17.53 34.31,17.15 40.02,17.15 42.18,14.99 42.18,13.72 43.32,12.57 ; 43.32,12.57 43.5,12.57 ; 43.32,12.57 LED4.2 44.7,12.57 45.78,13.66 45.78,17.57 46.12,17.91 51.45,17.91 53.36,19.81 53.36,27.05 51.13,29.28 48.82,29.28
D1/TX: length 29.6
  Bottom Layer w0.254: 35.6,17.78 41.34,17.78 44.07,15.05 ; 40.7,17.78 44.78,17.78 45.78,18.79 45.78,19.99 51.83,26.04 51.83,27.31 50.66,28.48 48.82,28.48
$2N83: length 3.4
  Bottom Layer w0.254: U2.4 37.92,16.51 C8.2
$2N99: length 2.8
  Bottom Layer w0.254: 47.05,19.05 47.16,19.16 R2.1
$2N104: length 2.8
  Bottom Layer w0.254: R3.1 47.05,16.89
$2N105: length 3.2
  Bottom Layer w0.254: 46.62,14.73 46.68,14.79 49.81,14.79
$2N106: length 2.8
  Bottom Layer w0.254: R5.1 47.05,12.57
$2N165: length 7.8
  Bottom Layer w0.254: 38.58,20 38.58,22.04 39.95,23.41 C1.2 ; 39.95,24.06 40.34,24.06 41.42,25.15 41.67,25.15 41.93,25.4 41.93,26.16
$2N166: length 6.8
  Bottom Layer w0.254: C2.2 41.44,22.71 42.08,22.07 42.08,20 ; 41.59,23.94 41.59,24.17 42.69,25.27 42.69,26.04
$2N207: length 6.8
  Bottom Layer w0.254: 30.28,16.51 30.75,16.51 31.51,17.27 31.51,21.83 C6.2

## Text on the board
Bottom Silkscreen Layer: D11 | D9 | D7 | D12 | D6 | D10 | D5
Top Layer: VCC GND SCL SDA
Top Solder Mask Layer: VCC GND SCL SDA

# Board PCB4_2
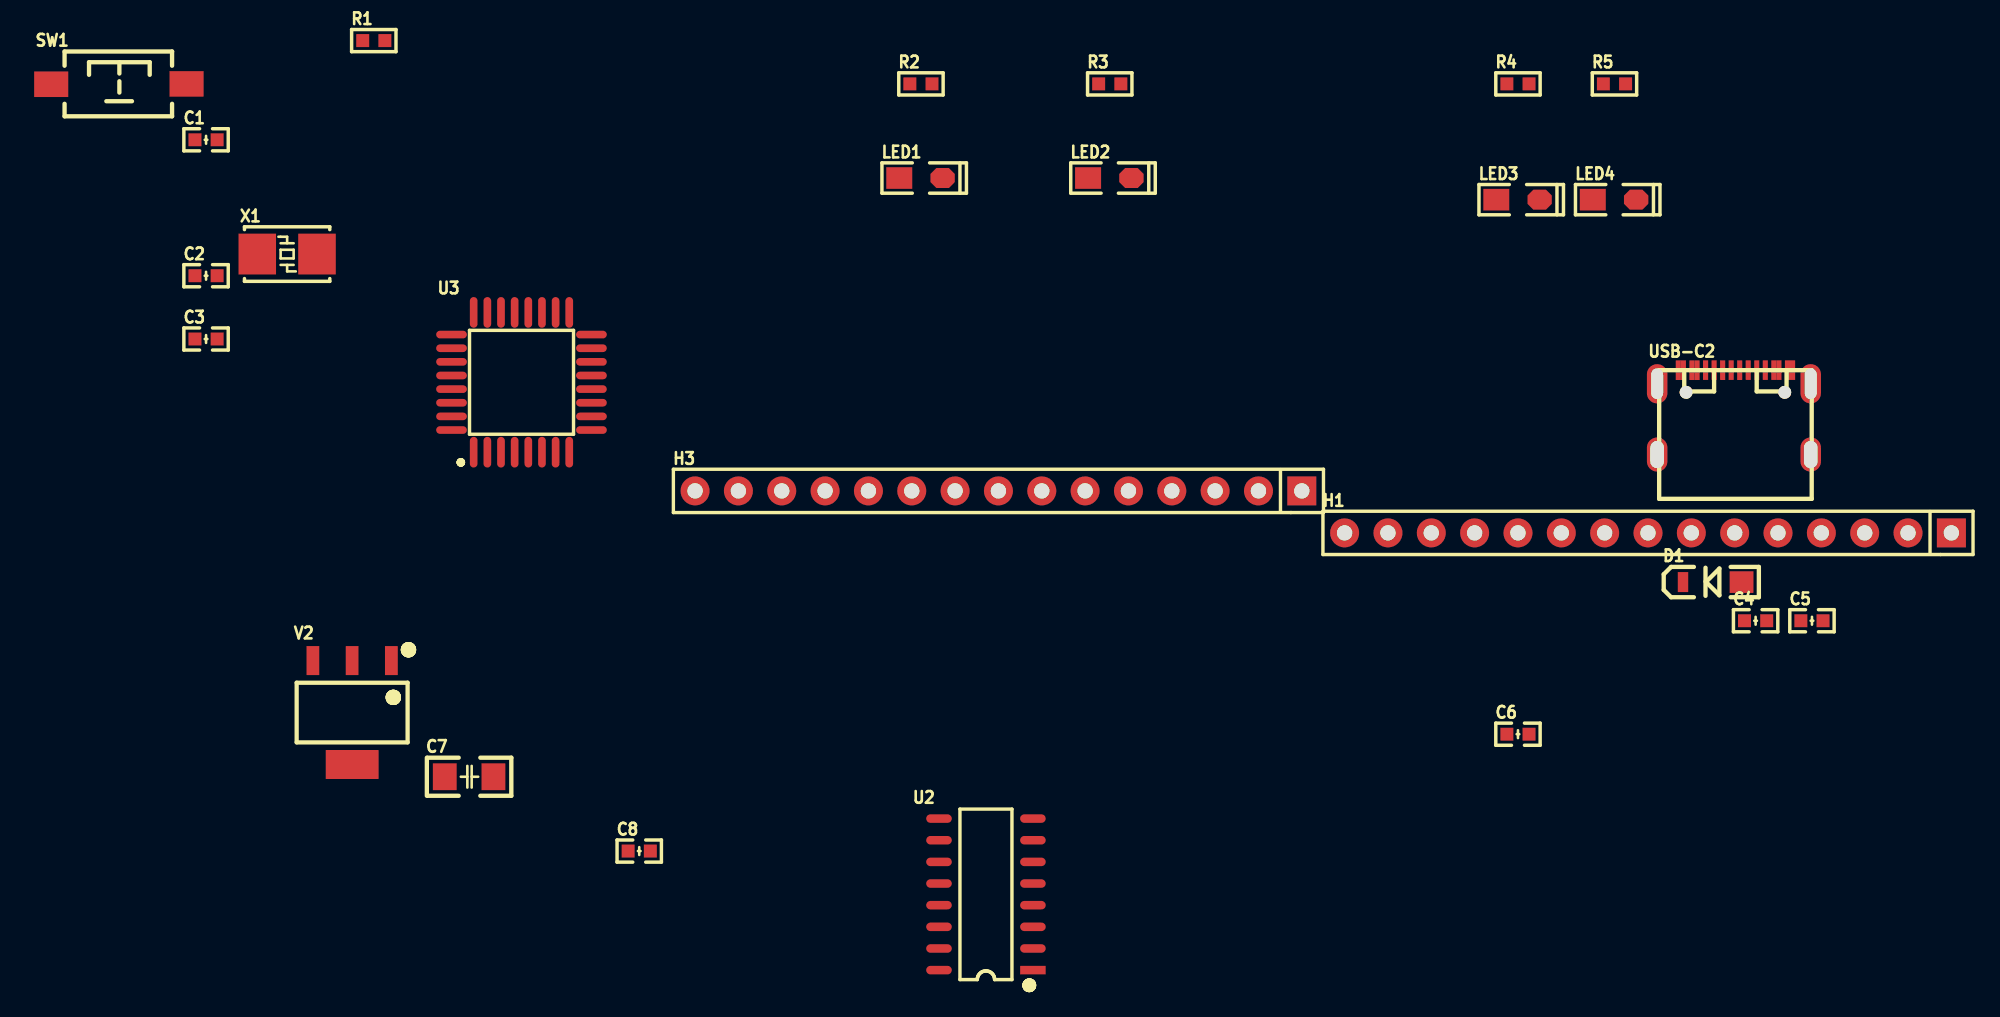
[diagram p14: board, top side]
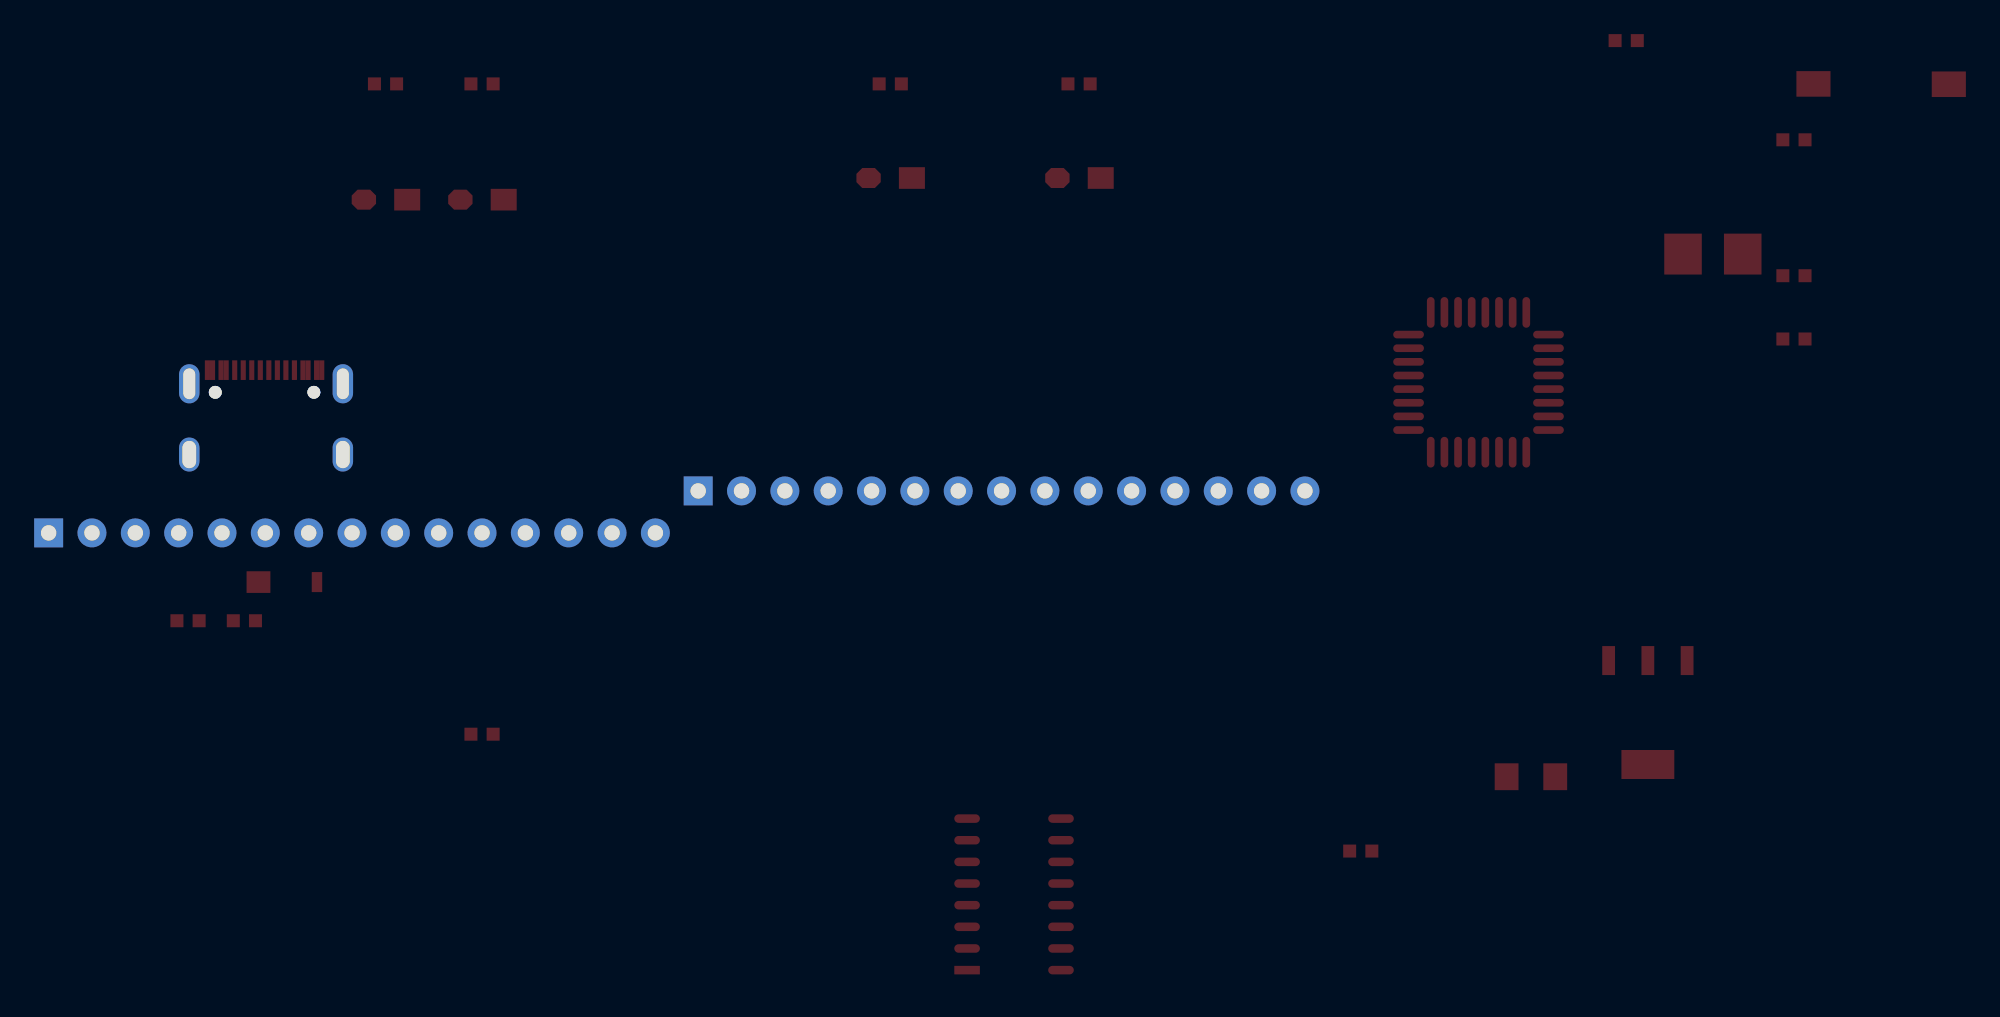
[diagram p15: board, bottom side, seen from below]

No outline. copper layers: Top Layer, Bottom Layer. Coordinates in mm from the lowest, leftmost part position.
Stack: Top Layer 0.035mm / Dielectric1 1.51mm FR4 er 4.5 / Bottom Layer 0.035mm

## Design rules (mm)
template: JLCPCB Capability(Two Layers Board)
spacing copperThickness1oz (default): track to track 0.102, other pairs 0.152 to 0.3
spacing copperThickness2oz: track to track 0.203, other pairs 0.152 to 0.3
track width copperThickness1oz (default): min 0.127, default 0.254, max 2.54
track width copperThickness2oz: min 0.203, default 0.254, max 2.54
differential pair differentialPair (default): width min 0.127, default 0.254, max 2.54; gap min 0.152, default 0.152
via viaSize (default): diameter min 0.5, default 0.61, max 10; hole min 0.3, default 0.305, max 6.3

## Placement (name value [footprint] x y rotation side)
C1  22pF  [C 0603_L]  5.08 44.26 0 top
C2  22pF  [C 0603_L]  5.08 36.29 0 top
C3  100nF  [C 0603_L]  5.08 32.58 0 top
C4  0.1uF  [C 0603_L]  95.89 16.05 0 top
C5  4.7uF  [C 0603_L]  99.2 16.05 0 top
C6  100nF  [C 0603_L]  81.97 9.4 0 top
C7  10uF  [C 1206_L]  20.52 6.9 0 top
C8  100nF  [C 0603_L]  30.47 2.54 0 top
D1  SS26  [SOD-123]  93.35 18.32 0 top
H1  HEADER 1X15  [HDR2.54-LI-15P]  89.59 21.2 0 top
H3  HEADER 1X15  [HDR2.54-LI-15P]  51.52 23.67 0 top
LED1  LED-RED  [LED 0805]  46.98 42.02 0 top
LED2  LED-RED  [LED 0805]  58.04 42.02 0 top
LED3  LED-BLUE  [LED 0805B]  81.97 40.75 0 top
LED4  LED-YELLOW  [LED 0805Y]  87.62 40.75 0 top
R1  1K  [R 0603_L#2]  14.91 50.08 0 top
R2  1K  [R 0603_L]  46.98 47.54 0 top
R3  1K  [R 0603_L]  58.04 47.54 0 top
R4  1K  [R 0603_L]  81.97 47.54 0 top
R5  1K  [R 0603_L]  87.62 47.54 0 top
SW1  3x6x5  [TSW SMD-3*6*2.5]  0 47.54 0 top
U2  CH340C  [SOP16_L]  50.79 0 0 top
U3  MEGA328P  [TQFP32-7*7]  23.57 30.04 0 top
USB-C2  USB-C  [TYPE-C-USB-5]  94.62 28.28 0 top
V2  -  [AMS1117]  13.64 10.67 0 top
X1  16MHz  [OSC 5032-2P]  9.83 37.56 0 top

## Footprints (pads in the part's own frame, mm; a bottom-side part is the same pattern mirrored in y, then rotated)
AMS1117
  rect 0.75x1.7 smd: 1(2.3,3.048) 2(0,3.048) 3(-2.3,3.048)
  rect 3.1x1.7 smd: 4(0,-3.048)
C 0603_L
  rect 0.762x0.762 smd: 1(0.65,0) 2(-0.65,0)
C 1206_L
  rect 1.397x1.575 smd: 1(1.4,0) 2(-1.45,0)
HDR2.54-LI-15P
  rect 1.7x1.7 hole 0.9: 1(17.78,0)
  round 1.7 hole 0.9: 2(15.24,0) 3(12.7,0) 4(10.16,0) 5(7.62,0) 6(5.08,0) 7(2.54,0) 8(0,0) 9(-2.54,0) 10(-5.08,0) 11(-7.62,0) 12(-10.16,0) 13(-12.7,0) 14(-15.24,0) 15(-17.78,0)
LED 0805
  rect 1.524x1.27 smd: 1(-1.27,0)
  custom 1.427x1.173 smd: 2(1.27,0)
LED 0805B
  rect 1.524x1.27 smd: 1(-1.27,0)
  custom 1.427x1.173 smd: 2(1.27,0)
LED 0805Y
  rect 1.524x1.27 smd: 1(-1.27,0)
  custom 1.427x1.173 smd: 2(1.27,0)
OSC 5032-2P
  rect 2.2x2.4 smd: 1(1.75,0) 2(-1.75,0)
R 0603_L
  rect 0.762x0.762 smd: 1(-0.65,0) 2(0.65,0)
R 0603_L#2
  rect 0.762x0.762 smd: 1(0.65,0) 2(-0.65,0)
SOD-123
  rect 1.397x1.27 smd: 1(1.714,0)
  custom 0.613x1.173 smd: 2(-1.714,0)
SOP16_L
  rect 1.5x0.5 smd: 1(2.752,-4.445)
  oval 1.5x0.5 smd: 2(2.752,-3.175) 3(2.752,-1.905) 4(2.752,-0.635) 5(2.752,0.635) 6(2.752,1.905) 7(2.752,3.175) 8(2.752,4.445) 9(-2.752,4.445) 10(-2.752,3.175) 11(-2.752,1.905) 12(-2.752,0.635) 13(-2.752,-0.635) 14(-2.752,-1.905) 15(-2.752,-3.175) 16(-2.752,-4.445)
TQFP32-7*7
  oval 0.45x1.8 smd: 1(-2.803,-4.1) 2(-2.002,-4.1) 3(-1.202,-4.1) 4(-0.403,-4.1) 5(0.398,-4.1) 6(1.198,-4.1) 7(1.998,-4.1) 8(2.797,-4.1) 17(2.797,4.1) 18(1.998,4.1) 19(1.198,4.1) 20(0.398,4.1) 21(-0.403,4.1) 22(-1.202,4.1) 23(-2.002,4.1) 24(-2.803,4.1)
  oval 1.8x0.45 smd: 9(4.098,-2.8) 10(4.098,-2) 11(4.098,-1.2) 12(4.098,-0.4) 13(4.098,0.4) 14(4.098,1.2) 15(4.098,2) 16(4.098,2.8) 25(-4.103,2.8) 26(-4.103,2) 27(-4.103,1.2) 28(-4.103,0.4) 29(-4.103,-0.4) 30(-4.103,-1.2) 31(-4.103,-2) 32(-4.103,-2.8)
TSW SMD-3*6*2.5
  rect 2x1.5 smd: 1(-3.996,-0.02) 2(3.937,0)
TYPE-C-USB-5
  oval 1.2x2 hole 0.8x1.6: 0(-4.5,-2.475) 2(4.5,-2.475)
  round 0.75 hole 0.75: 1(2.978,1.175) 5(-2.803,1.175)
  oval 1.2x2.3 hole 0.7x1.8: 3(4.5,1.675) 4(-4.5,1.675)
  rect 0.3x1.15 smd: A1(-3.263,2.474) A4(-2.462,2.471) A5(-1.163,2.475) A6(-0.163,2.475) A7(0.338,2.474) A8(1.337,2.475) A9(2.638,2.475) A12(3.438,2.475) B1(3.138,2.475) B4(2.337,2.475) B5(1.837,2.475) B6(0.838,2.475) B7(-0.662,2.474) B8(-1.663,2.475) B9(-2.163,2.471) B12(-2.962,2.474)

## Nets
As in the schematic.

Pads without a net: U2 7 8 9 10 11 12 14 15; USB-C2 0 1 2 3 4 5 A5 A8 B5 B8; V2 4

# Board PCB4_1
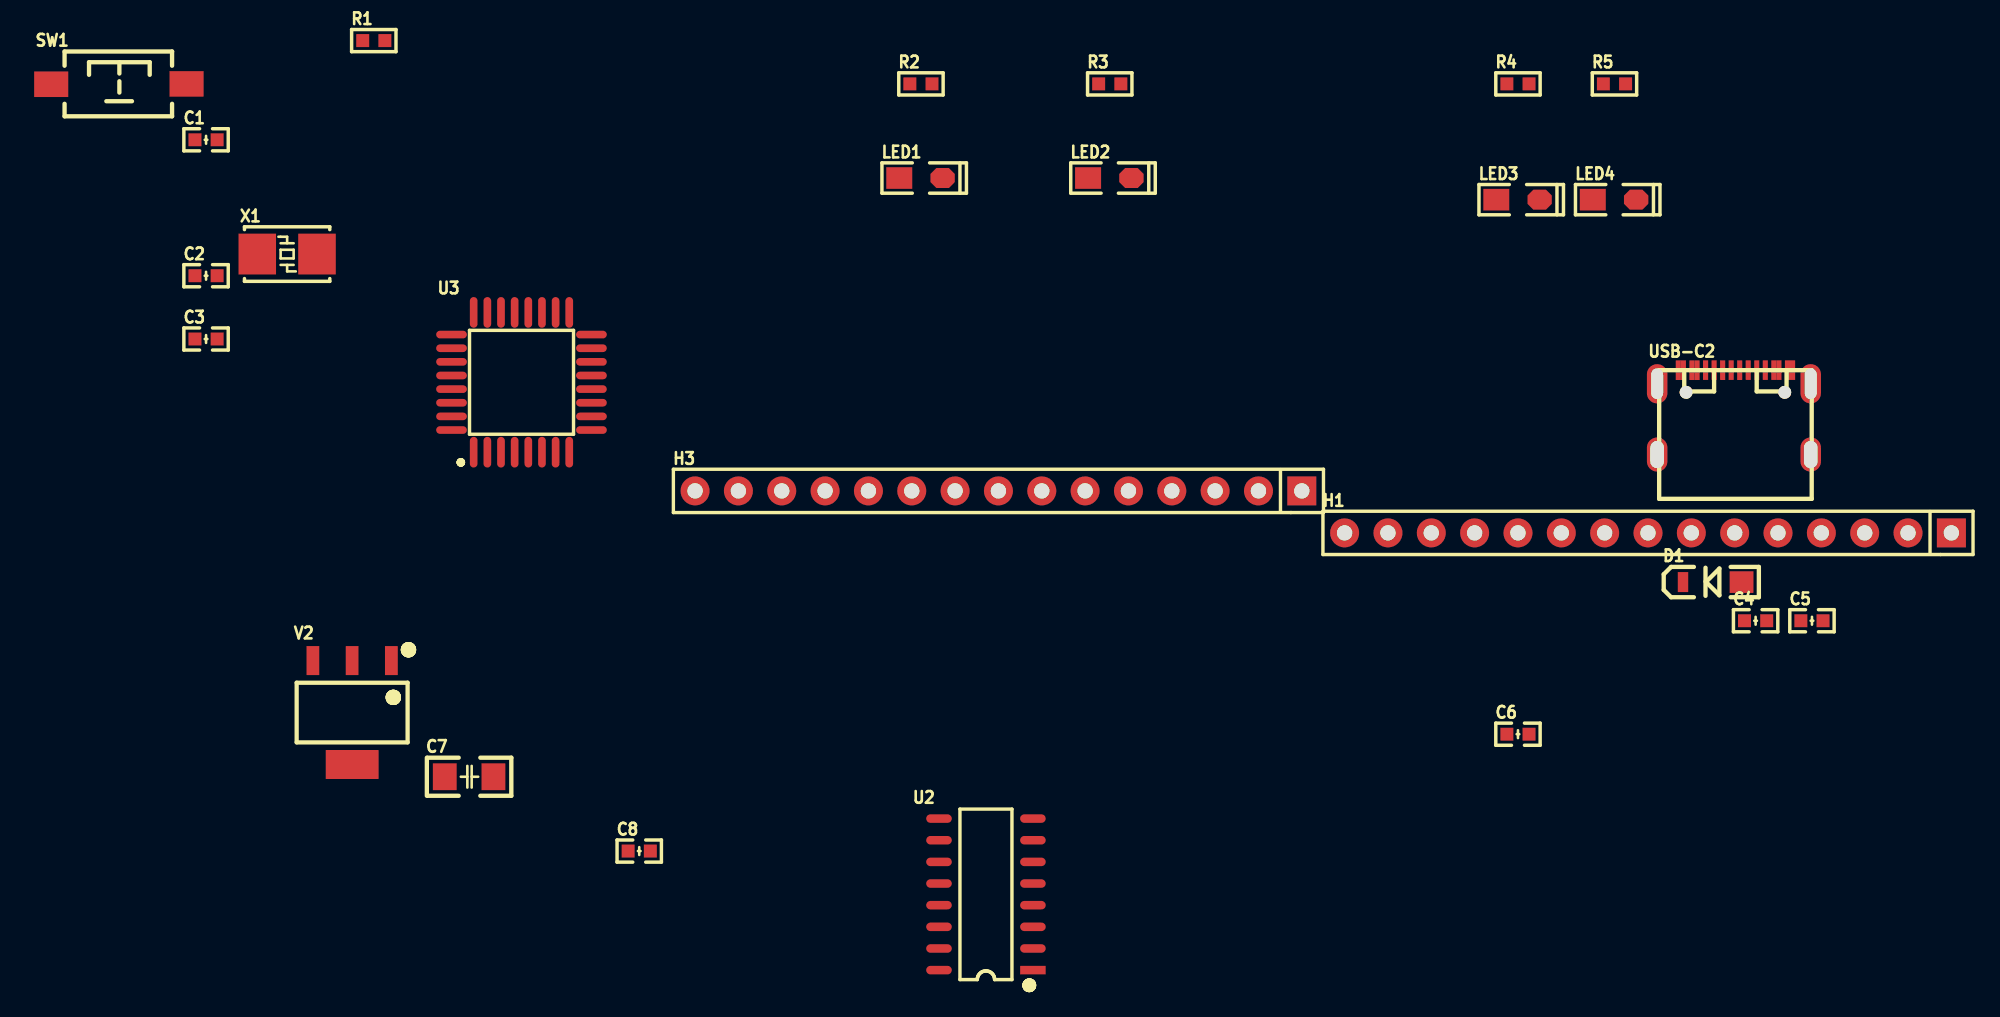
[diagram p16: board, top side]
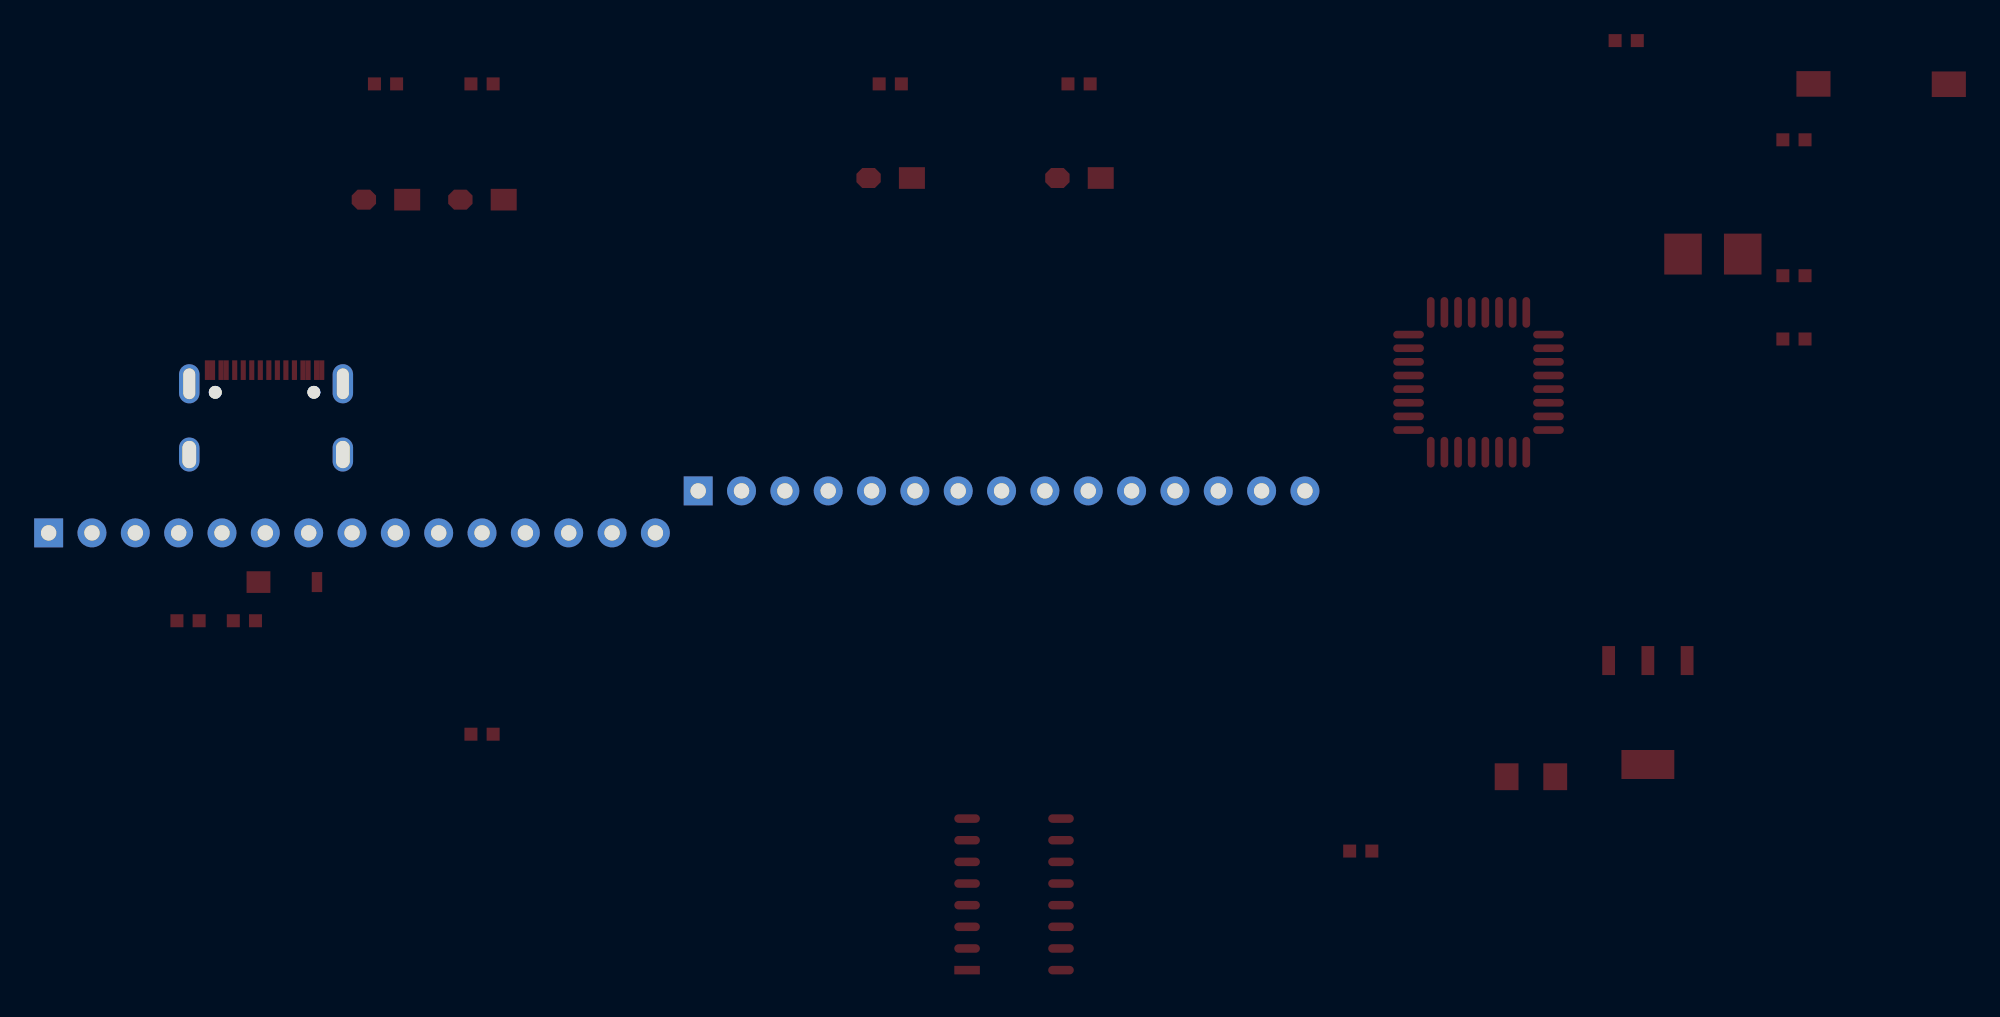
[diagram p17: board, bottom side, seen from below]

No outline. copper layers: Top Layer, Bottom Layer. Coordinates in mm from the lowest, leftmost part position.
Stack: Top Layer 0.035mm / Dielectric1 1.51mm FR4 er 4.5 / Bottom Layer 0.035mm

## Design rules (mm)
template: JLCPCB Capability(Two Layers Board)
spacing copperThickness1oz (default): track to track 0.102, other pairs 0.152 to 0.3
spacing copperThickness2oz: track to track 0.203, other pairs 0.152 to 0.3
track width copperThickness1oz (default): min 0.127, default 0.254, max 2.54
track width copperThickness2oz: min 0.203, default 0.254, max 2.54
differential pair differentialPair (default): width min 0.127, default 0.254, max 2.54; gap min 0.152, default 0.152
via viaSize (default): diameter min 0.5, default 0.61, max 10; hole min 0.3, default 0.305, max 6.3

## Placement (name value [footprint] x y rotation side)
C1  22pF  [C 0603_L]  5.08 44.26 0 top
C2  22pF  [C 0603_L]  5.08 36.29 0 top
C3  100nF  [C 0603_L]  5.08 32.58 0 top
C4  0.1uF  [C 0603_L]  95.89 16.05 0 top
C5  4.7uF  [C 0603_L]  99.2 16.05 0 top
C6  100nF  [C 0603_L]  81.97 9.4 0 top
C7  10uF  [C 1206_L]  20.52 6.9 0 top
C8  100nF  [C 0603_L]  30.47 2.54 0 top
D1  SS26  [SOD-123]  93.35 18.32 0 top
H1  HEADER 1X15  [HDR2.54-LI-15P]  89.59 21.2 0 top
H3  HEADER 1X15  [HDR2.54-LI-15P]  51.52 23.67 0 top
LED1  LED-RED  [LED 0805]  46.98 42.02 0 top
LED2  LED-RED  [LED 0805]  58.04 42.02 0 top
LED3  LED-BLUE  [LED 0805B]  81.97 40.75 0 top
LED4  LED-YELLOW  [LED 0805Y]  87.62 40.75 0 top
R1  1K  [R 0603_L#2]  14.91 50.08 0 top
R2  1K  [R 0603_L]  46.98 47.54 0 top
R3  1K  [R 0603_L]  58.04 47.54 0 top
R4  1K  [R 0603_L]  81.97 47.54 0 top
R5  1K  [R 0603_L]  87.62 47.54 0 top
SW1  3x6x5  [TSW SMD-3*6*2.5]  0 47.54 0 top
U2  CH340C  [SOP16_L]  50.79 0 0 top
U3  MEGA328P  [TQFP32-7*7]  23.57 30.04 0 top
USB-C2  USB-C  [TYPE-C-USB-5]  94.62 28.28 0 top
V2  -  [AMS1117]  13.64 10.67 0 top
X1  16MHz  [OSC 5032-2P]  9.83 37.56 0 top

## Footprints (pads in the part's own frame, mm; a bottom-side part is the same pattern mirrored in y, then rotated)
AMS1117
  rect 0.75x1.7 smd: 1(2.3,3.048) 2(0,3.048) 3(-2.3,3.048)
  rect 3.1x1.7 smd: 4(0,-3.048)
C 0603_L
  rect 0.762x0.762 smd: 1(0.65,0) 2(-0.65,0)
C 1206_L
  rect 1.397x1.575 smd: 1(1.4,0) 2(-1.45,0)
HDR2.54-LI-15P
  rect 1.7x1.7 hole 0.9: 1(17.78,0)
  round 1.7 hole 0.9: 2(15.24,0) 3(12.7,0) 4(10.16,0) 5(7.62,0) 6(5.08,0) 7(2.54,0) 8(0,0) 9(-2.54,0) 10(-5.08,0) 11(-7.62,0) 12(-10.16,0) 13(-12.7,0) 14(-15.24,0) 15(-17.78,0)
LED 0805
  rect 1.524x1.27 smd: 1(-1.27,0)
  custom 1.427x1.173 smd: 2(1.27,0)
LED 0805B
  rect 1.524x1.27 smd: 1(-1.27,0)
  custom 1.427x1.173 smd: 2(1.27,0)
LED 0805Y
  rect 1.524x1.27 smd: 1(-1.27,0)
  custom 1.427x1.173 smd: 2(1.27,0)
OSC 5032-2P
  rect 2.2x2.4 smd: 1(1.75,0) 2(-1.75,0)
R 0603_L
  rect 0.762x0.762 smd: 1(-0.65,0) 2(0.65,0)
R 0603_L#2
  rect 0.762x0.762 smd: 1(0.65,0) 2(-0.65,0)
SOD-123
  rect 1.397x1.27 smd: 1(1.714,0)
  custom 0.613x1.173 smd: 2(-1.714,0)
SOP16_L
  rect 1.5x0.5 smd: 1(2.752,-4.445)
  oval 1.5x0.5 smd: 2(2.752,-3.175) 3(2.752,-1.905) 4(2.752,-0.635) 5(2.752,0.635) 6(2.752,1.905) 7(2.752,3.175) 8(2.752,4.445) 9(-2.752,4.445) 10(-2.752,3.175) 11(-2.752,1.905) 12(-2.752,0.635) 13(-2.752,-0.635) 14(-2.752,-1.905) 15(-2.752,-3.175) 16(-2.752,-4.445)
TQFP32-7*7
  oval 0.45x1.8 smd: 1(-2.803,-4.1) 2(-2.002,-4.1) 3(-1.202,-4.1) 4(-0.403,-4.1) 5(0.398,-4.1) 6(1.198,-4.1) 7(1.998,-4.1) 8(2.797,-4.1) 17(2.797,4.1) 18(1.998,4.1) 19(1.198,4.1) 20(0.398,4.1) 21(-0.403,4.1) 22(-1.202,4.1) 23(-2.002,4.1) 24(-2.803,4.1)
  oval 1.8x0.45 smd: 9(4.098,-2.8) 10(4.098,-2) 11(4.098,-1.2) 12(4.098,-0.4) 13(4.098,0.4) 14(4.098,1.2) 15(4.098,2) 16(4.098,2.8) 25(-4.103,2.8) 26(-4.103,2) 27(-4.103,1.2) 28(-4.103,0.4) 29(-4.103,-0.4) 30(-4.103,-1.2) 31(-4.103,-2) 32(-4.103,-2.8)
TSW SMD-3*6*2.5
  rect 2x1.5 smd: 1(-3.996,-0.02) 2(3.937,0)
TYPE-C-USB-5
  oval 1.2x2 hole 0.8x1.6: 0(-4.5,-2.475) 2(4.5,-2.475)
  round 0.75 hole 0.75: 1(2.978,1.175) 5(-2.803,1.175)
  oval 1.2x2.3 hole 0.7x1.8: 3(4.5,1.675) 4(-4.5,1.675)
  rect 0.3x1.15 smd: A1(-3.263,2.474) A4(-2.462,2.471) A5(-1.163,2.475) A6(-0.163,2.475) A7(0.338,2.474) A8(1.337,2.475) A9(2.638,2.475) A12(3.438,2.475) B1(3.138,2.475) B4(2.337,2.475) B5(1.837,2.475) B6(0.838,2.475) B7(-0.662,2.474) B8(-1.663,2.475) B9(-2.163,2.471) B12(-2.962,2.474)

## Nets
As in the schematic.

Pads without a net: U2 7 8 9 10 11 12 14 15; USB-C2 0 1 2 3 4 5 A5 A8 B5 B8; V2 4
